# EAGLE schematic foxBMS_BMS-Master_Extension_V1.00 (EAGLE 6.5.0)
AUTHOR: Fraunhofer IISB foxBMS Team; REL-DATE: 2016-05-20; TITLE: foxBMS BMS-Master Extension; VERSION: 1.00

## Sheet 1 of 22: Overview
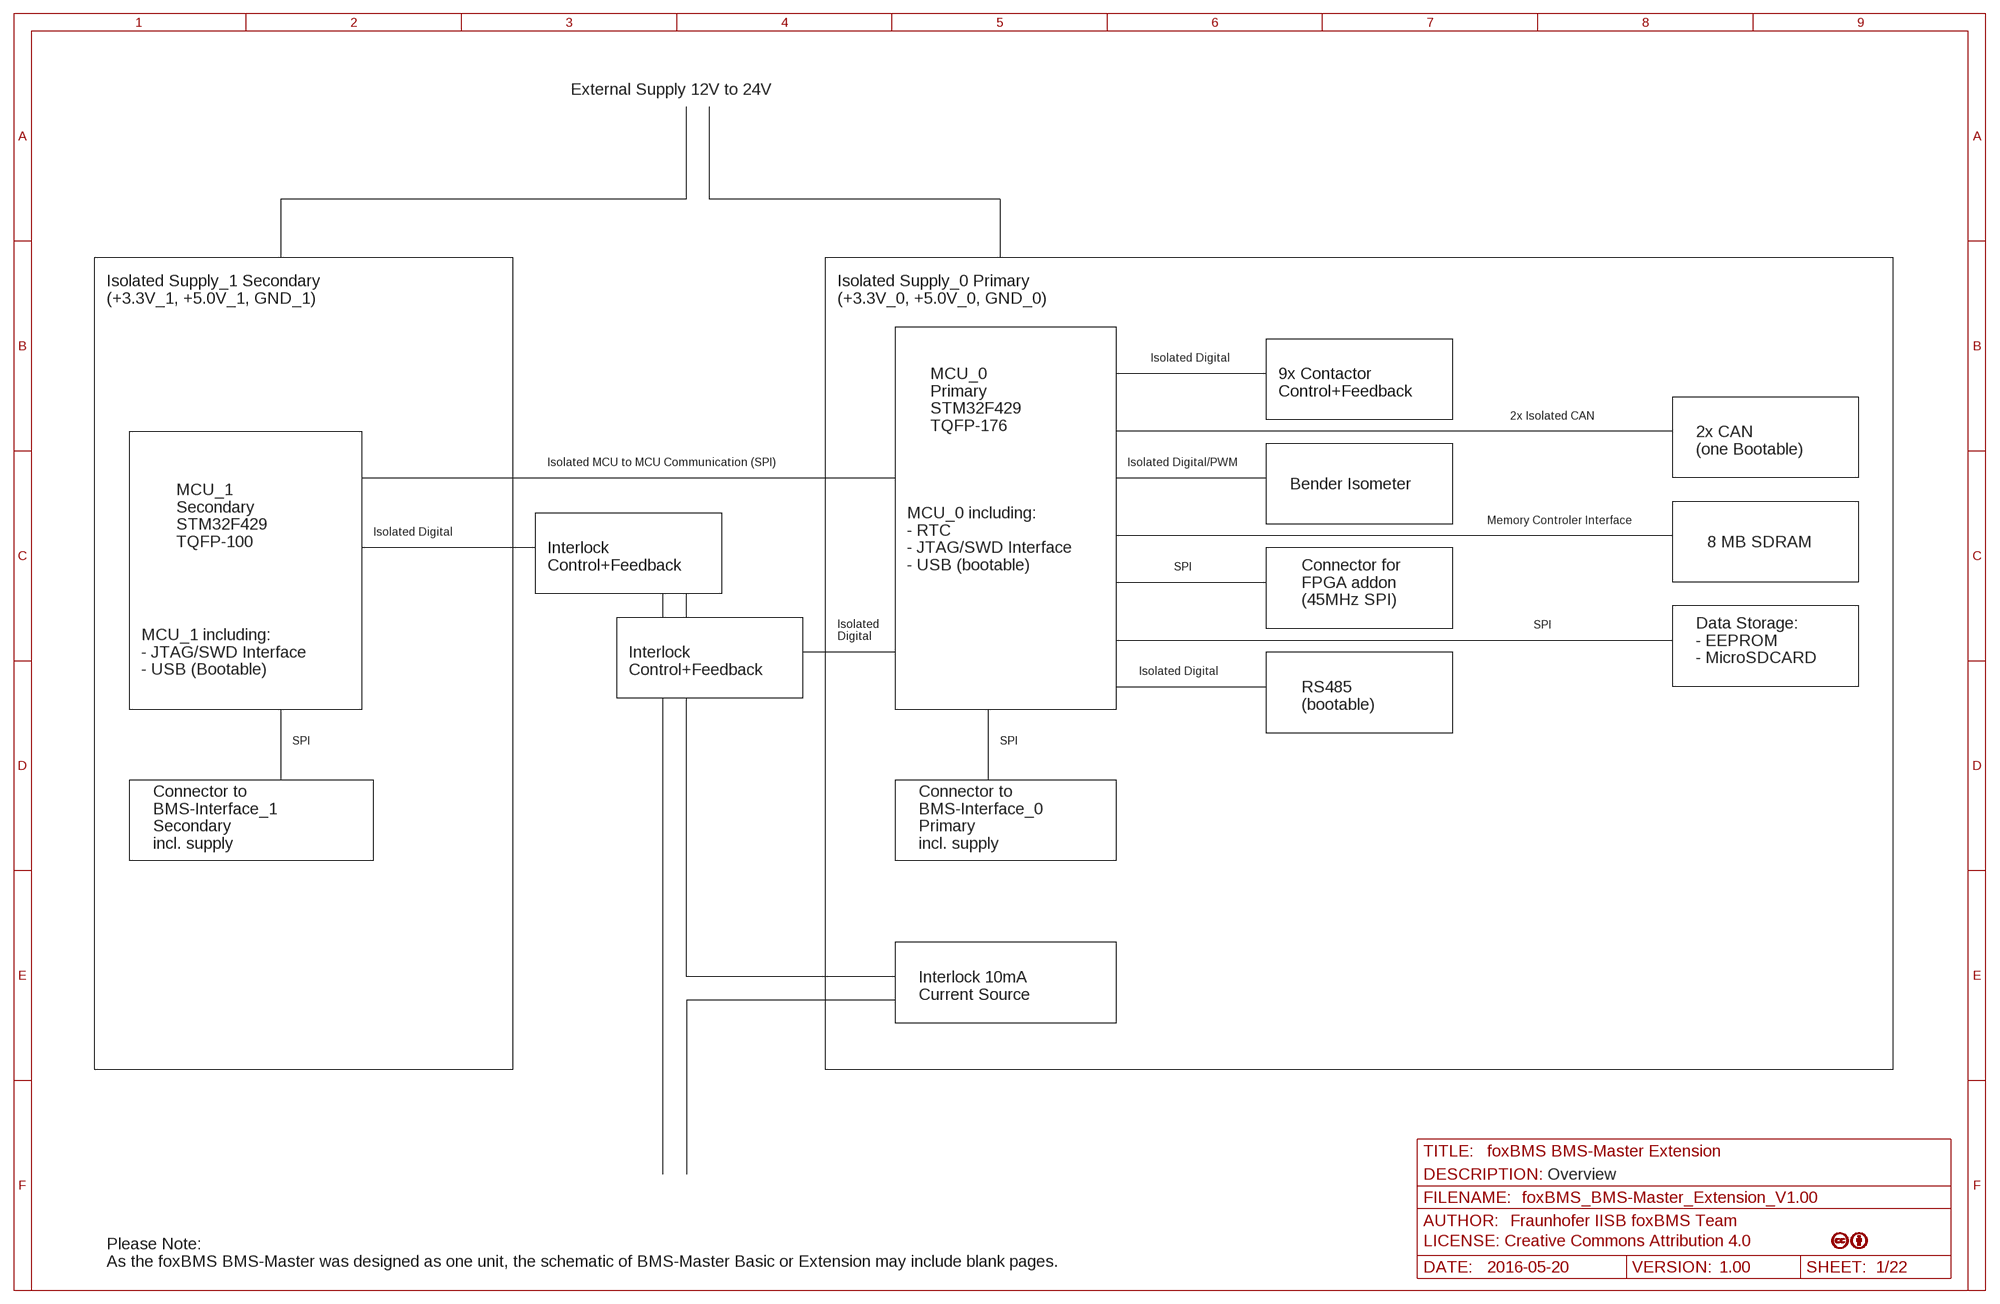
[diagram p0: schematic, sheet 1]

### Notes on the sheet
- External Supply 12V to 24V
- Isolated Supply_1 Secondary
  (+3.3V_1, +5.0V_1, GND_1)
- Isolated Supply_0 Primary
  (+3.3V_0, +5.0V_0, GND_0)
- Isolated Digital
- 9x Contactor
  Control+Feedback
- 2x Isolated CAN
- MCU_0
  Primary
  STM32F429 
  TQFP-176
- 2x CAN
  (one Bootable)
- Isolated MCU to MCU Communication (SPI) | Isolated Digital/PWM
- Bender Isometer
- Memory Controler Interface
- Isolated Digital
- MCU_1
  Secondary
  STM32F429 
  TQFP-100
- 8 MB SDRAM
- Interlock
  Control+Feedback
- MCU_0 including:
  - RTC
  - JTAG/SWD Interface
  - USB (bootable)
- SPI
- Connector for 
  FPGA addon
  (45MHz SPI)
- SPI
- Isolated 
  Digital
- Data Storage:
  - EEPROM
  - MicroSDCARD
- MCU_1 including:
  - JTAG/SWD Interface
  - USB (Bootable)
- Interlock
  Control+Feedback
- Isolated Digital
- RS485
  (bootable)
- SPI | SPI
- Connector to 
  BMS-Interface_1 
  Secondary
  incl. supply
- Connector to 
  BMS-Interface_0
  Primary
  incl. supply
- Interlock 10mA
  Current Source
- Overview
- Please Note: 
  As the foxBMS BMS-Master was designed as one unit, the schematic of BMS-Master Basic or Extension may include blank pages.

## Sheet 2 of 22: Supply_0 (Primary)
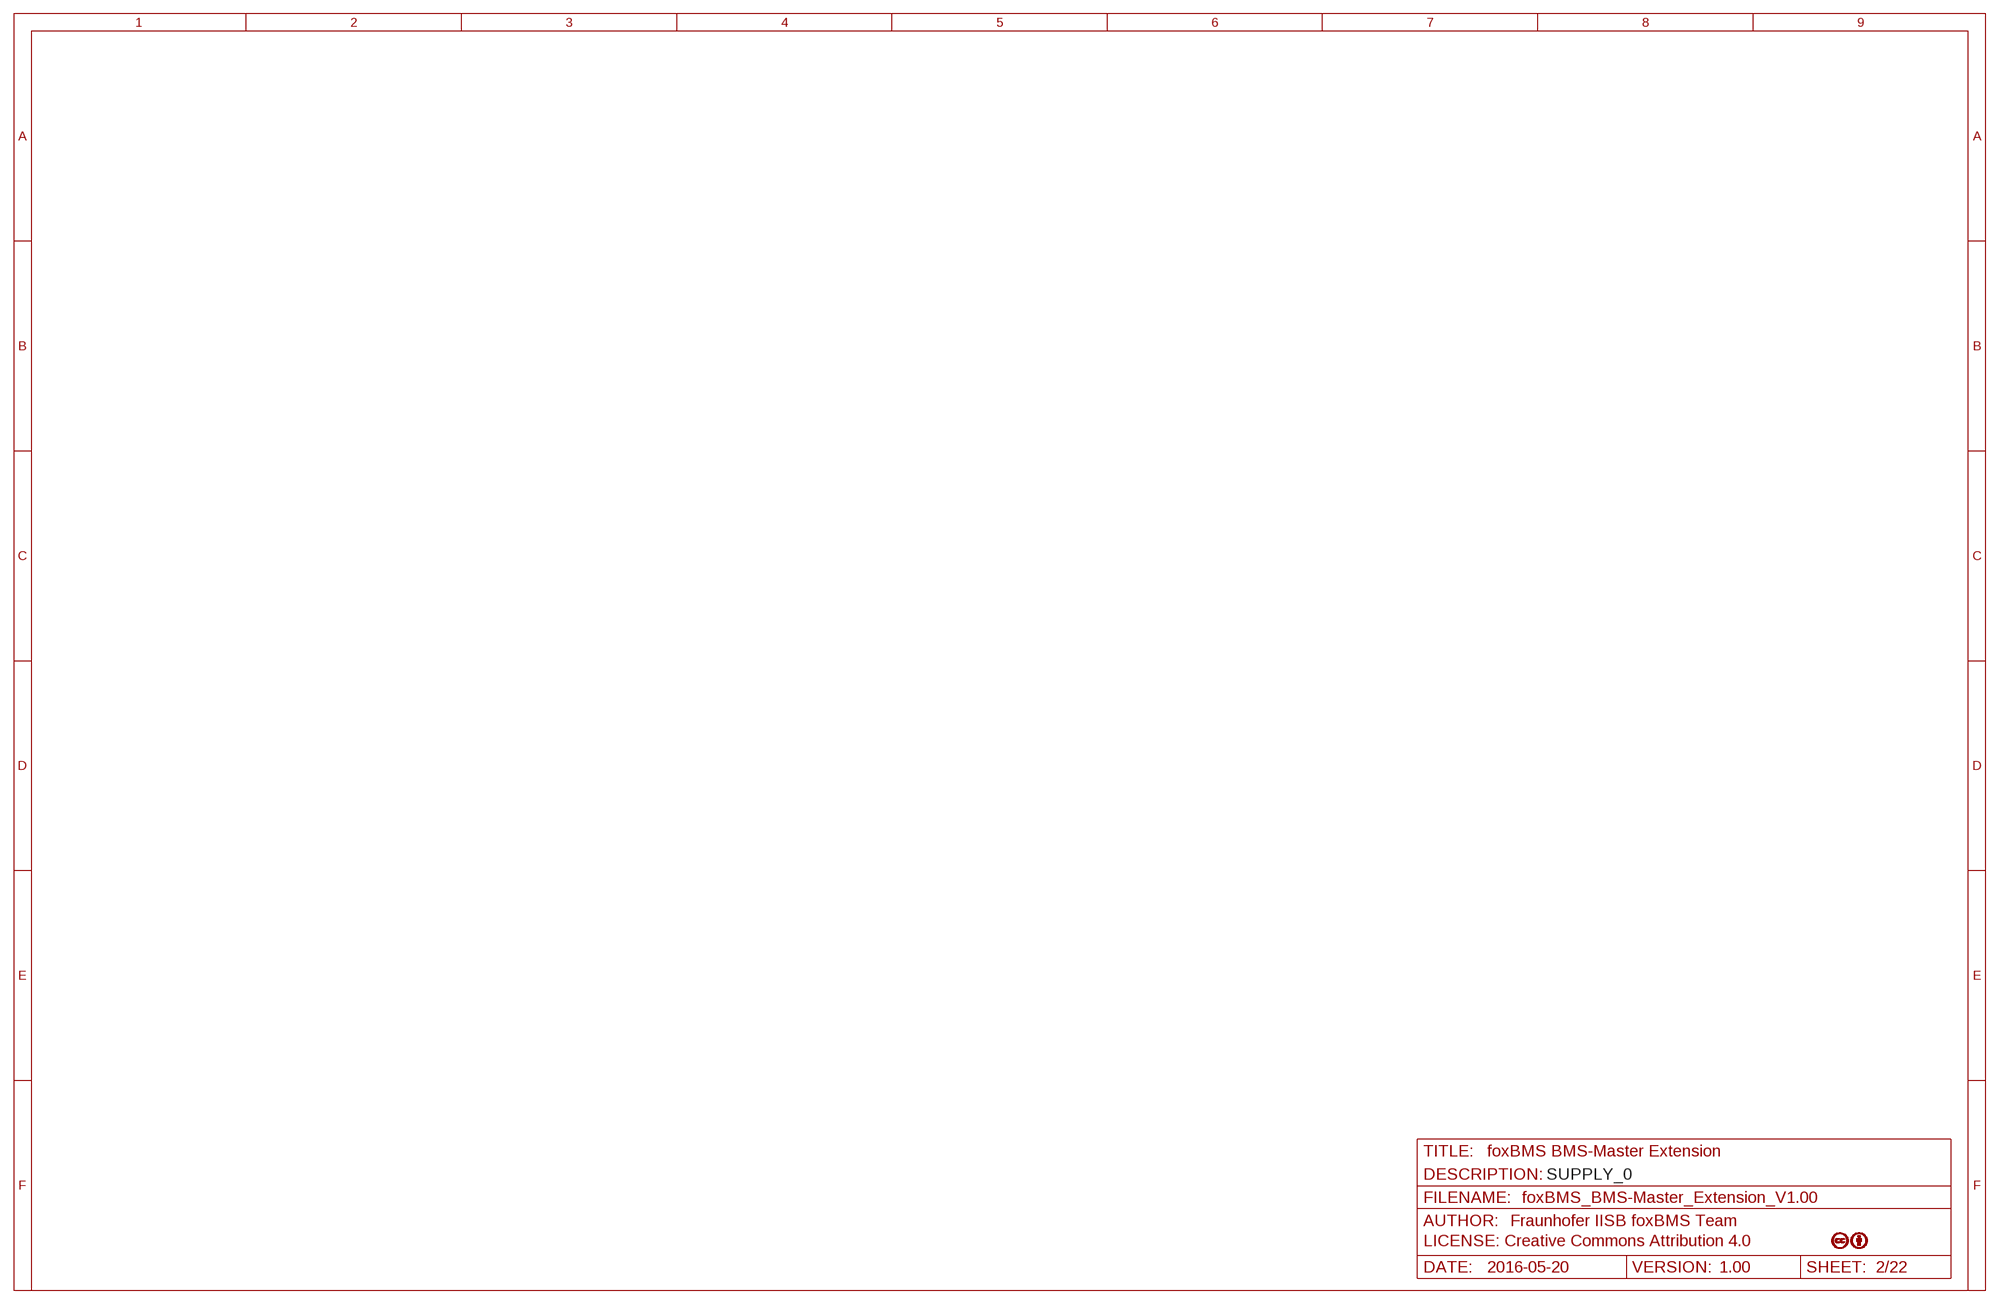
[diagram p1: schematic, sheet 2]

### Notes on the sheet
- SUPPLY_0

## Sheet 3 of 22: Supply_1 (Secondary)
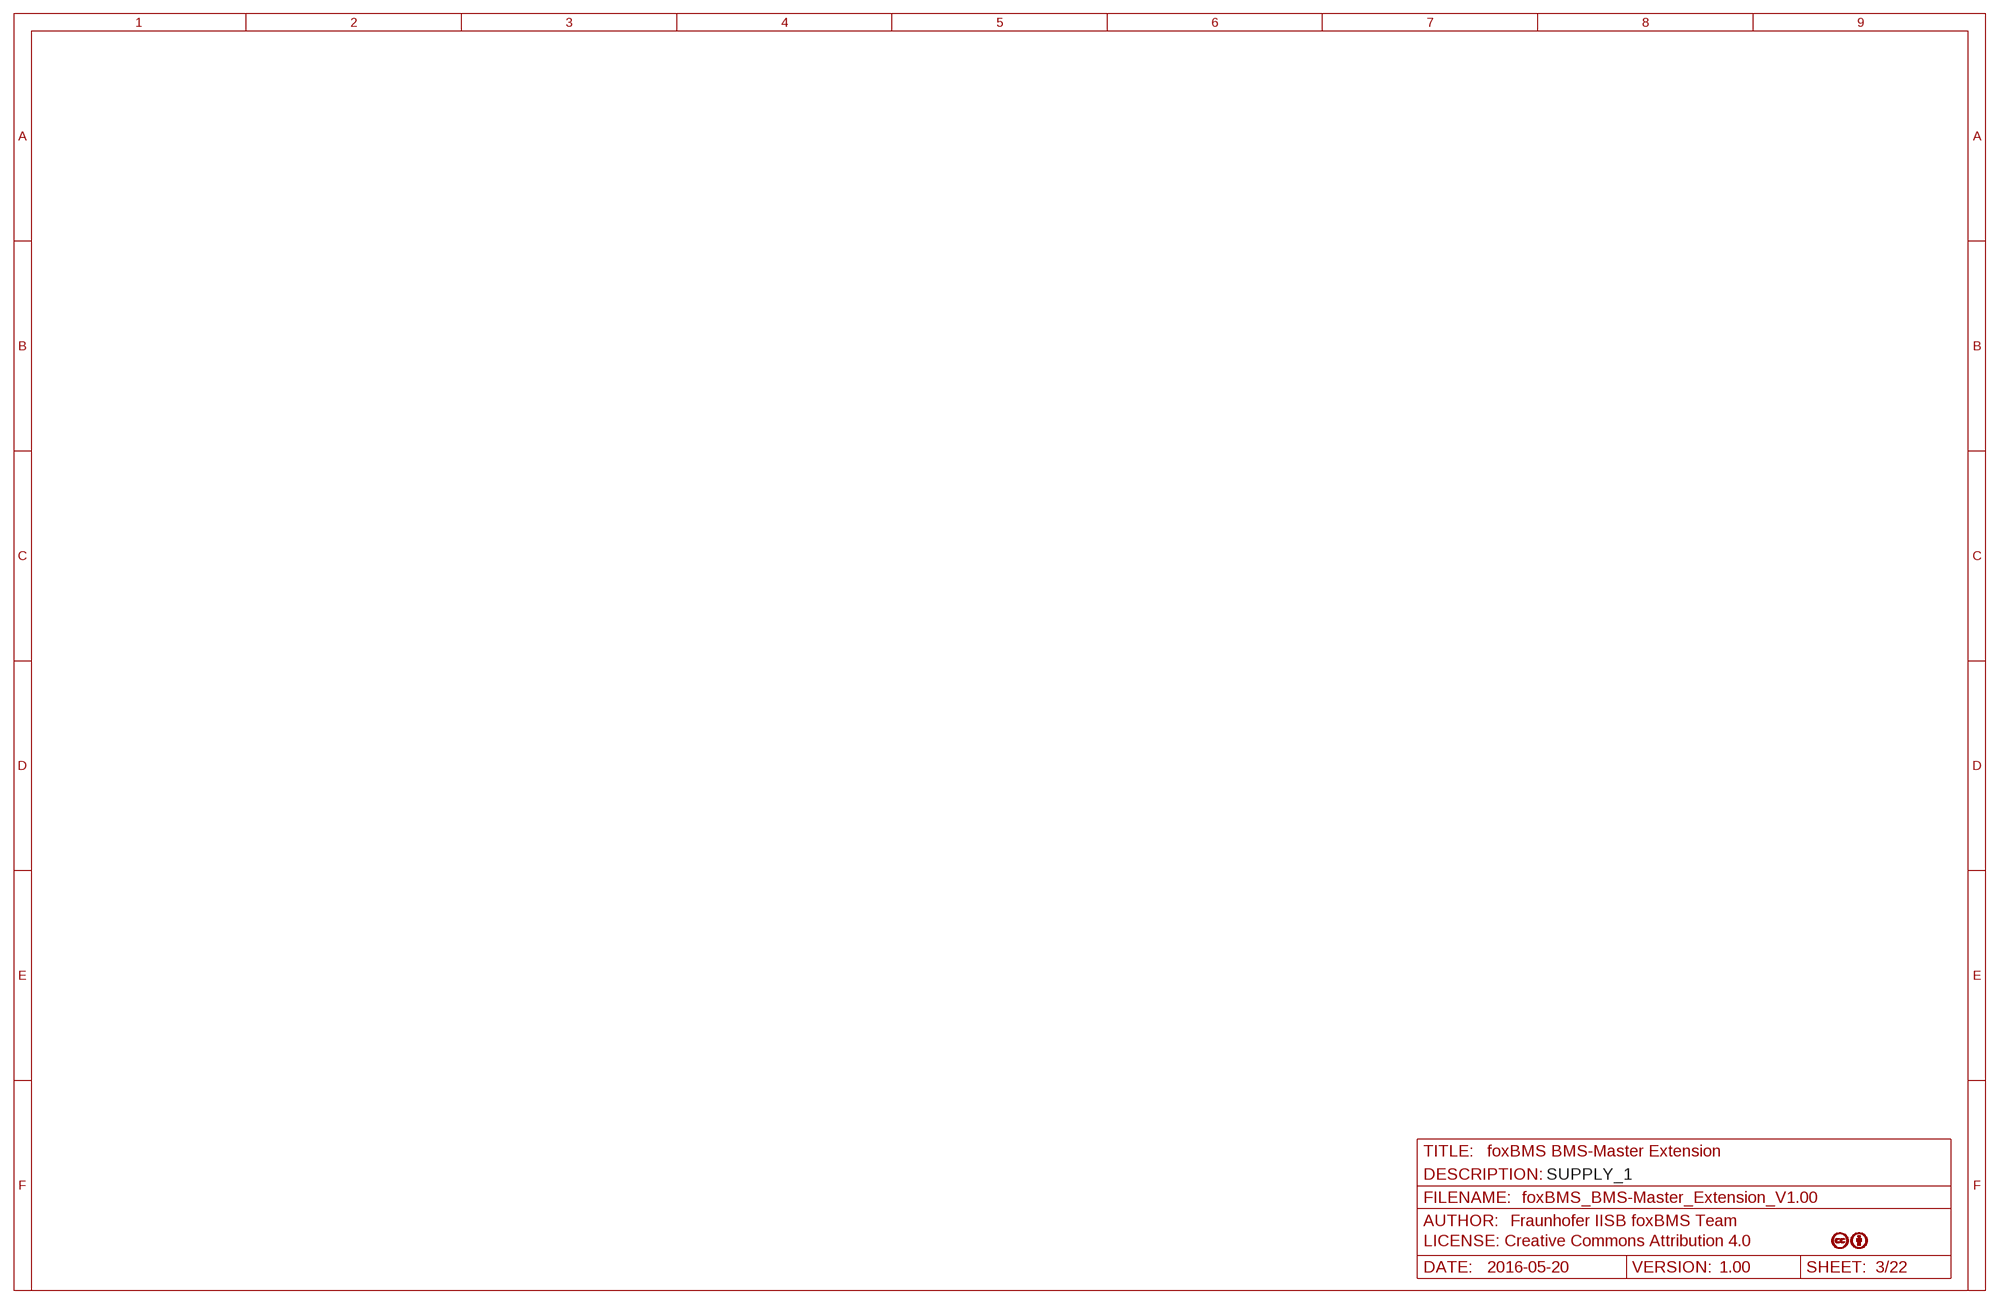
[diagram p2: schematic, sheet 3]

### Notes on the sheet
- SUPPLY_1

## Sheet 4 of 22: MCU_0 (Primary)
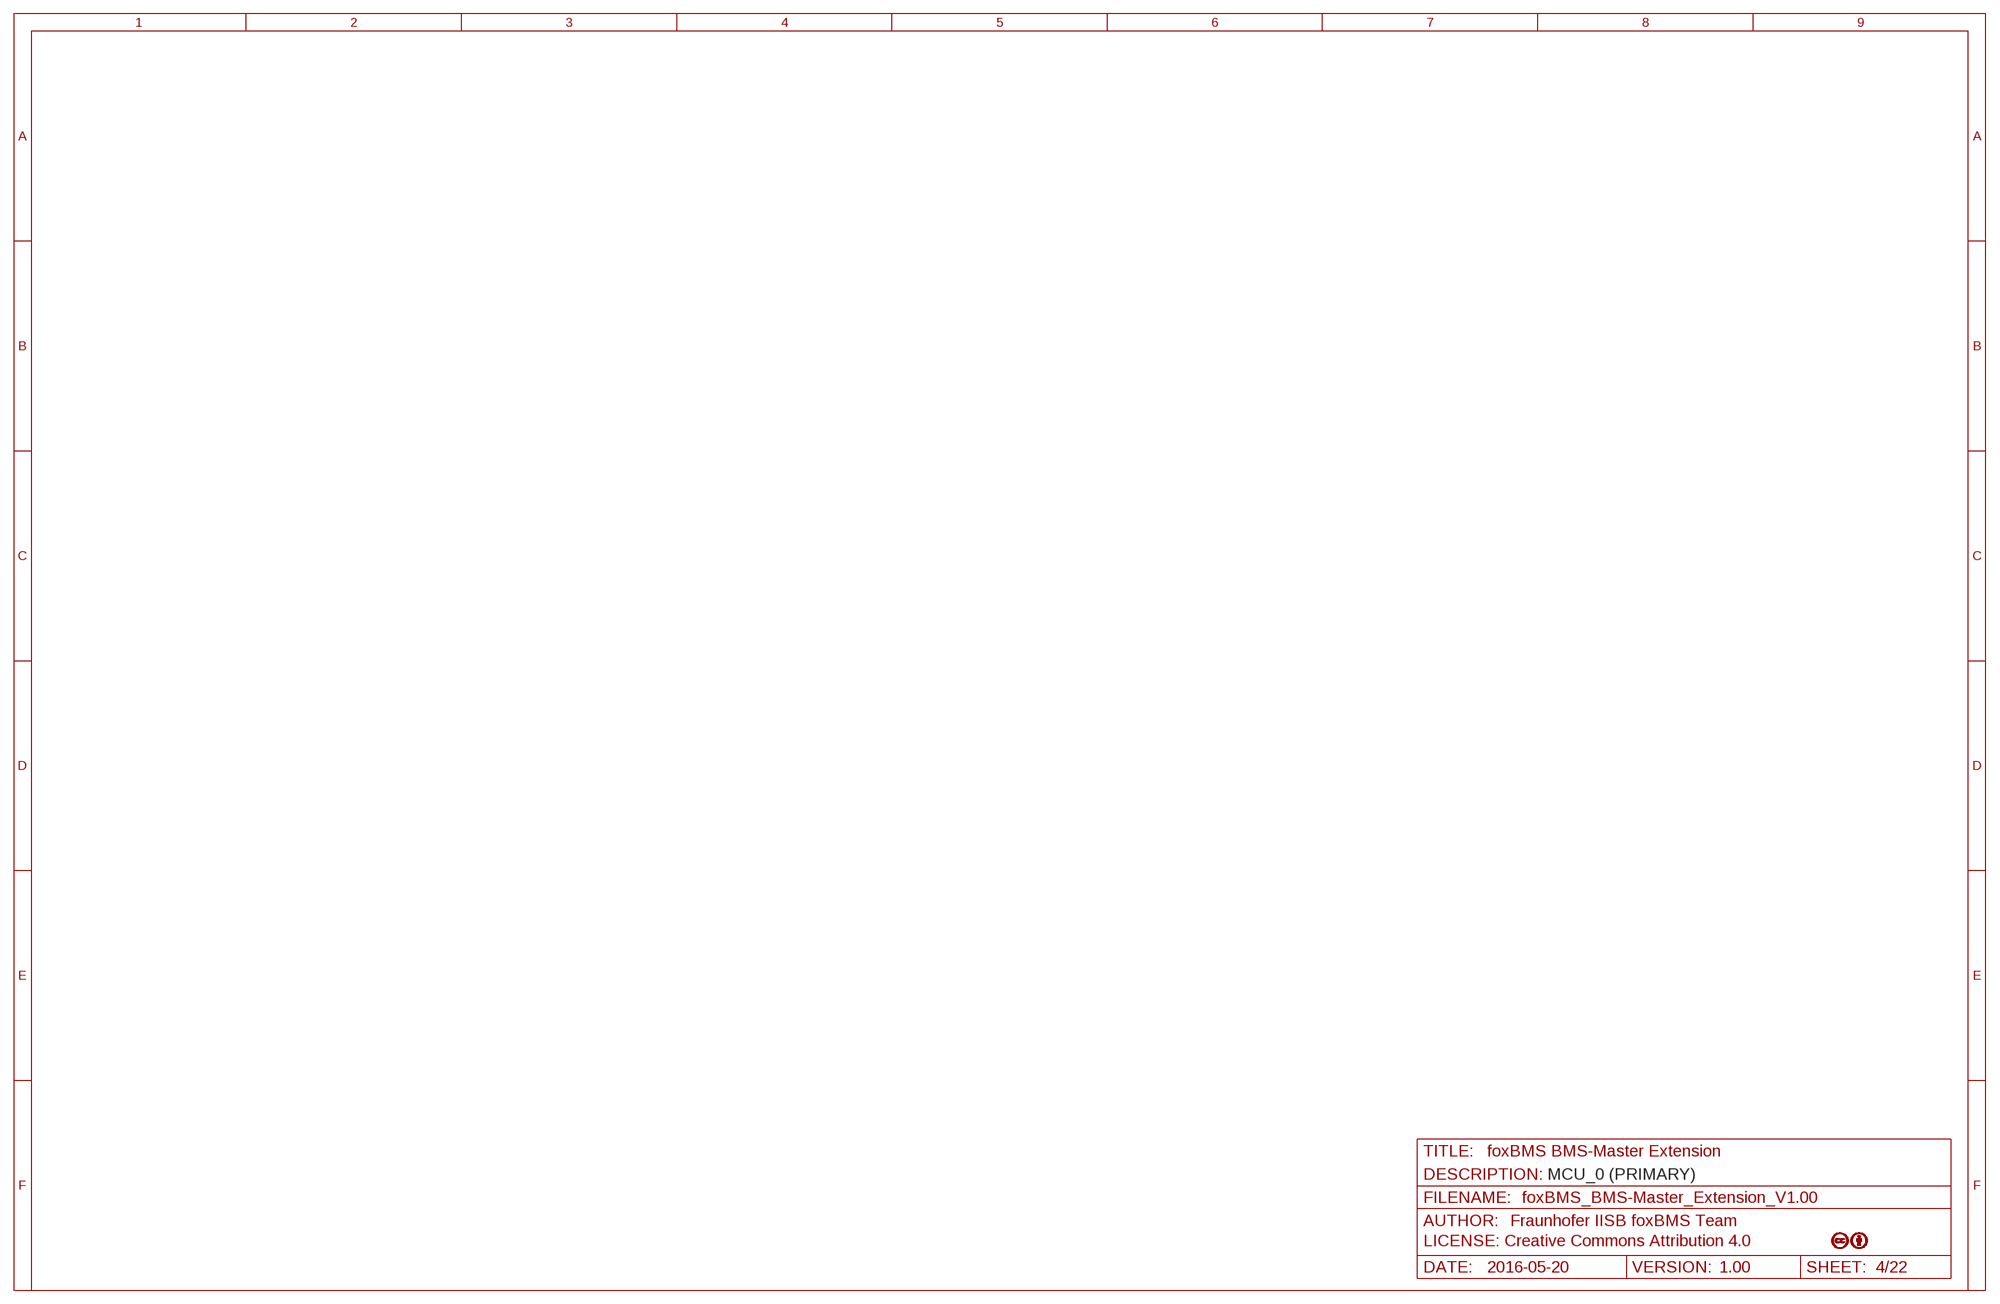
[diagram p3: schematic, sheet 4]

### Notes on the sheet
- MCU_0 (PRIMARY)

## Sheet 5 of 22: MCU_1 (Secondary)
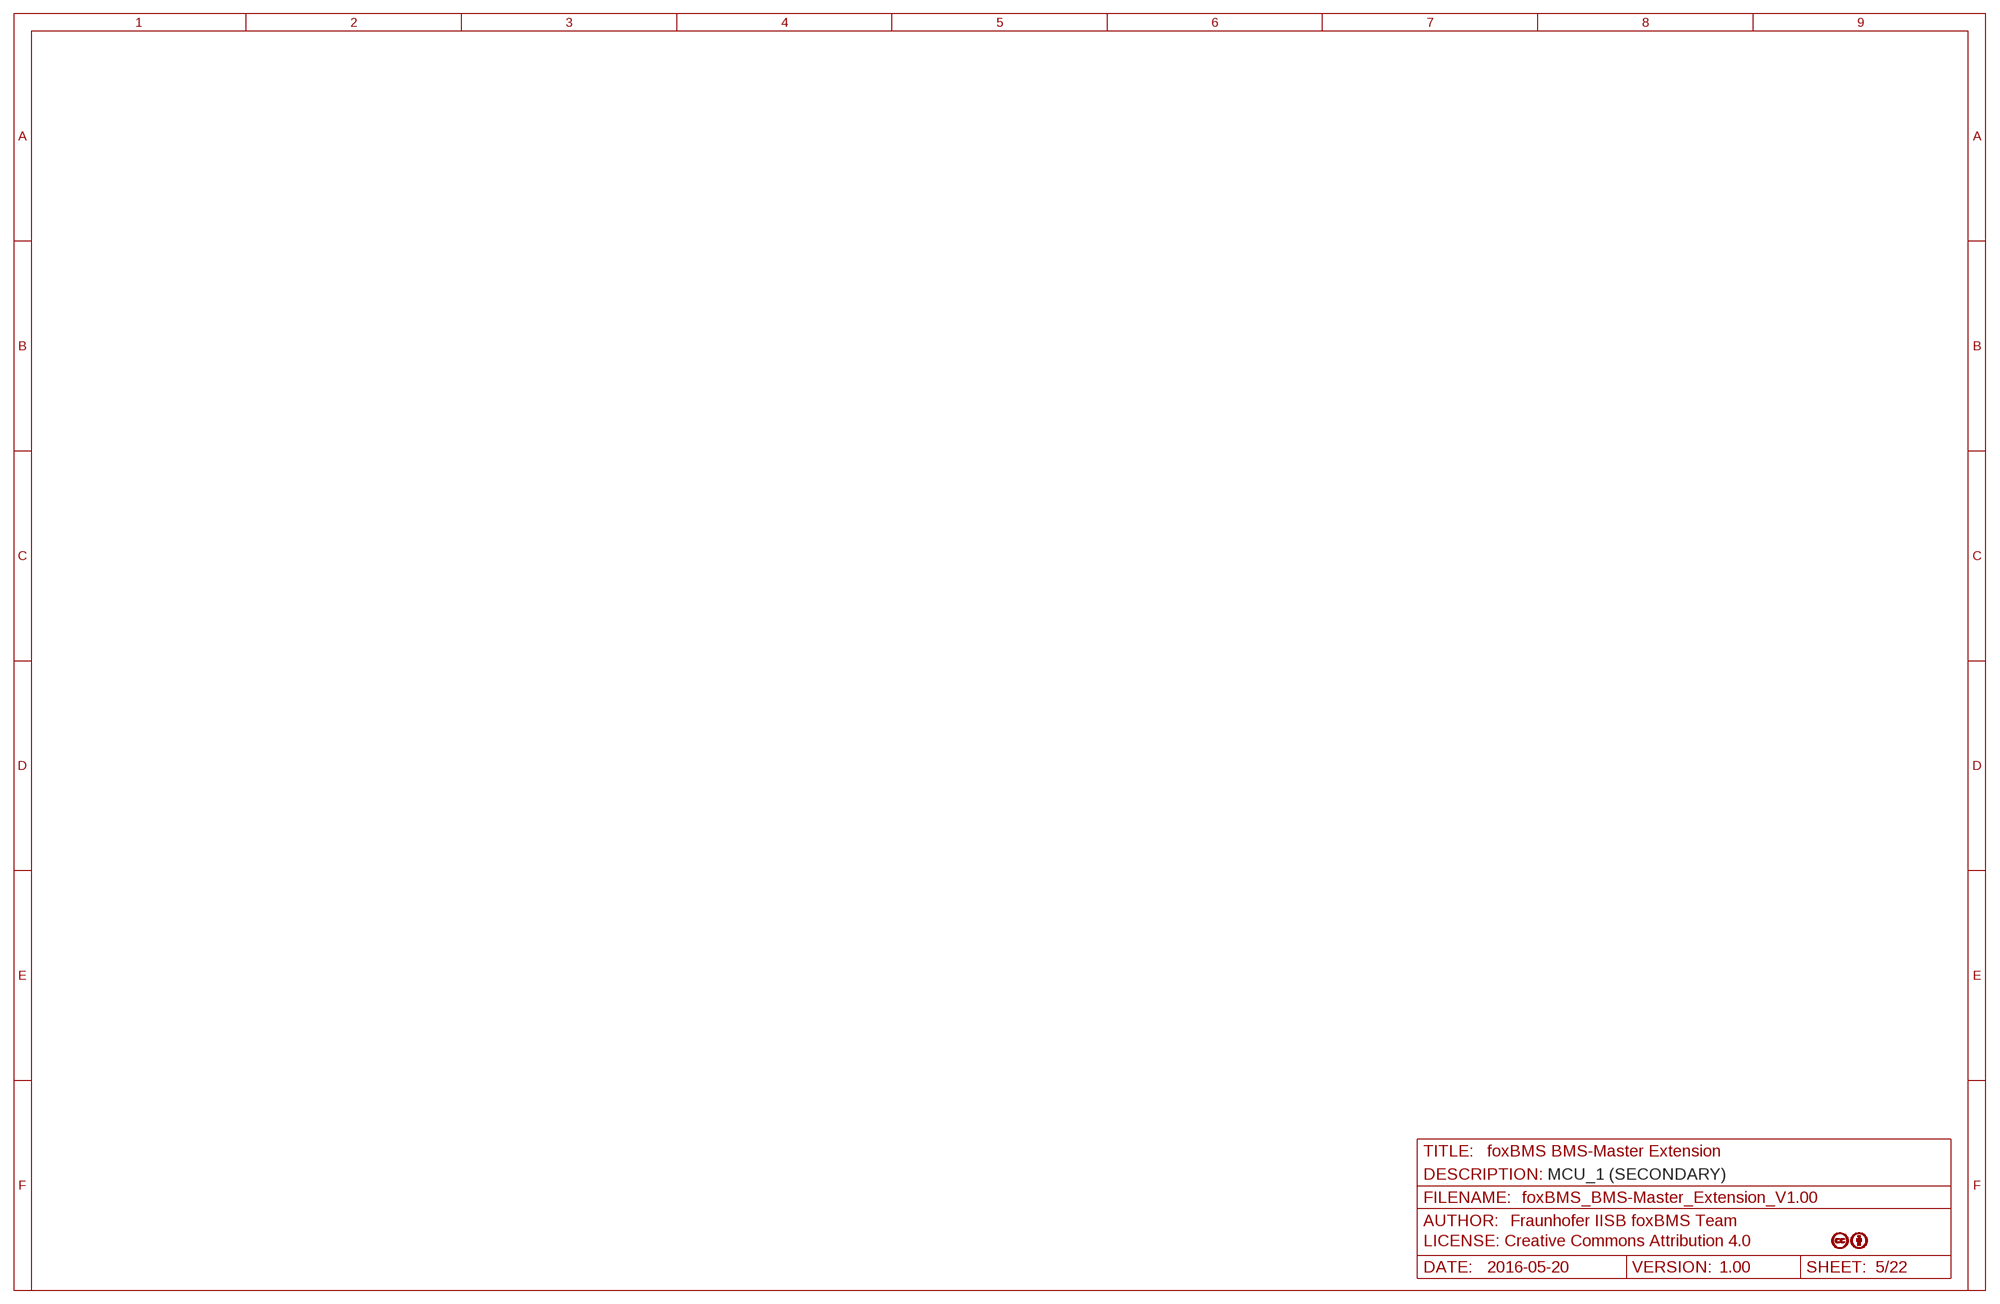
[diagram p4: schematic, sheet 5]

### Notes on the sheet
- MCU_1 (SECONDARY)

## Sheet 6 of 22: MCU to MCU Interface
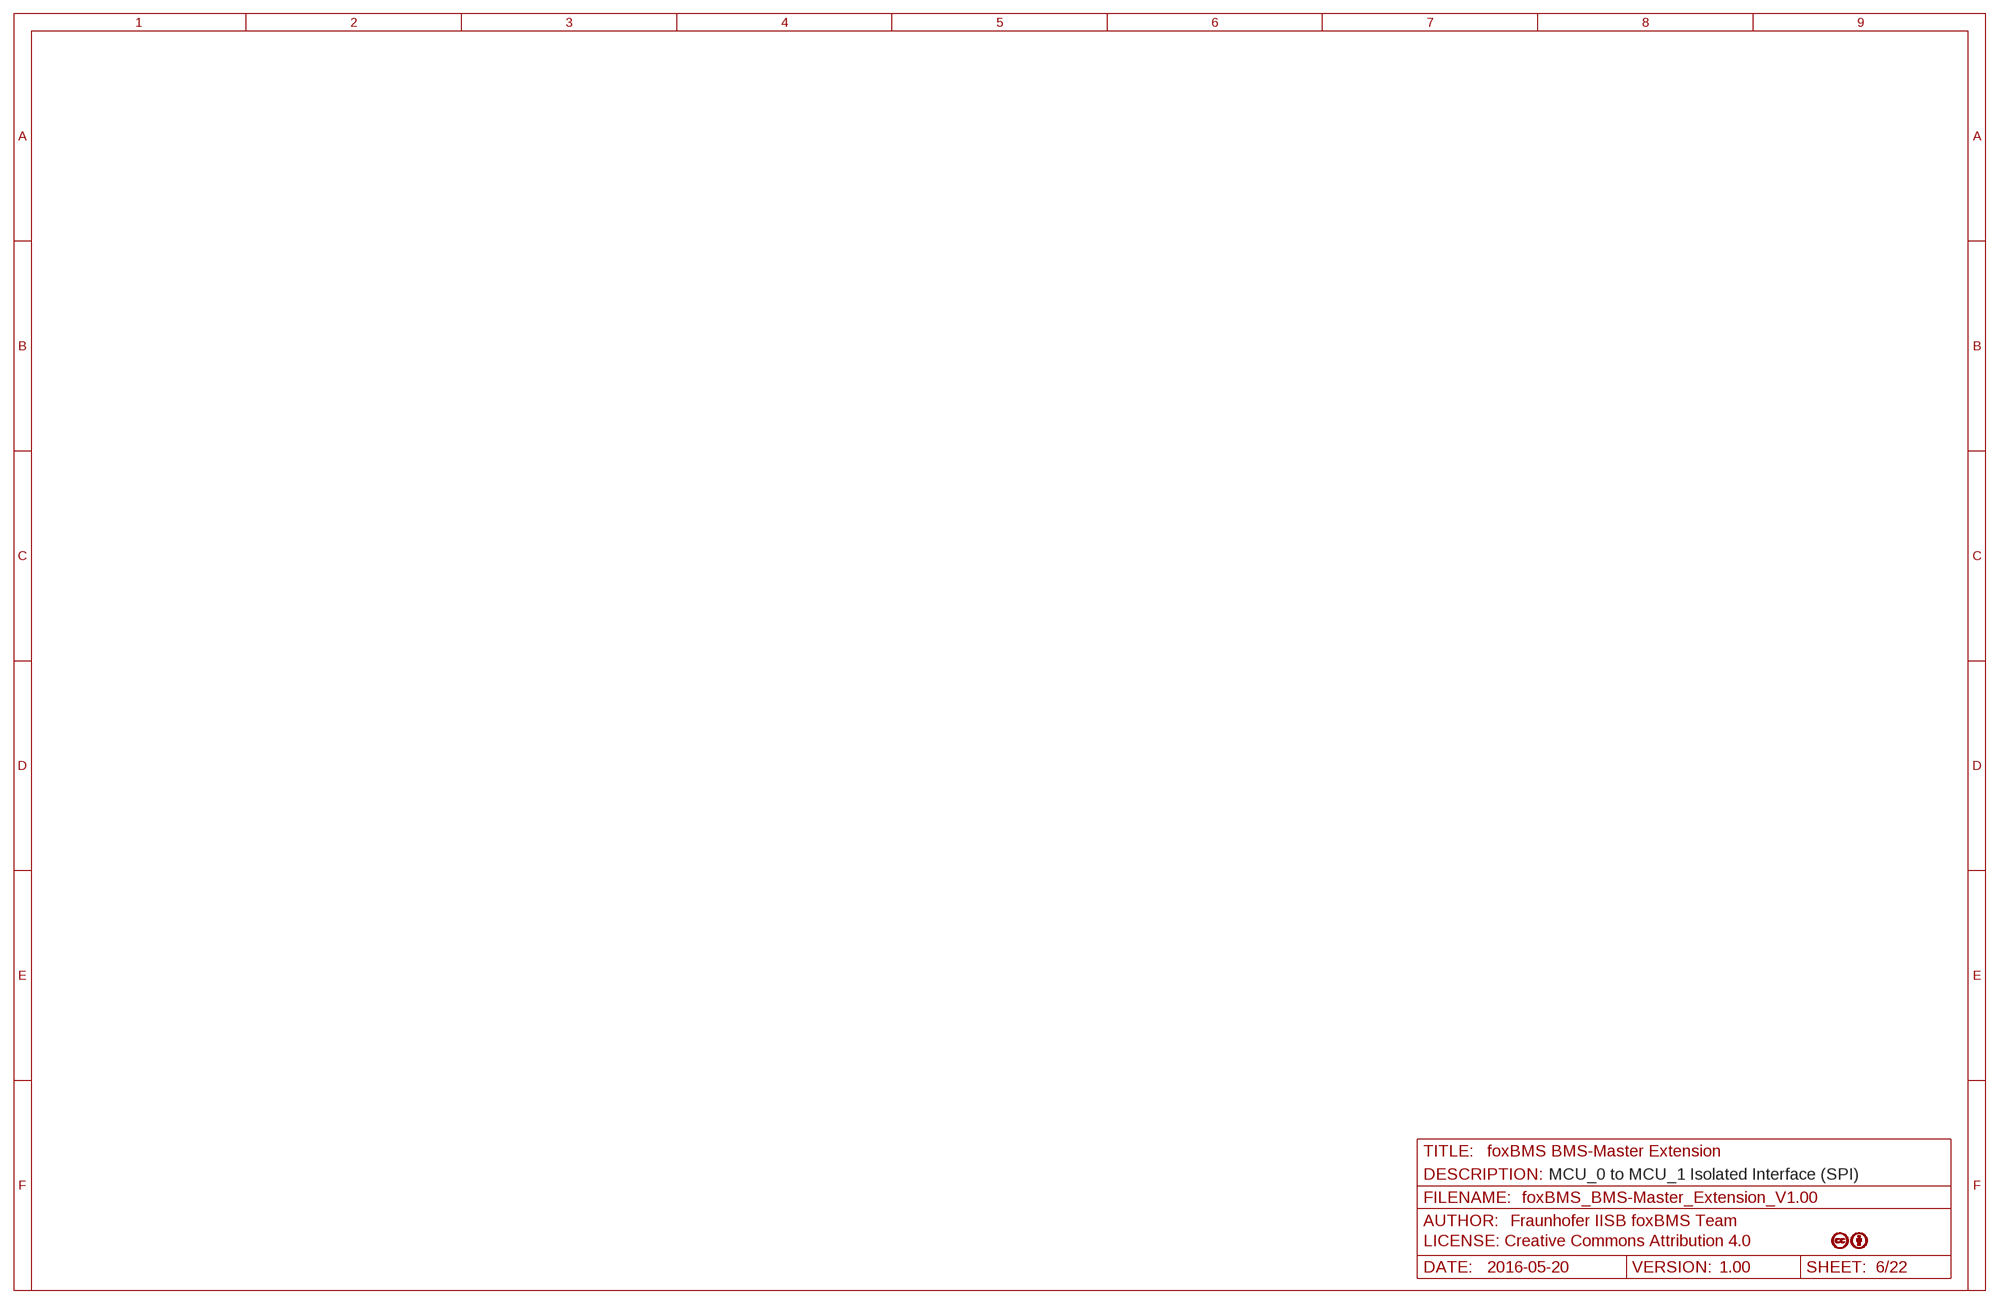
[diagram p5: schematic, sheet 6]

### Notes on the sheet
- MCU_0 to MCU_1 Isolated Interface (SPI)

## Sheet 7 of 22: Bender Interface
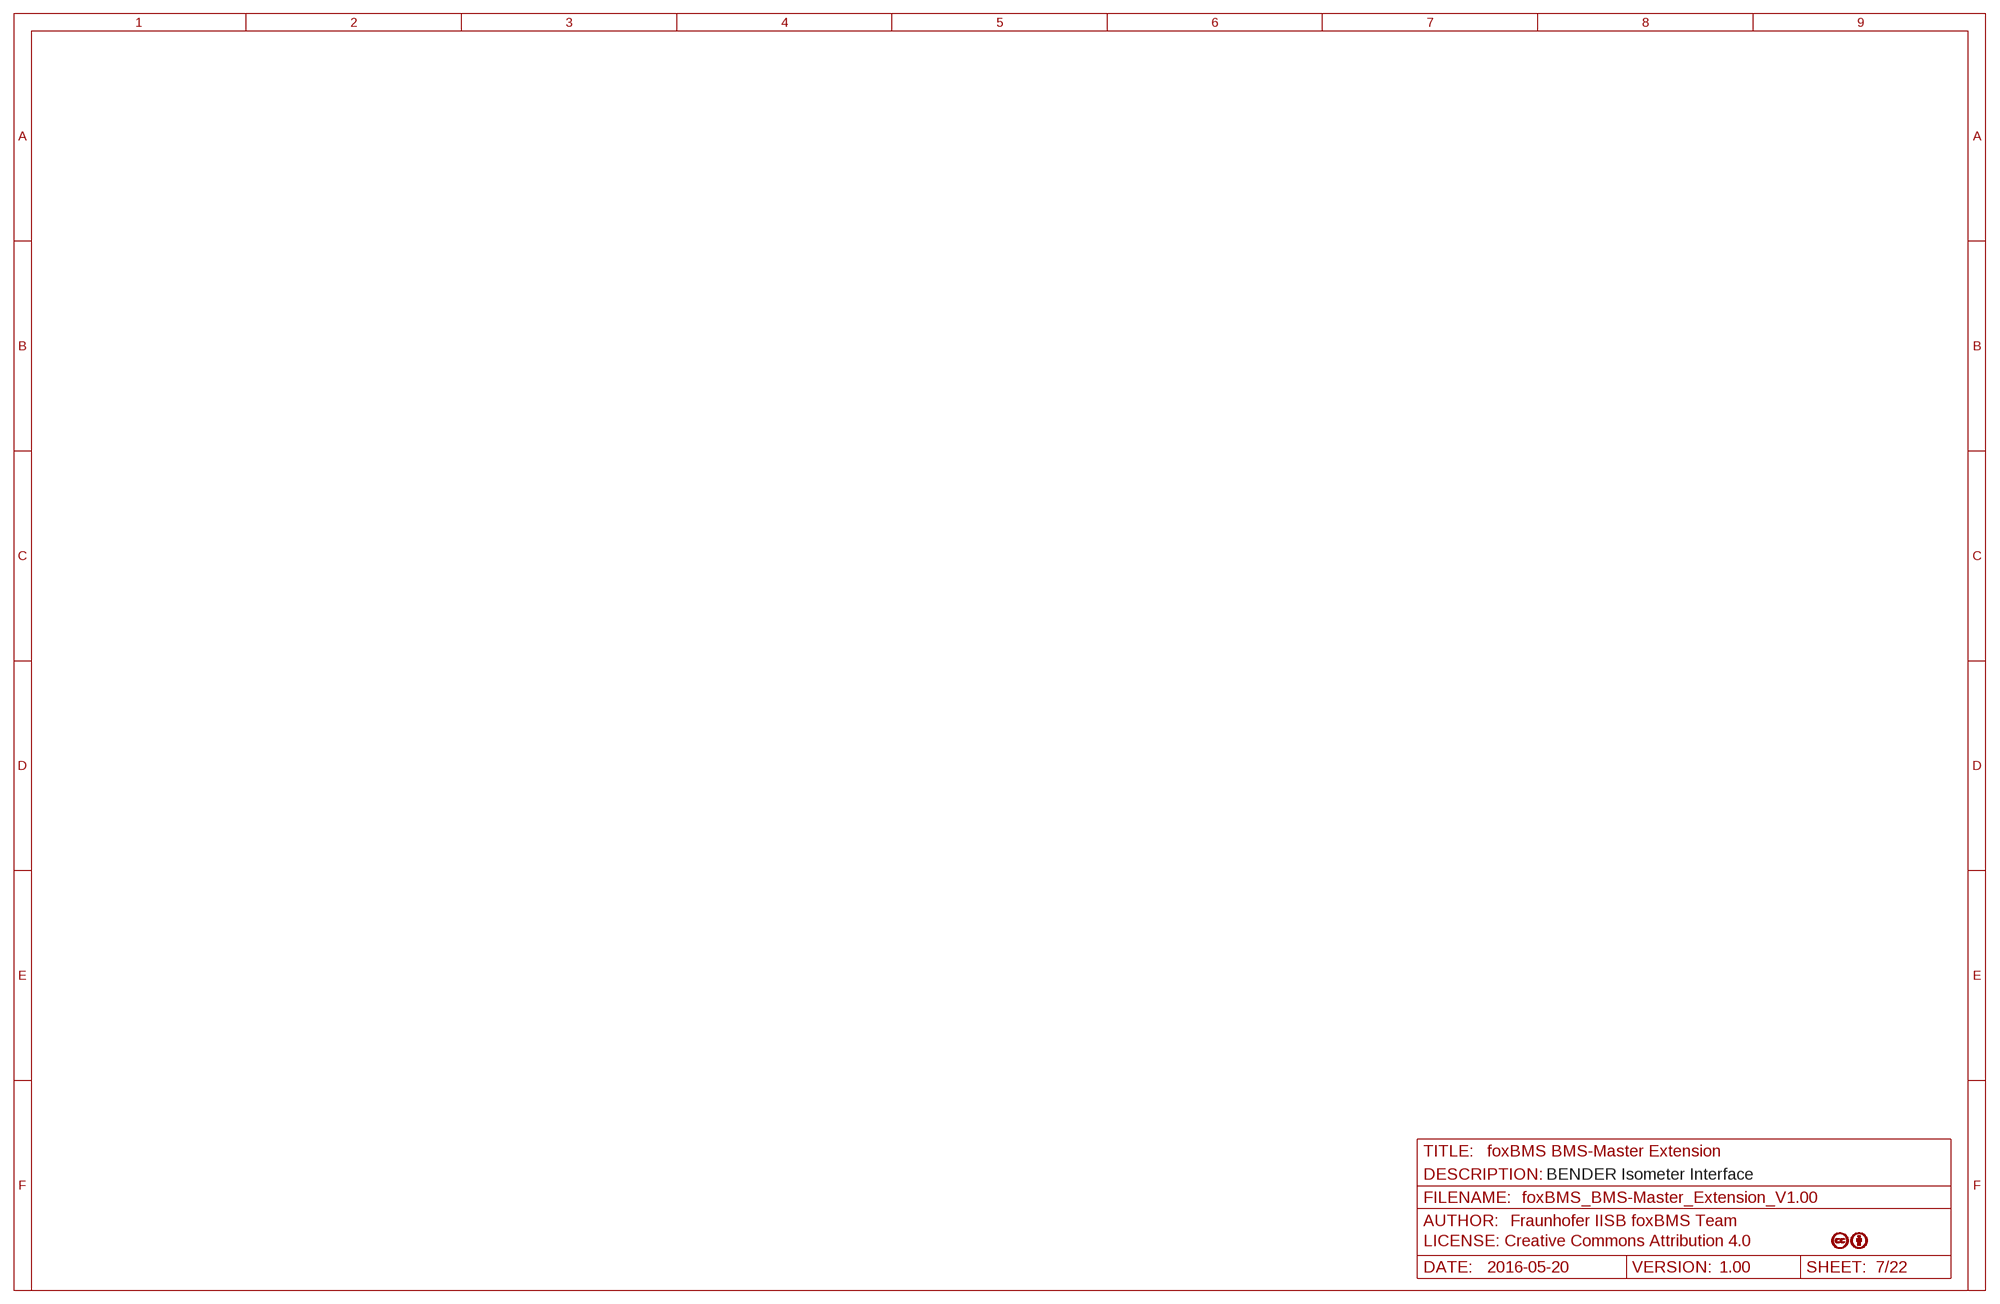
[diagram p6: schematic, sheet 7]

### Notes on the sheet
- BENDER Isometer Interface

## Sheet 8 of 22: CAN Interfaces
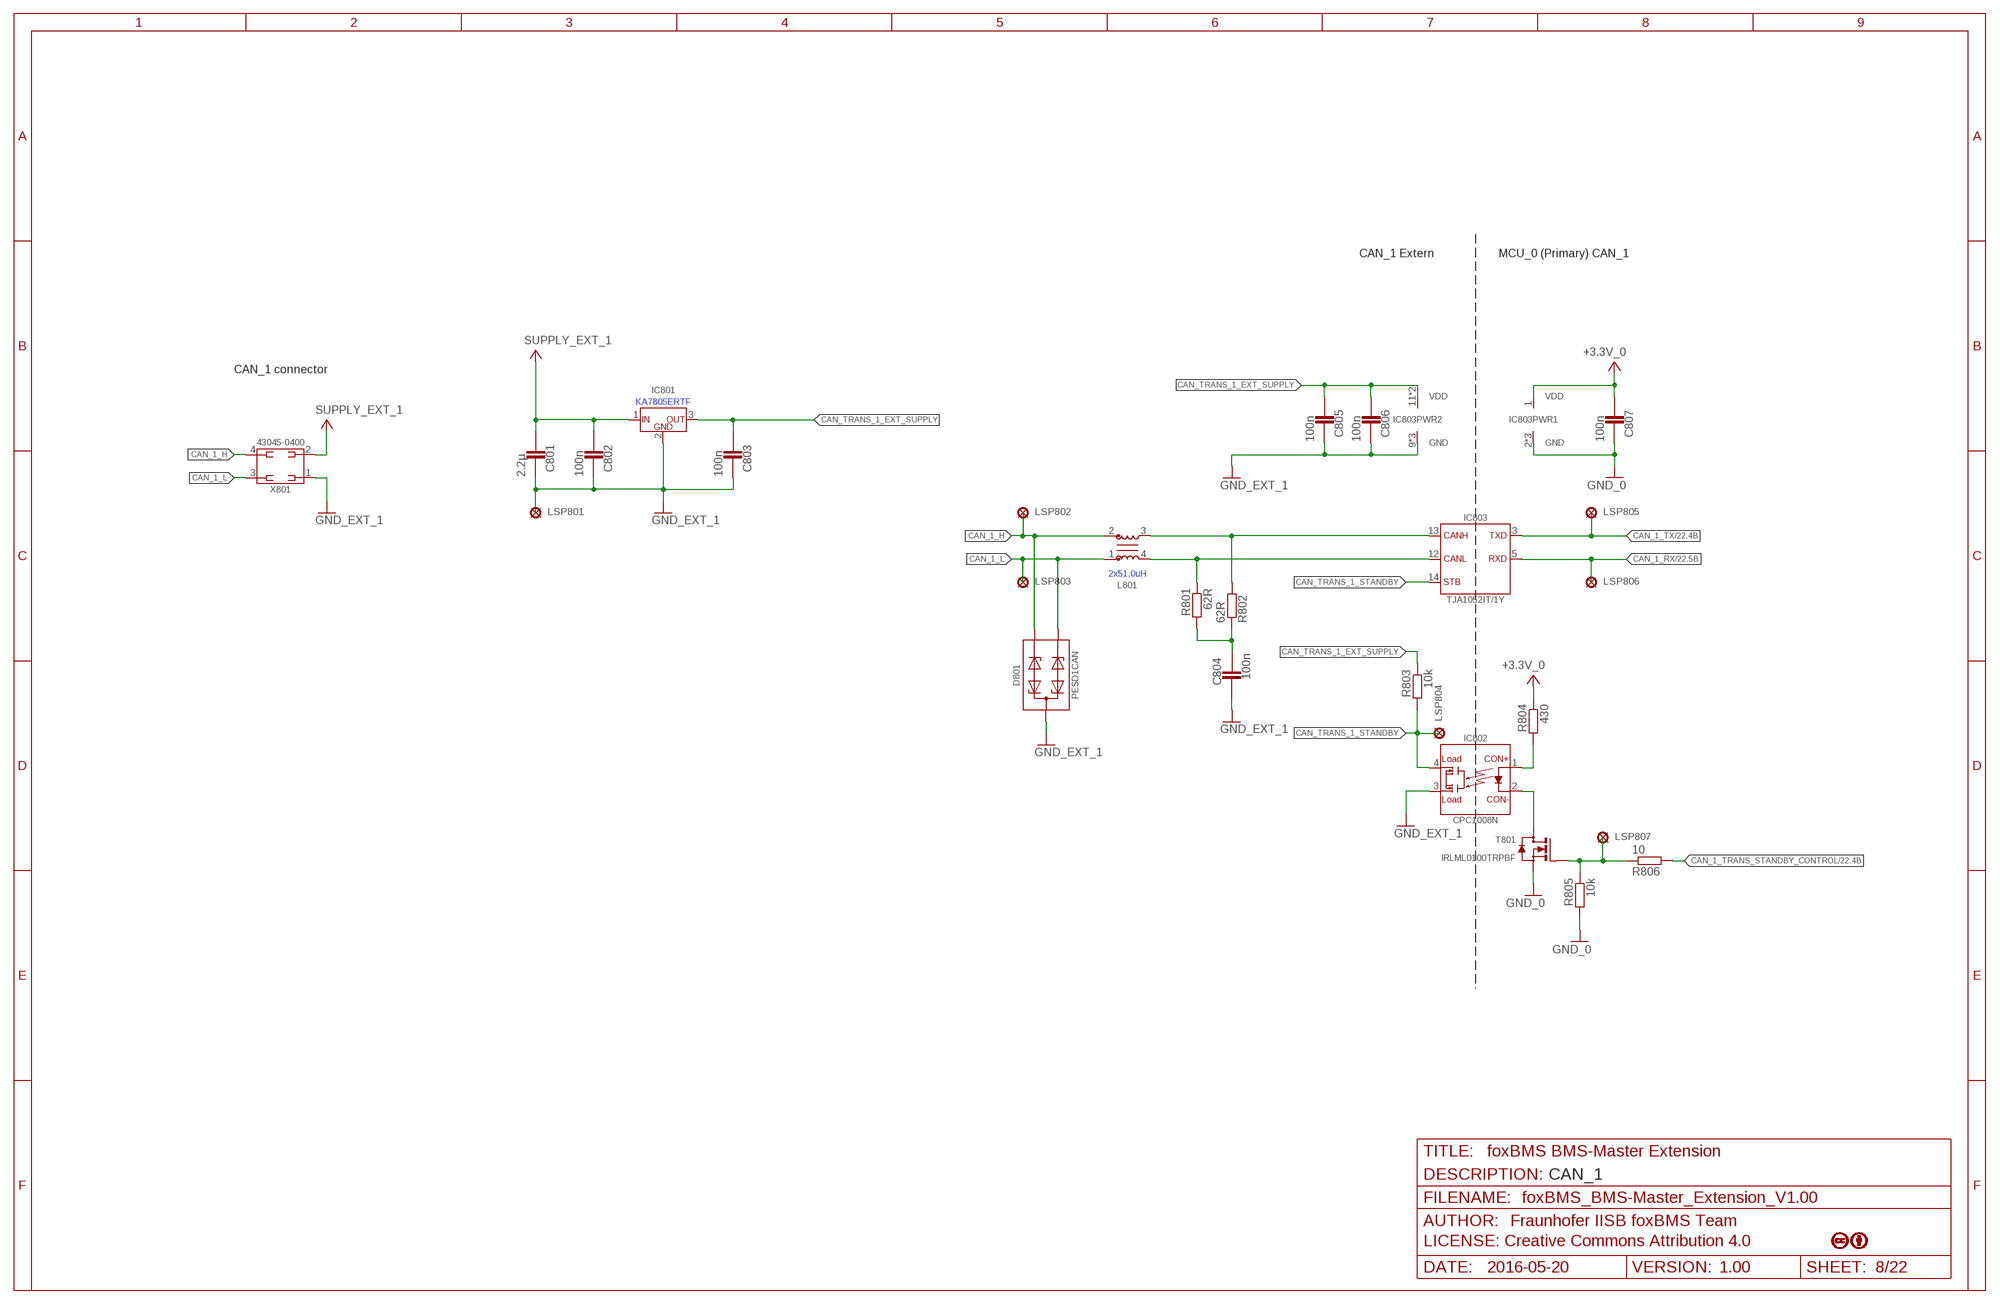
[diagram p7: schematic, sheet 8]

### Parts
C801  2.2µ  C_X7R_0603  [0603]
C802  100n  C_X7R_0603  [0603]
C803  100n  C_X7R_0603  [0603]
C804  100n  C_X7R_0603  [0603]
C805  100n  C_X7R_0603  [0603]
C806  100n  C_X7R_0603  [0603]
C807  100n  C_X7R_0603  [0603]
D801  PESD1CAN  [D_SMD_SOT23_(TO-236AB)_R_NXP_REV01]
IC801  KA7805ERTF  [IC_SMD_TO-252_(D-PAK)_R_FAIRCHILD_REV01]
IC802  CPC1008N  [K_SMD_SOP-4_R_IXYS_REV01]
IC803  TJA1052IT/1Y  [IC_SMD_SO16_(SOT162-1)_R_NXP_REV01]
L801  B82789C0513N002  [L_SMD_FILTER_HF_R_EPCOS_SIMDAD_1812_REV01]
LSP801  PAD_2.0X1.5MM  [PAD2.0X1.5MM]
LSP802  PAD_2.0X1.5MM  [PAD2.0X1.5MM]
LSP803  PAD_2.0X1.5MM  [PAD2.0X1.5MM]
LSP804  PAD_2.0X1.5MM  [PAD2.0X1.5MM]
LSP805  PAD_2.0X1.5MM  [PAD2.0X1.5MM]
LSP806  PAD_2.0X1.5MM  [PAD2.0X1.5MM]
LSP807  PAD_2.0X1.5MM  [PAD2.0X1.5MM]
R801  62R  R_CARB_0603  [0603]
R802  62R  R_CARB_0603  [0603]
R803  10k  R_CARB_0603  [0603]
R804  430  R_CARB_0603  [0603]
R805  10k  R_CARB_0603  [0603]
R806  10  R_CARB_0603  [0603]
T801  IRLML0100TRPBF  [V_SMD_SOT-23_(TO-236AB)_R_IR_REV01]
X801  43045-0400_MOLEX_4PIN  [X_TH_MOLEX_43045-0400_R_REV01]

### Nets
+3.3V_0: C807.2 IC803.1(VDD) R804.1 ; also sheet 10,11,13,15,17,19,20,21,22
CAN_1_H: D801.1 L801.2 LSP802.P$1(MP) X801.4
CAN_1_L: D801.2 L801.1 LSP803.P$1(MP) X801.3
CAN_1_RX: IC803.5(RXD) LSP806.P$1(MP) ; also sheet 22
CAN_1_TRANS_STANDBY_CONTROL: R806.2 ; also sheet 22
CAN_1_TX: IC803.3(TXD) LSP805.P$1(MP) ; also sheet 22
CAN_L_INT1: IC803.12(CANL) L801.4 R801.1
CAN_SPLIT1: C804.1 R801.2 R802.1
CAN_TRANS_1_EXT_SUPPLY: C803.2 C805.2 C806.2 IC801.3(OUT) IC803.11(VDD) IC803.16(VDD) R803.1
CAN_TRANS_1_STANDBY: IC802.4 IC803.14(STB) LSP804.P$1(MP) R803.2
GND_0: C807.1 IC803.2(GND) IC803.7(GND) IC803.8(GND) R805.2 T801.2(S) ; also sheet 10,11,13,15,17,19,20,21,22
GND_EXT_1 [Power]: C801.1 C802.1 C803.1 C804.2 C805.1 C806.1 D801.3 IC801.2(GND) IC802.3 IC803.9(GND) IC803.10(GND) IC803.15(GND) LSP801.P$1(MP) X801.1
N$246: IC803.13(CANH) L801.3 R802.2
N$286: IC802.2(CON-) T801.3(D)
N$287: IC802.1(CON+) R804.2
N$288: LSP807.P$1(MP) R805.1 R806.1 T801.1(G)
SUPPLY_EXT_1: C801.2 C802.2 IC801.1(IN) X801.2
Unconnected: IC803.4(NC) IC803.6(NC)

### Notes on the sheet
- CAN_1 Extern | MCU_0 (Primary) CAN_1
- CAN_1 connector
- CAN_1

## Sheet 9 of 22: Interlock Line
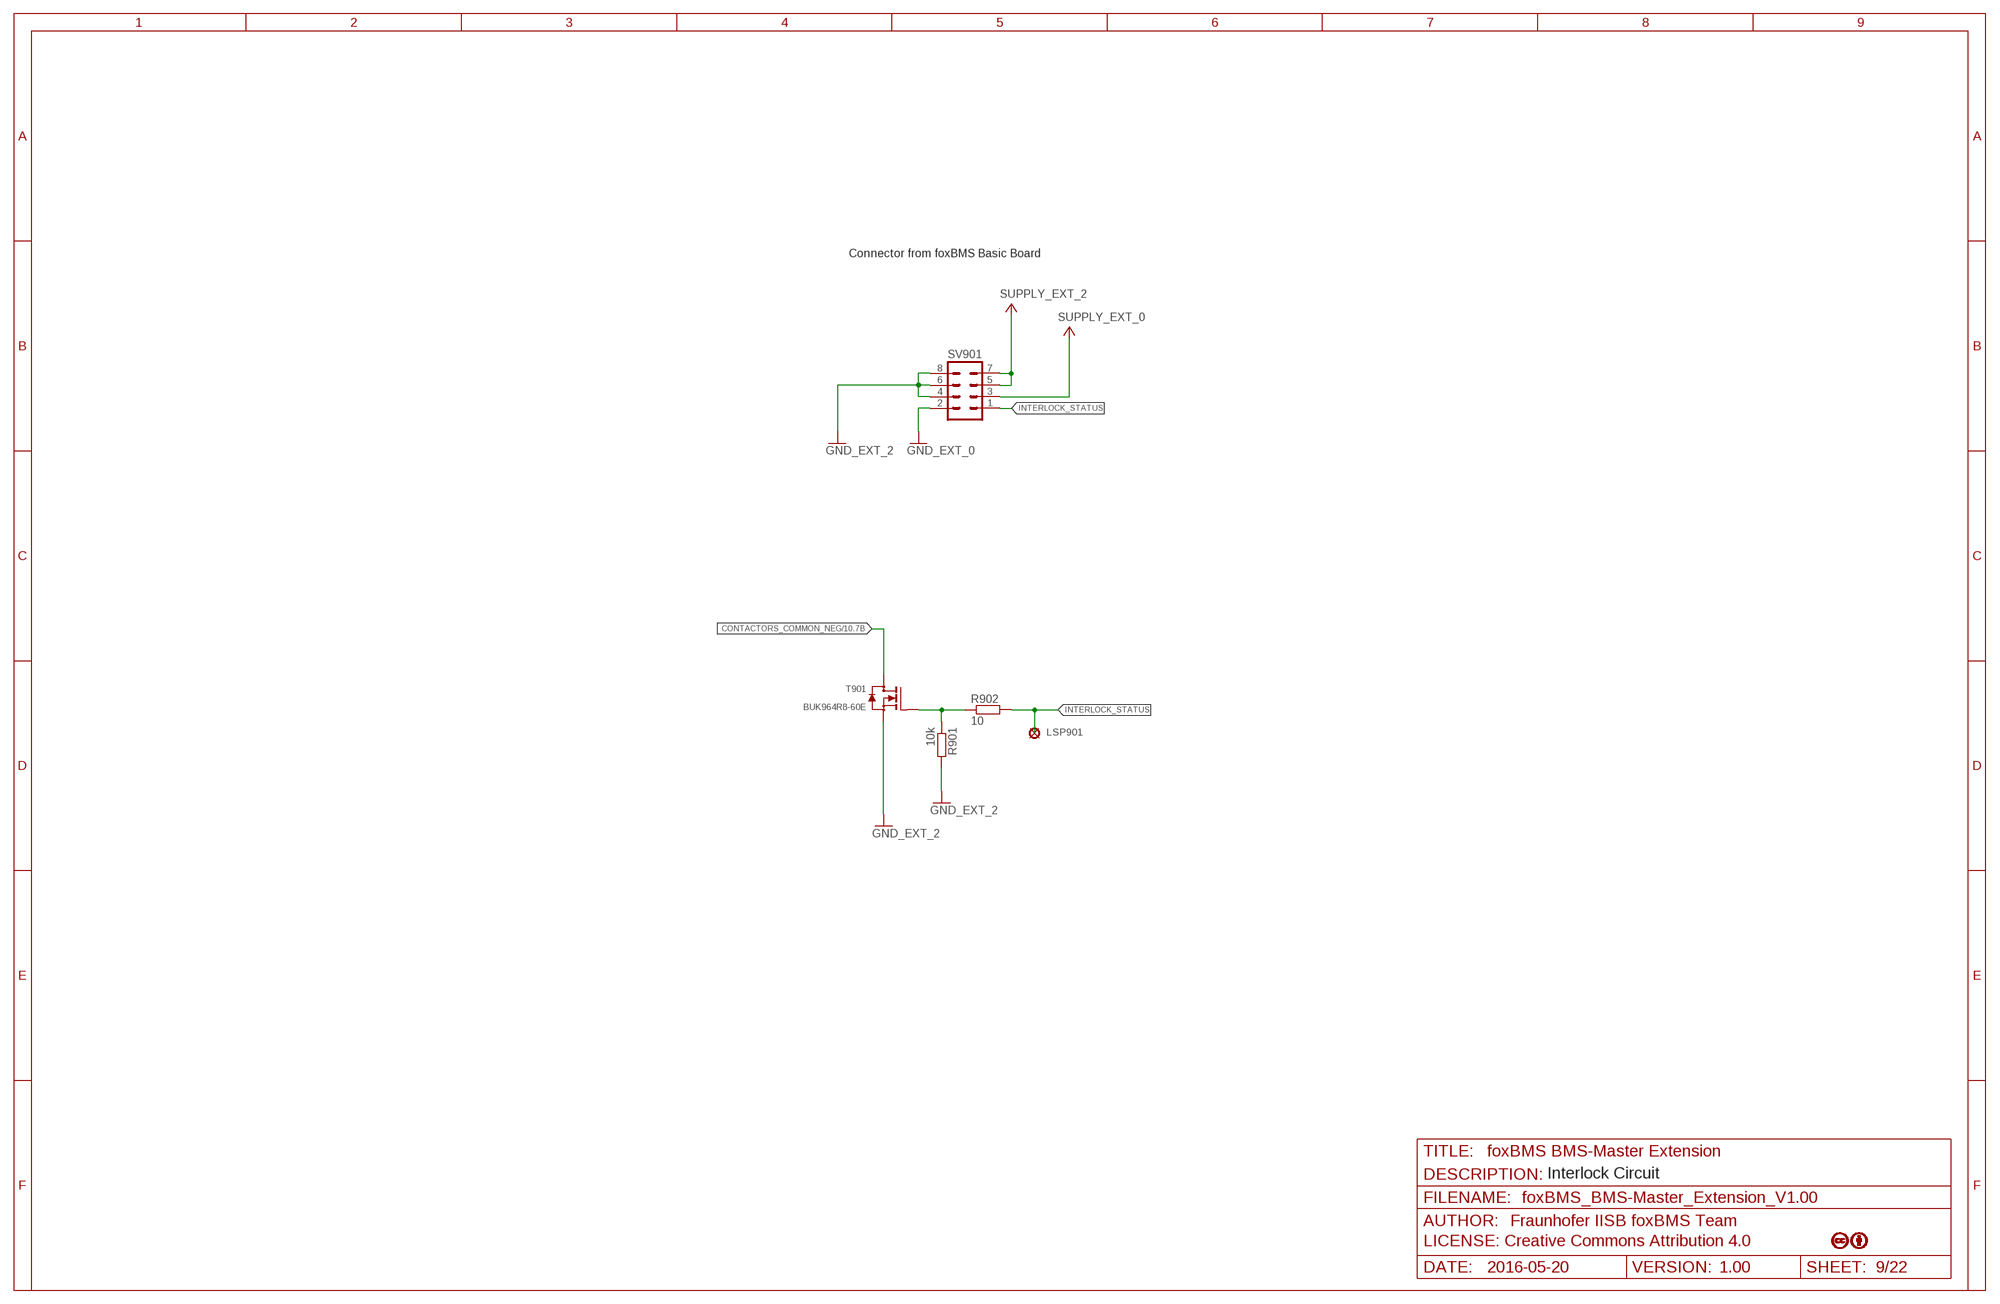
[diagram p8: schematic, sheet 9]

### Parts
LSP901  PAD_2.0X1.5MM  [PAD2.0X1.5MM]
R901  10k  R_MET_0603  [0603]
R902  10  R_MET_0603  [0603]
SV901  MA04-2  [MA04-2]
T901  BUK964R8-60E  [V_SMD_TO-263_(D²PAK)_R_NXP_REV01]

### Nets
CONTACTORS_COMMON_NEG: T901.2(D) ; also sheet 10,12
GND_EXT_0 [Power]: SV901.2 ; also sheet 11,12,19
GND_EXT_2: R901.2 SV901.4 SV901.6 SV901.8 T901.3(S) ; also sheet 13
INTERLOCK_STATUS: LSP901.P$1(MP) R902.2 SV901.1
N$1: R901.1 R902.1 T901.1(G)
SUPPLY_EXT_0: SV901.3 ; also sheet 11,19
SUPPLY_EXT_2: SV901.5 SV901.7 ; also sheet 10

### Notes on the sheet
- Connector from foxBMS Basic Board
- Interlock Circuit

## Sheet 10 of 22: Contactor Control
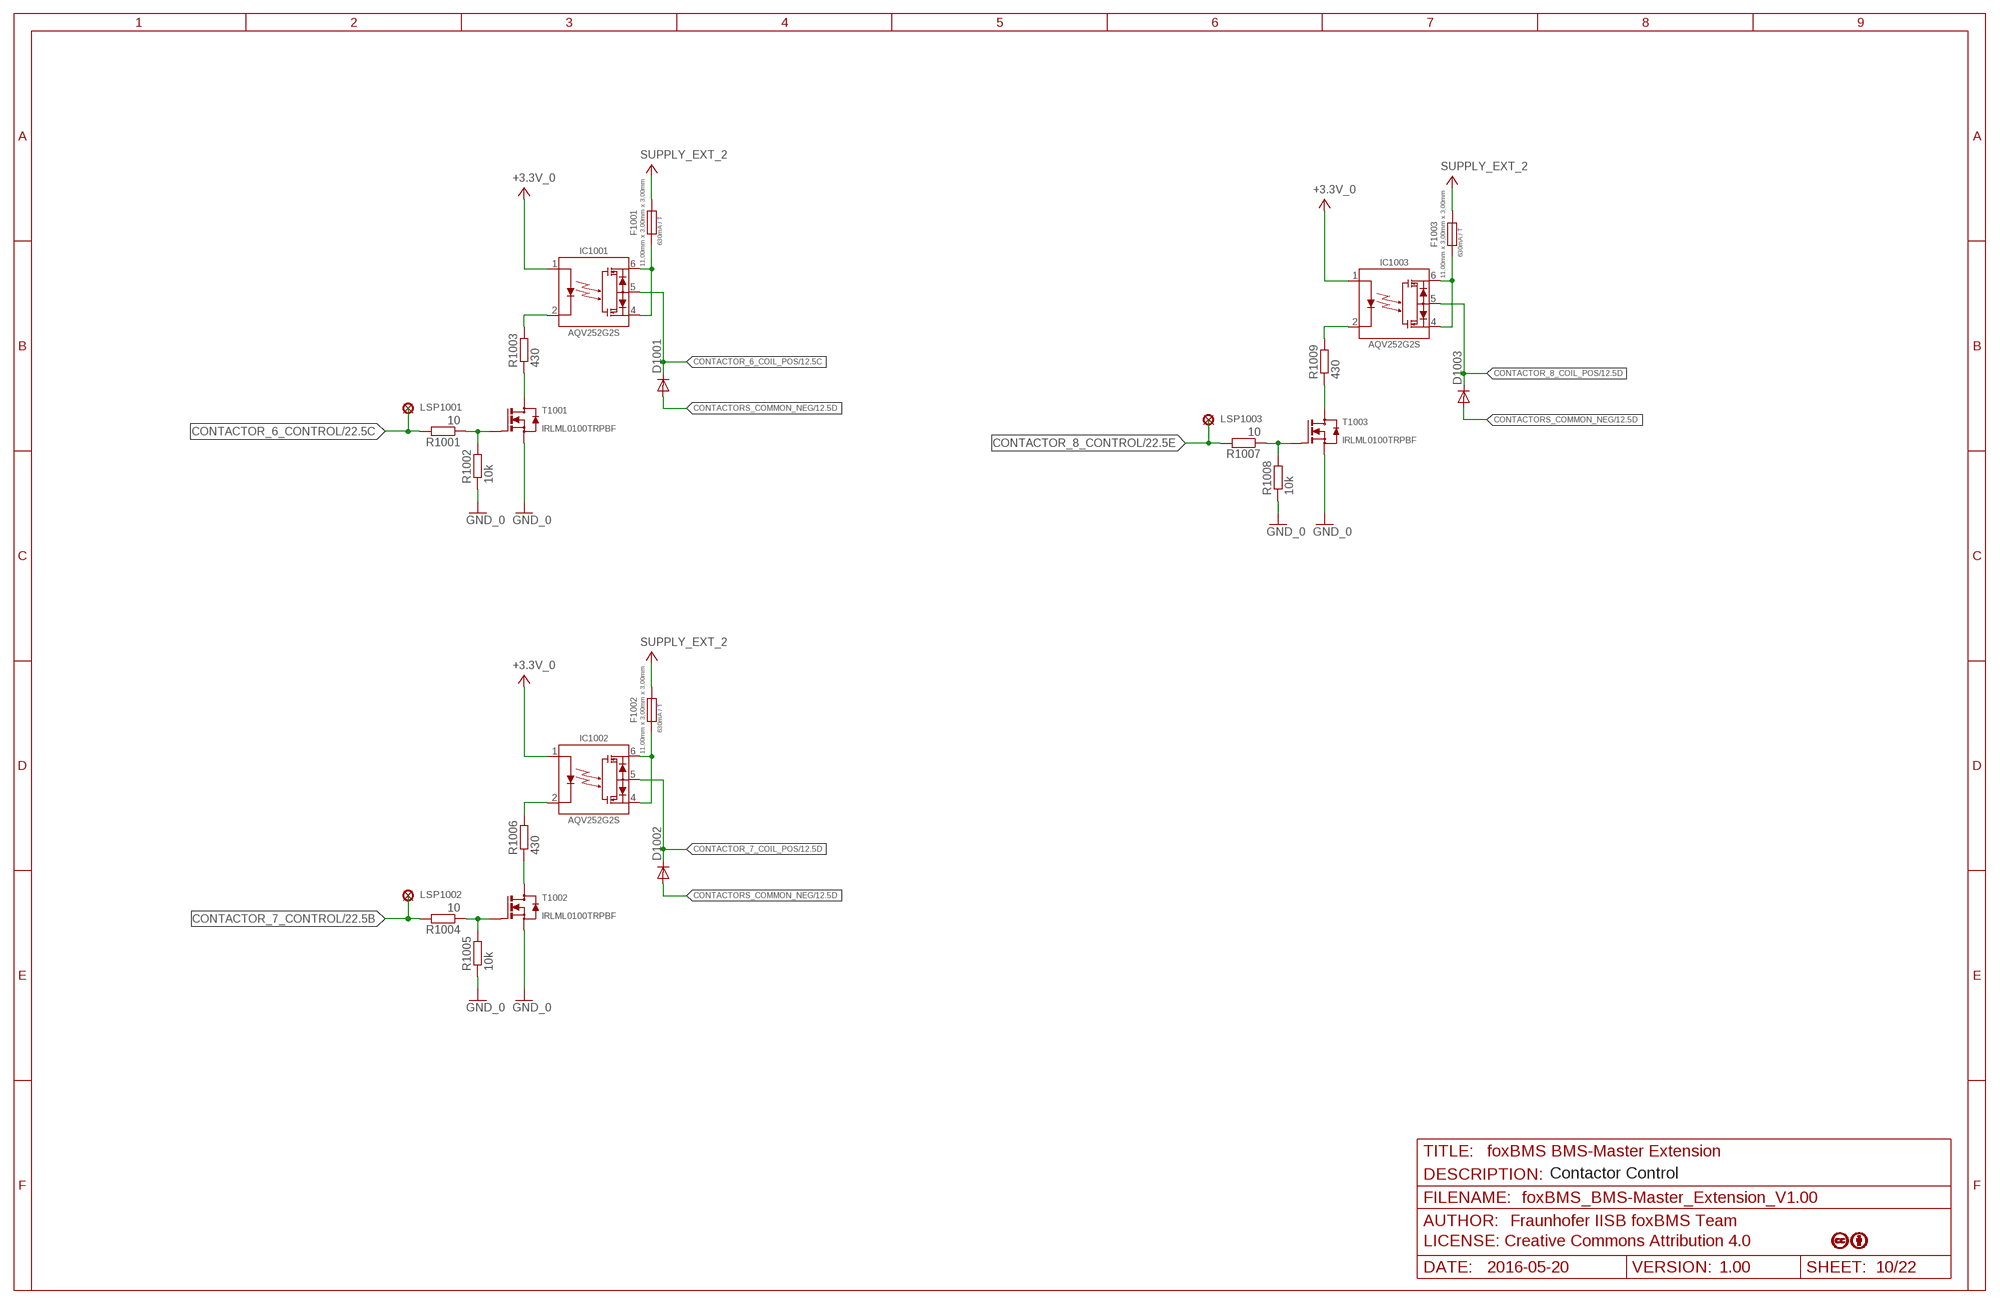
[diagram p9: schematic, sheet 10]

### Parts
D1001  DIODE-DO214BA  [DO214BA]
D1002  DIODE-DO214BA  [DO214BA]
D1003  DIODE-DO214BA  [DO214BA]
F1001  630MA_UMT  [F_SMD_11,00MMX3,00MMX3,00MM_(UMT)_R_SCHURTER_REV01]
F1002  630MA_UMT  [F_SMD_11,00MMX3,00MMX3,00MM_(UMT)_R_SCHURTER_REV01]
F1003  630MA_UMT  [F_SMD_11,00MMX3,00MMX3,00MM_(UMT)_R_SCHURTER_REV01]
IC1001  AQV252G2S  [K_SMD_SOP-6_R_PANASONIC_REV01]
IC1002  AQV252G2S  [K_SMD_SOP-6_R_PANASONIC_REV01]
IC1003  AQV252G2S  [K_SMD_SOP-6_R_PANASONIC_REV01]
LSP1001  PAD_2.0X1.5MM  [PAD2.0X1.5MM]
LSP1002  PAD_2.0X1.5MM  [PAD2.0X1.5MM]
LSP1003  PAD_2.0X1.5MM  [PAD2.0X1.5MM]
R1001  10  R_MET_0603  [0603]
R1002  10k  R_MET_0603  [0603]
R1003  430  R_MET_0603  [0603]
R1004  10  R_MET_0603  [0603]
R1005  10k  R_MET_0603  [0603]
R1006  430  R_MET_0603  [0603]
R1007  10  R_MET_0603  [0603]
R1008  10k  R_MET_0603  [0603]
R1009  430  R_MET_0603  [0603]
T1001  IRLML0100TRPBF  [V_SMD_SOT-23_(TO-236AB)_R_IR_REV01]
T1002  IRLML0100TRPBF  [V_SMD_SOT-23_(TO-236AB)_R_IR_REV01]
T1003  IRLML0100TRPBF  [V_SMD_SOT-23_(TO-236AB)_R_IR_REV01]

### Nets
+3.3V_0: IC1001.1 IC1002.1 IC1003.1 ; also sheet 8,11,13,15,17,19,20,21,22
CONTACTOR_6_COIL_POS: D1001.C IC1001.5 ; also sheet 12
CONTACTOR_6_CONTROL: LSP1001.P$1(MP) R1001.2 ; also sheet 22
CONTACTOR_7_COIL_POS: D1002.C IC1002.5 ; also sheet 12
CONTACTOR_7_CONTROL: LSP1002.P$1(MP) R1004.2 ; also sheet 22
CONTACTOR_8_COIL_POS: D1003.C IC1003.5 ; also sheet 12
CONTACTOR_8_CONTROL: LSP1003.P$1(MP) R1007.2 ; also sheet 22
CONTACTORS_COMMON_NEG: D1001.A D1002.A D1003.A ; also sheet 9,12
GND_0: R1002.1 R1005.1 R1008.1 T1001.2(S) T1002.2(S) T1003.2(S) ; also sheet 8,11,13,15,17,19,20,21,22
N$3: R1003.1 T1001.3(D)
N$5: R1006.1 T1002.3(D)
N$6: R1009.1 T1003.3(D)
N$18: F1001.1 IC1001.4 IC1001.6
N$19: F1002.1 IC1002.4 IC1002.6
N$21: F1003.1 IC1003.4 IC1003.6
N$261: IC1001.2 R1003.2
N$307: R1001.1 R1002.2 T1001.1(G)
N$308: IC1002.2 R1006.2
N$312: R1004.1 R1005.2 T1002.1(G)
N$313: IC1003.2 R1009.2
N$315: R1007.1 R1008.2 T1003.1(G)
SUPPLY_EXT_2: F1001.2 F1002.2 F1003.2 ; also sheet 9
Unconnected: IC1001.3(NC) IC1002.3(NC) IC1003.3(NC)

### Notes on the sheet
- Contactor Control

## Sheet 11 of 22: Contactor Feedback
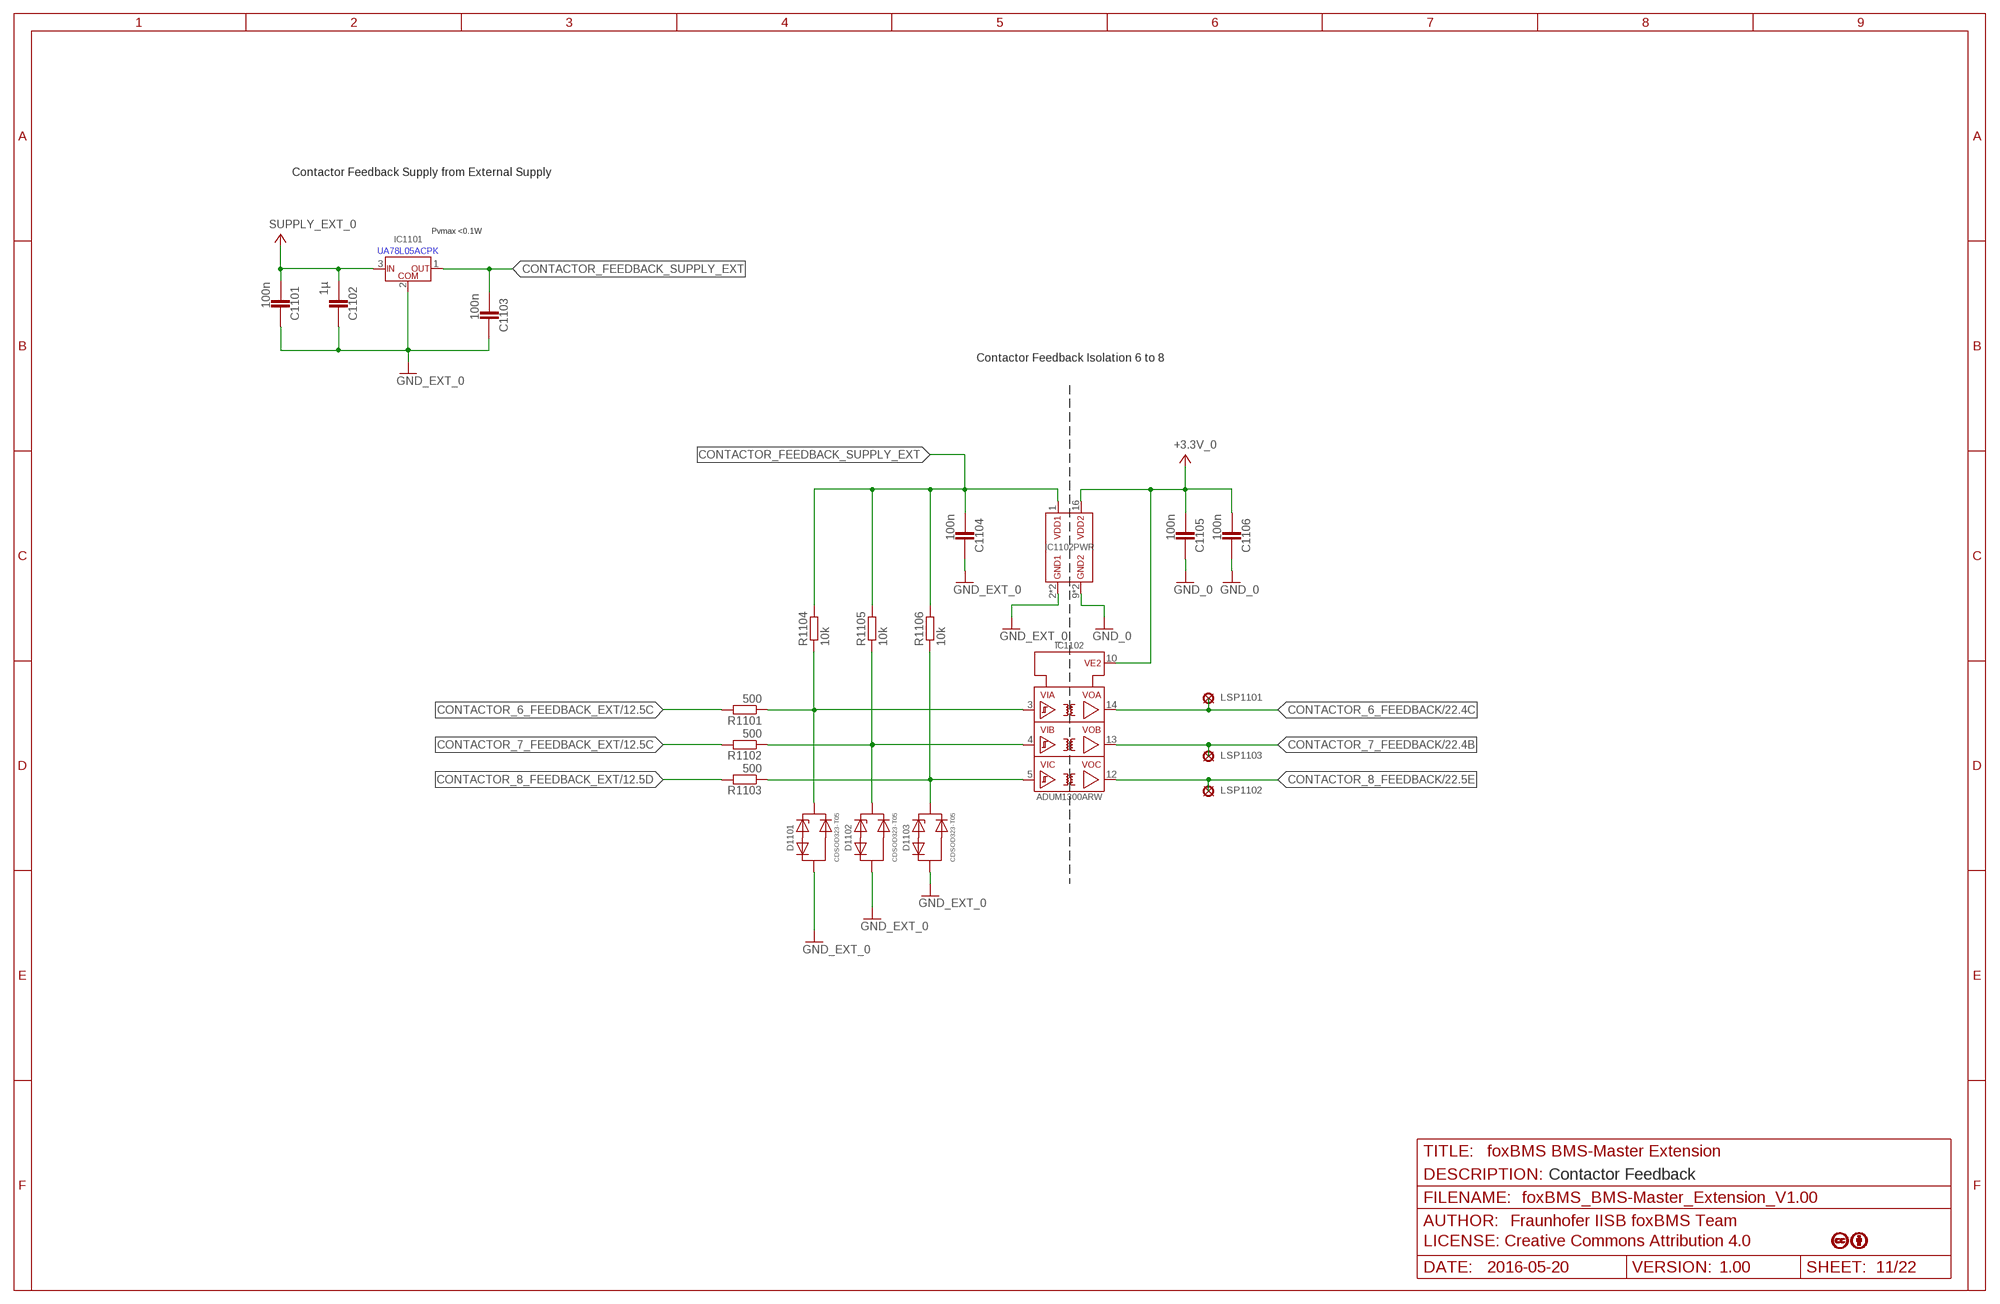
[diagram p10: schematic, sheet 11]

### Parts
C1101  100n  C_X7R_0603  [0603]
C1102  1µ  C_X7R_0603  [0603]
C1103  100n  C_X7R_0603  [0603]
C1104  100n  C_X7R_0603  [0603]
C1105  100n  C_X7R_0603  [0603]
C1106  100n  C_X7R_0603  [0603]
D1101  CDSOD323-T05  [D_SMD_SOD323_(SC-76)_R_BOURNS_REV01]
D1102  CDSOD323-T05  [D_SMD_SOD323_(SC-76)_R_BOURNS_REV01]
D1103  CDSOD323-T05  [D_SMD_SOD323_(SC-76)_R_BOURNS_REV01]
IC1101  UA78L05ACPK  [IC_SMD_SOT-89_(SC-62/TO-243)_(R-PSSO-F3)_R_TI_REV01]
IC1102  ADUM1300ARW  [IC_SMD_SOIC-16_(JEDEC_MS-013-AA)_R_ANALOG_REV01]
LSP1101  PAD_2.0X1.5MM  [PAD2.0X1.5MM]
LSP1102  PAD_2.0X1.5MM  [PAD2.0X1.5MM]
LSP1103  PAD_2.0X1.5MM  [PAD2.0X1.5MM]
R1101  500  R_MET_0603  [0603]
R1102  500  R_MET_0603  [0603]
R1103  500  R_MET_0603  [0603]
R1104  10k  R_MET_0603  [0603]
R1105  10k  R_MET_0603  [0603]
R1106  10k  R_MET_0603  [0603]

### Nets
+3.3V_0: C1105.1 C1106.1 IC1102.10(VE2) IC1102.16(VDD2) ; also sheet 8,10,13,15,17,19,20,21,22
CONTACTOR_6_FEEDBACK: IC1102.14(VOA) LSP1101.P$1(MP) ; also sheet 22
CONTACTOR_6_FEEDBACK_EXT: R1101.2 ; also sheet 12
CONTACTOR_7_FEEDBACK: IC1102.13(VOB) LSP1103.P$1(MP) ; also sheet 22
CONTACTOR_7_FEEDBACK_EXT: R1102.2 ; also sheet 12
CONTACTOR_8_FEEDBACK: IC1102.12(VOC) LSP1102.P$1(MP) ; also sheet 22
CONTACTOR_8_FEEDBACK_EXT: R1103.2 ; also sheet 12
CONTACTOR_FEEDBACK_SUPPLY_EXT: C1103.1 C1104.1 IC1101.1(OUT) IC1102.1(VDD1) R1104.2 R1105.2 R1106.2
GND_0: C1105.2 C1106.2 IC1102.9(GND2) IC1102.15(GND2) ; also sheet 8,10,13,15,17,19,20,21,22
GND_EXT_0 [Power]: C1101.2 C1102.2 C1103.2 C1104.2 D1101.A D1102.A D1103.A IC1101.2(COM) IC1102.2(GND1) IC1102.8(GND1) ; also sheet 9,12,19
N$2: D1101.C IC1102.3(VIA) R1101.1 R1104.1
N$22: D1102.C IC1102.4(VIB) R1102.1 R1105.1
N$23: D1103.C IC1102.5(VIC) R1103.1 R1106.1
SUPPLY_EXT_0: C1101.1 C1102.1 IC1101.3(IN) ; also sheet 9,19
Unconnected: IC1102.6(NC$1) IC1102.7(NC$1) IC1102.11(NC$1)

### Notes on the sheet
- Contactor Feedback Supply from External Supply
- Pvmax <0.1W
- Contactor Feedback Isolation 6 to 8
- Contactor Feedback

## Sheet 12 of 22: Contactor Connectors
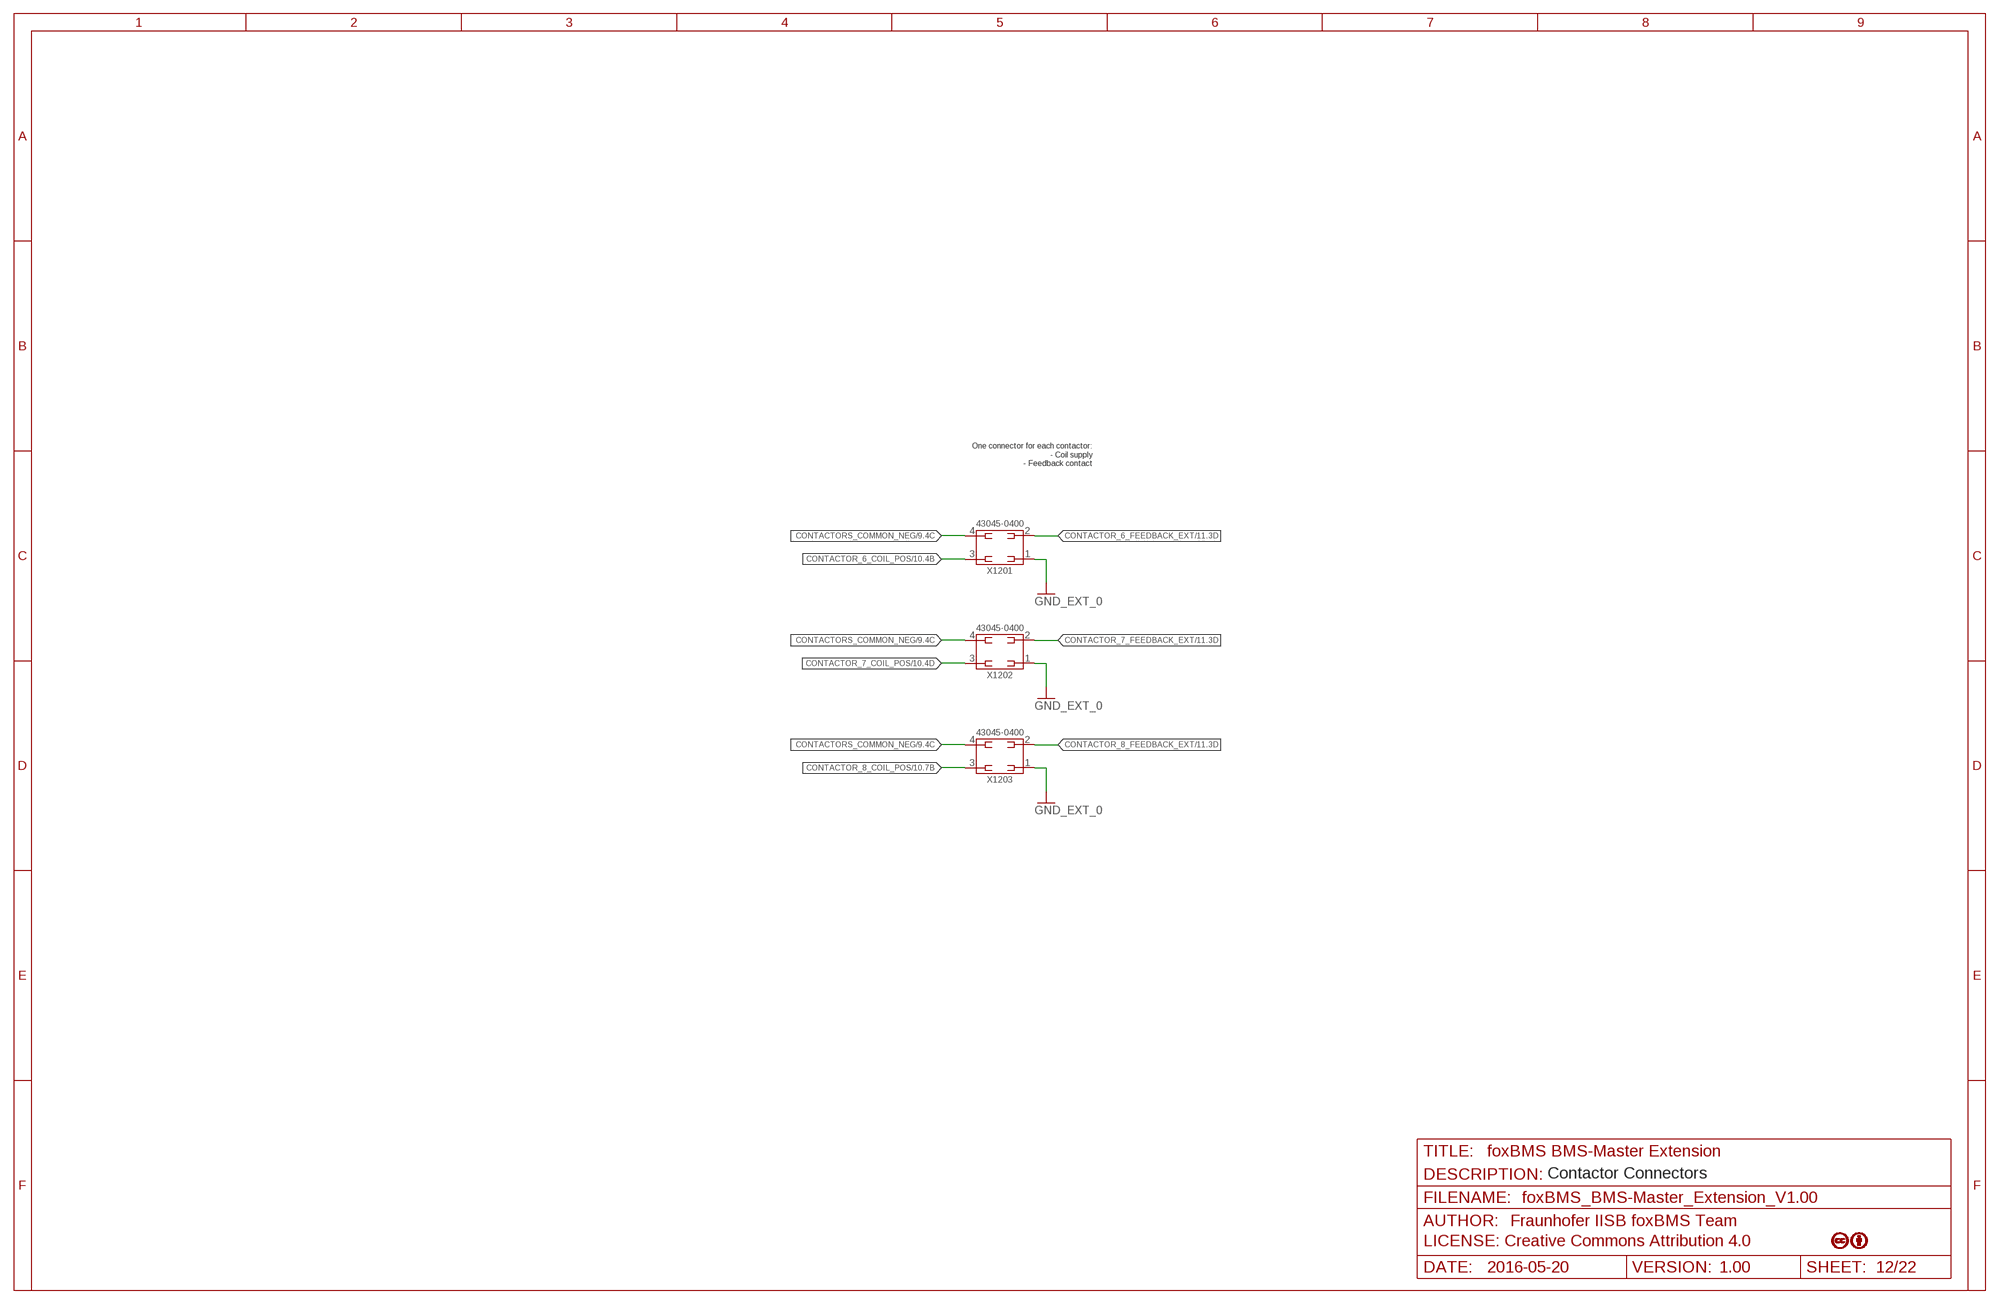
[diagram p11: schematic, sheet 12]

### Parts
X1201  43045-0400_MOLEX_4PIN  [X_TH_MOLEX_43045-0400_R_REV01]
X1202  43045-0400_MOLEX_4PIN  [X_TH_MOLEX_43045-0400_R_REV01]
X1203  43045-0400_MOLEX_4PIN  [X_TH_MOLEX_43045-0400_R_REV01]

### Nets
CONTACTOR_6_COIL_POS: X1201.3 ; also sheet 10
CONTACTOR_6_FEEDBACK_EXT: X1201.2 ; also sheet 11
CONTACTOR_7_COIL_POS: X1202.3 ; also sheet 10
CONTACTOR_7_FEEDBACK_EXT: X1202.2 ; also sheet 11
CONTACTOR_8_COIL_POS: X1203.3 ; also sheet 10
CONTACTOR_8_FEEDBACK_EXT: X1203.2 ; also sheet 11
CONTACTORS_COMMON_NEG: X1201.4 X1202.4 X1203.4 ; also sheet 9,10
GND_EXT_0 [Power]: X1201.1 X1202.1 X1203.1 ; also sheet 9,11,19

### Notes on the sheet
- One connector for each contactor:
  - Coil supply
  - Feedback contact
- Contactor Connectors

## Sheet 13 of 22: RS485
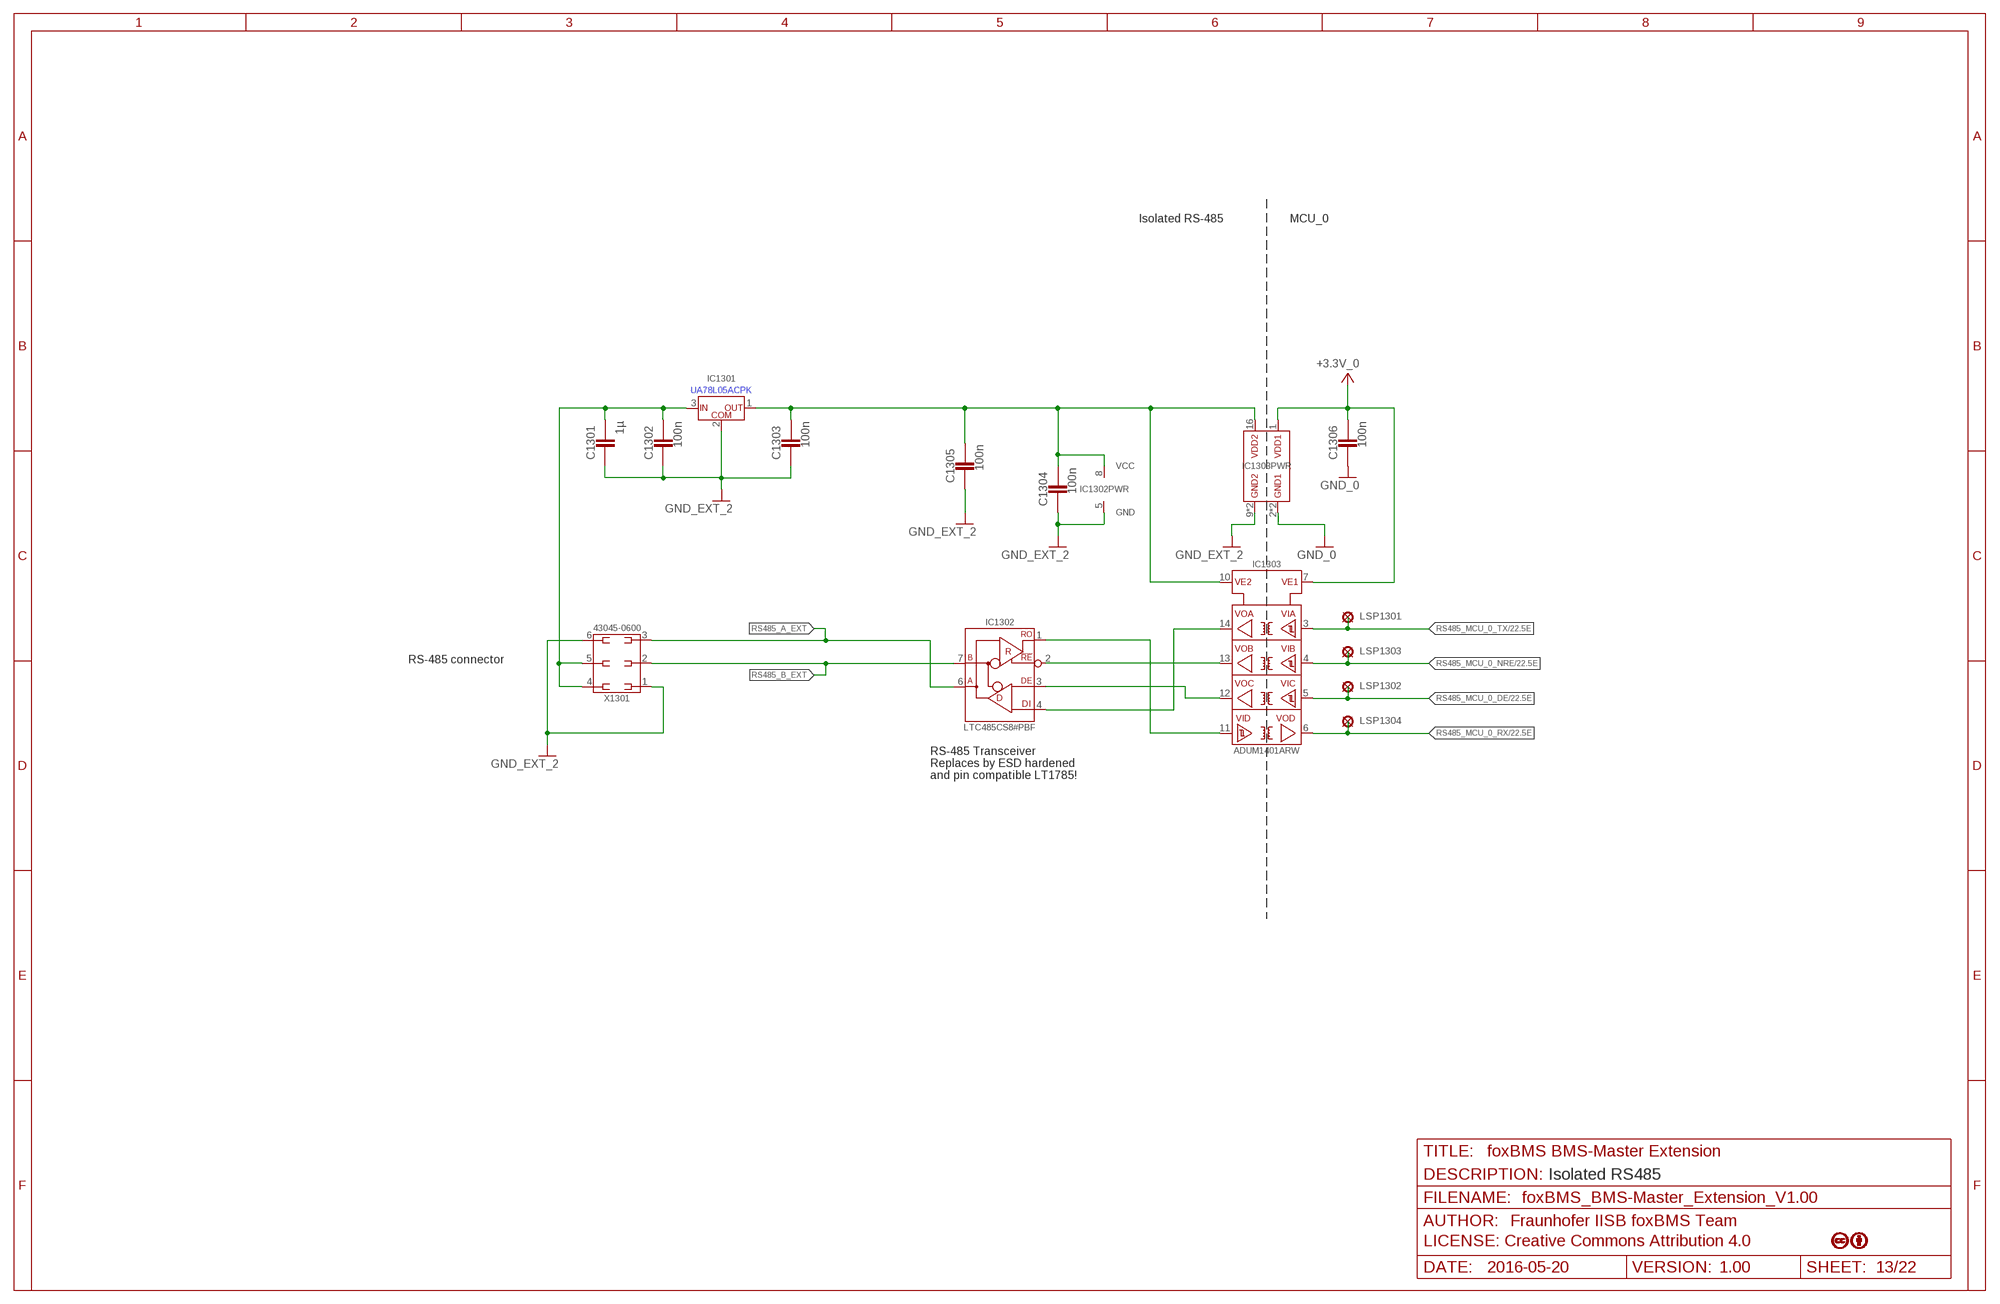
[diagram p12: schematic, sheet 13]

### Parts
C1301  1µ  C_X7R_0603  [0603]
C1302  100n  C_X7R_0603  [0603]
C1303  100n  C_X7R_0603  [0603]
C1304  100n  C_X7R_0603  [0603]
C1305  100n  C_X7R_0603  [0603]
C1306  100n  C_X7R_0603  [0603]
IC1301  UA78L05ACPK  [IC_SMD_SOT-89_(SC-62/TO-243)_(R-PSSO-F3)_R_TI_REV01]
IC1302  LTC485CS8#PBF  [IC_SMD_SOIC-8_(S8_REV_G)_R_LINEAR_REV01]
IC1303  ADUM1401ARW  [IC_SMD_SOIC-16_(JEDEC_MS-013-AA)_R_ANALOG_REV01]
LSP1301  PAD_2.0X1.5MM  [PAD2.0X1.5MM]
LSP1302  PAD_2.0X1.5MM  [PAD2.0X1.5MM]
LSP1303  PAD_2.0X1.5MM  [PAD2.0X1.5MM]
LSP1304  PAD_2.0X1.5MM  [PAD2.0X1.5MM]
X1301  43045-0600_MOLEX_6PIN  [X_TH_MOLEX_43045-0600_R_REV01]

### Nets
+3.3V_0: C1306.1 IC1303.1(VDD1) IC1303.7(VE1) ; also sheet 8,10,11,15,17,19,20,21,22
GND_0: C1306.2 IC1303.2(GND1) IC1303.8(GND1) ; also sheet 8,10,11,15,17,19,20,21,22
GND_EXT_2: C1301.2 C1302.2 C1303.2 C1304.2 C1305.2 IC1301.2(COM) IC1302.5(GND) IC1303.9(GND2) IC1303.15(GND2) X1301.1 X1301.6 ; also sheet 9
N$17: C1301.1 C1302.1 IC1301.3(IN) X1301.4 X1301.5
N$274: IC1302.1(RO) IC1303.11(VID)
N$275: IC1302.2(!RE) IC1303.13(VOB)
N$276: IC1302.3(DE) IC1303.12(VOC)
N$277: IC1302.4(DI) IC1303.14(VOA)
N$279: C1303.1 C1304.1 C1305.1 IC1301.1(OUT) IC1302.8(VCC) IC1303.10(VE2) IC1303.16(VDD2)
RS485_A_EXT: IC1302.6(A) X1301.3
RS485_B_EXT: IC1302.7(B) X1301.2
RS485_MCU_0_DE: IC1303.5(VIC) LSP1302.P$1(MP) ; also sheet 22
RS485_MCU_0_NRE: IC1303.4(VIB) LSP1303.P$1(MP) ; also sheet 22
RS485_MCU_0_RX: IC1303.6(VOD) LSP1304.P$1(MP) ; also sheet 22
RS485_MCU_0_TX: IC1303.3(VIA) LSP1301.P$1(MP) ; also sheet 22

### Notes on the sheet
- Isolated RS-485 | MCU_0
- RS-485 connector
- RS-485 Transceiver
  Replaces by ESD hardened 
  and pin compatible LT1785!
- Isolated RS485

## Sheet 14 of 22: Isolated USB
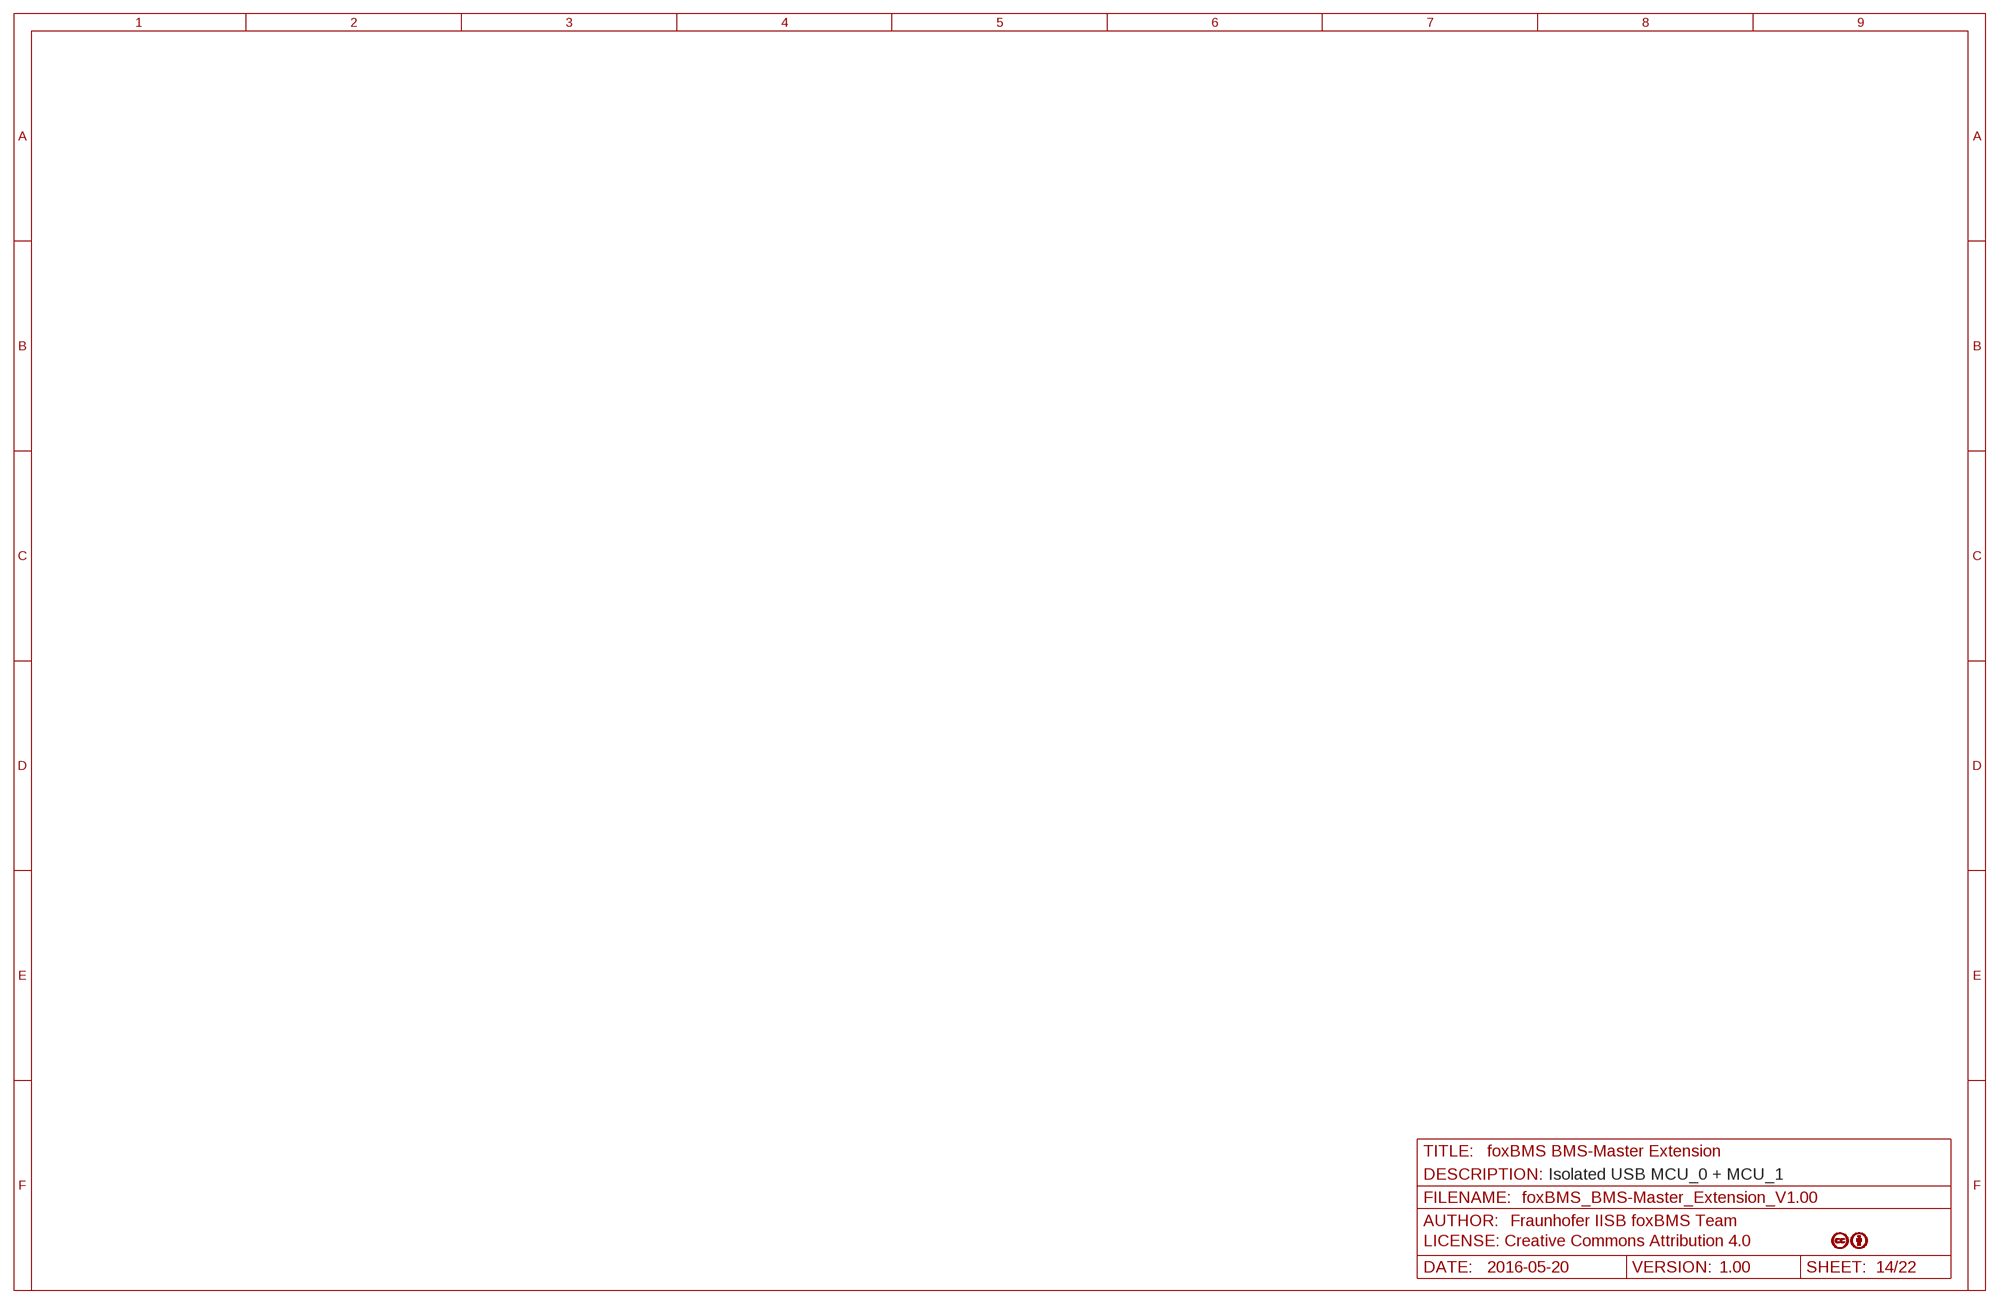
[diagram p13: schematic, sheet 14]

### Notes on the sheet
- Isolated USB MCU_0 + MCU_1

## Sheet 15 of 22: EEPROM + SDCard
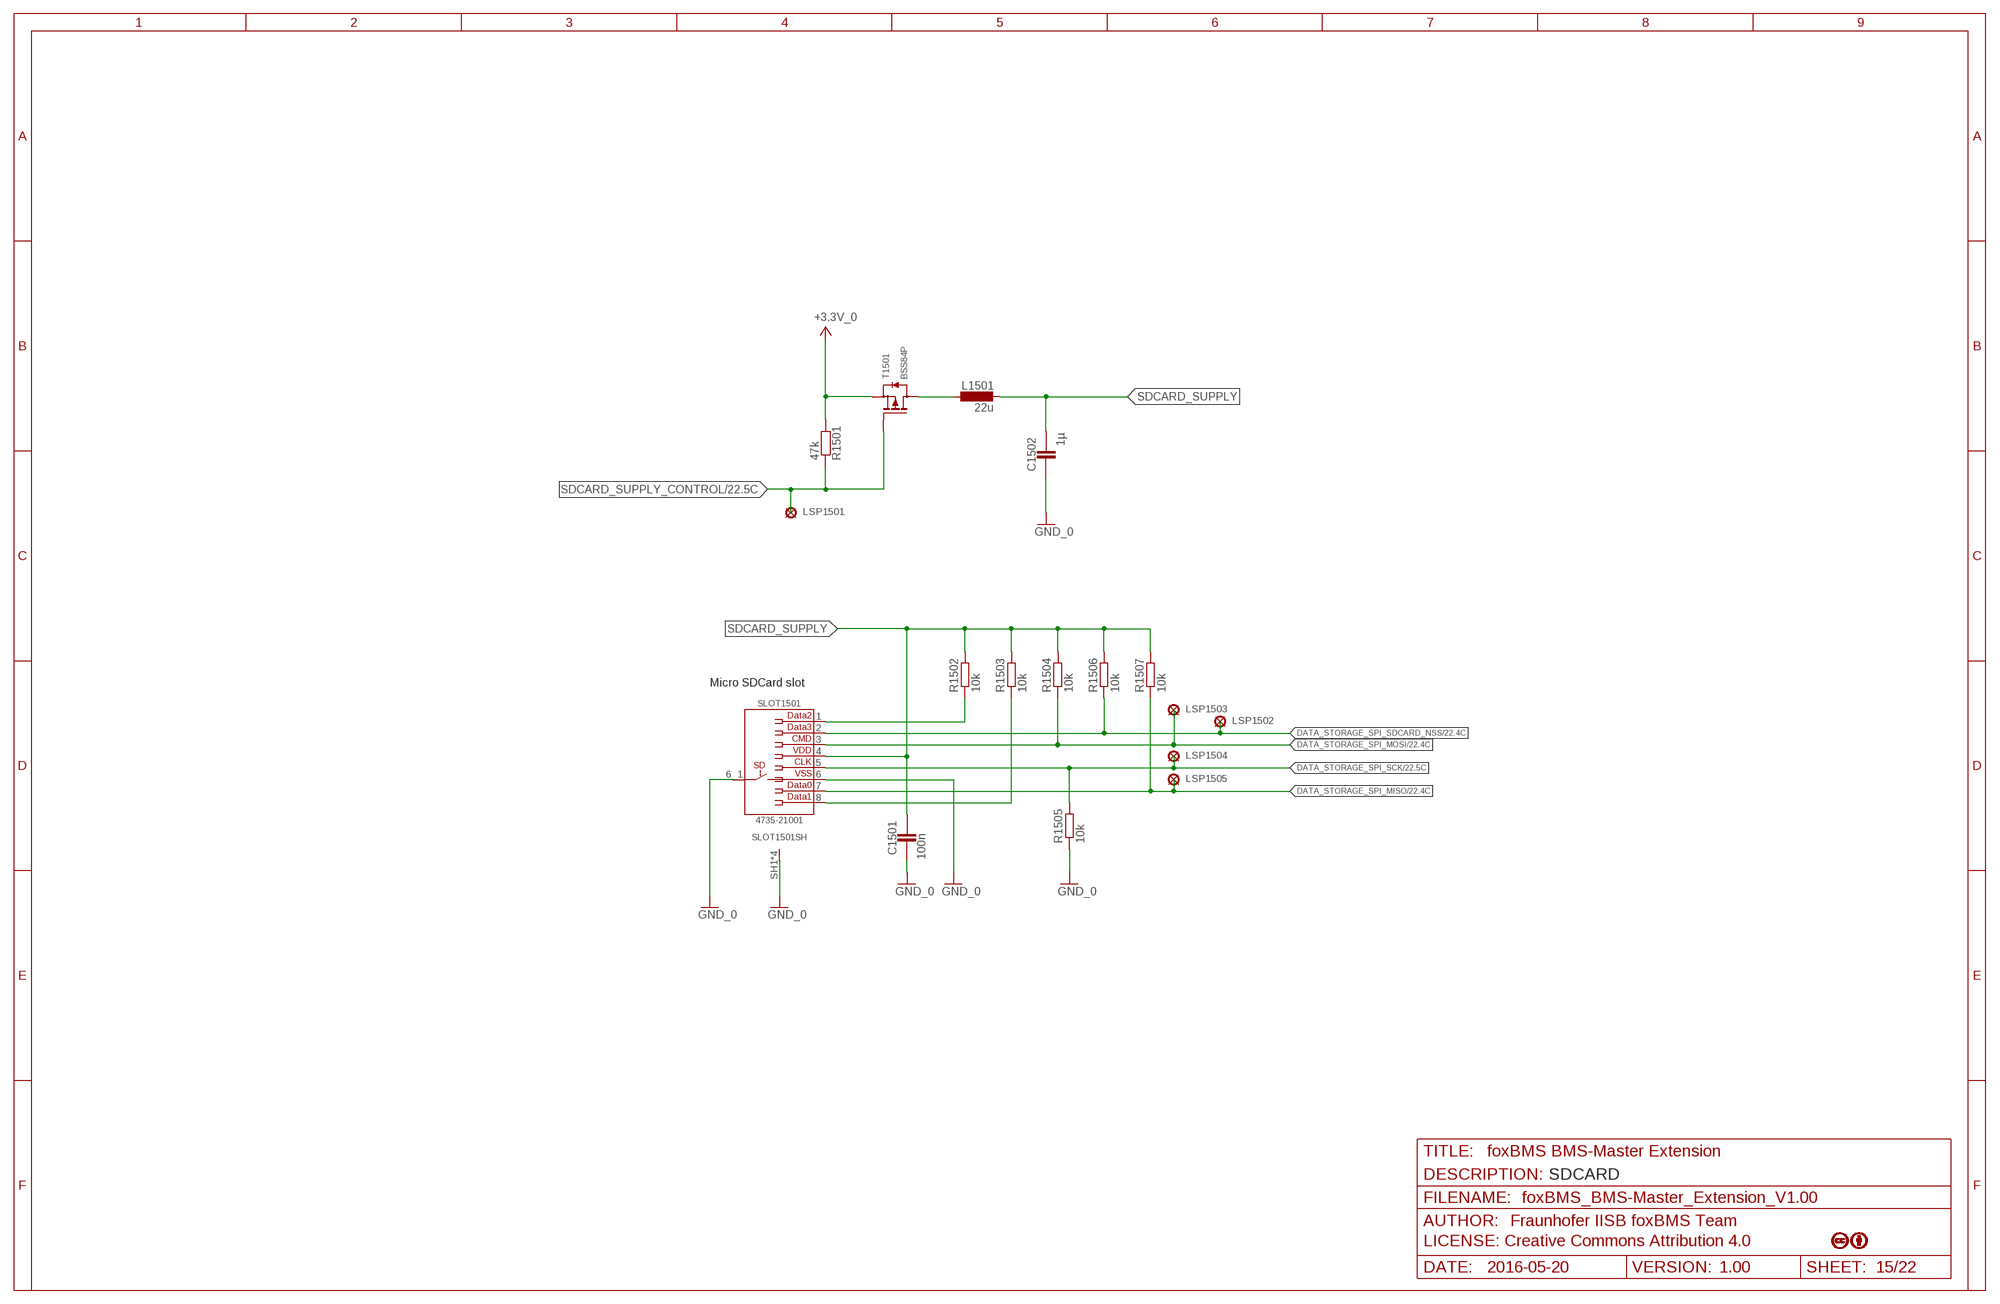
[diagram p14: schematic, sheet 15]

### Parts
C1501  100n  C_NP0_0603  [0603]
C1502  1µ  C_NP0_0603  [0603]
L1501  22u  L0805  [0805]
LSP1501  PAD_2.0X1.5MM  [PAD2.0X1.5MM]
LSP1502  PAD_2.0X1.5MM  [PAD2.0X1.5MM]
LSP1503  PAD_2.0X1.5MM  [PAD2.0X1.5MM]
LSP1504  PAD_2.0X1.5MM  [PAD2.0X1.5MM]
LSP1505  PAD_2.0X1.5MM  [PAD2.0X1.5MM]
R1501  47k  R_MET_0603  [0603]
R1502  10k  R_MET_0603  [0603]
R1503  10k  R_MET_0603  [0603]
R1504  10k  R_MET_0603  [0603]
R1505  10k  R_MET_0603  [0603]
R1506  10k  R_MET_0603  [0603]
R1507  10k  R_MET_0603  [0603]
SLOT1501  MICRO_SD  [X_SMD_MICRO-SD-4735-21001_R_MOLEX_REV01]
T1501  BSS84P  [V_SMD_SOT23_(TO-236AB)_R_INFINEON_REV01]

### Nets
+3.3V_0: R1501.2 T1501.2(S) ; also sheet 8,10,11,13,17,19,20,21,22
DATA_STORAGE_SPI_MISO [controller]: LSP1505.P$1(MP) R1507.1 SLOT1501.7 ; also sheet 22
DATA_STORAGE_SPI_MOSI [controller]: LSP1503.P$1(MP) R1504.1 SLOT1501.3 ; also sheet 22
DATA_STORAGE_SPI_SCK [controller]: LSP1504.P$1(MP) R1505.2 SLOT1501.5 ; also sheet 22
DATA_STORAGE_SPI_SDCARD_NSS: LSP1502.P$1(MP) R1506.1 SLOT1501.2 ; also sheet 22
GND_0: C1501.1 C1502.2 R1505.1 SLOT1501.6 SLOT1501.6_1 SLOT1501.SH1(SH) SLOT1501.SH2(SH) SLOT1501.SH3(SH) SLOT1501.SH5(SH) ; also sheet 8,10,11,13,17,19,20,21,22
N$253: L1501.2 T1501.3(D)
N$254: R1502.1 SLOT1501.1
N$255: R1503.1 SLOT1501.8
SDCARD_SUPPLY: C1501.2 C1502.1 L1501.1 R1502.2 R1503.2 R1504.2 R1506.2 R1507.2 SLOT1501.4
SDCARD_SUPPLY_CONTROL: LSP1501.P$1(MP) R1501.1 T1501.1(G) ; also sheet 22

### Notes on the sheet
- Micro SDCard slot
- SDCARD

## Sheet 16 of 22: BMS-Interface Interface
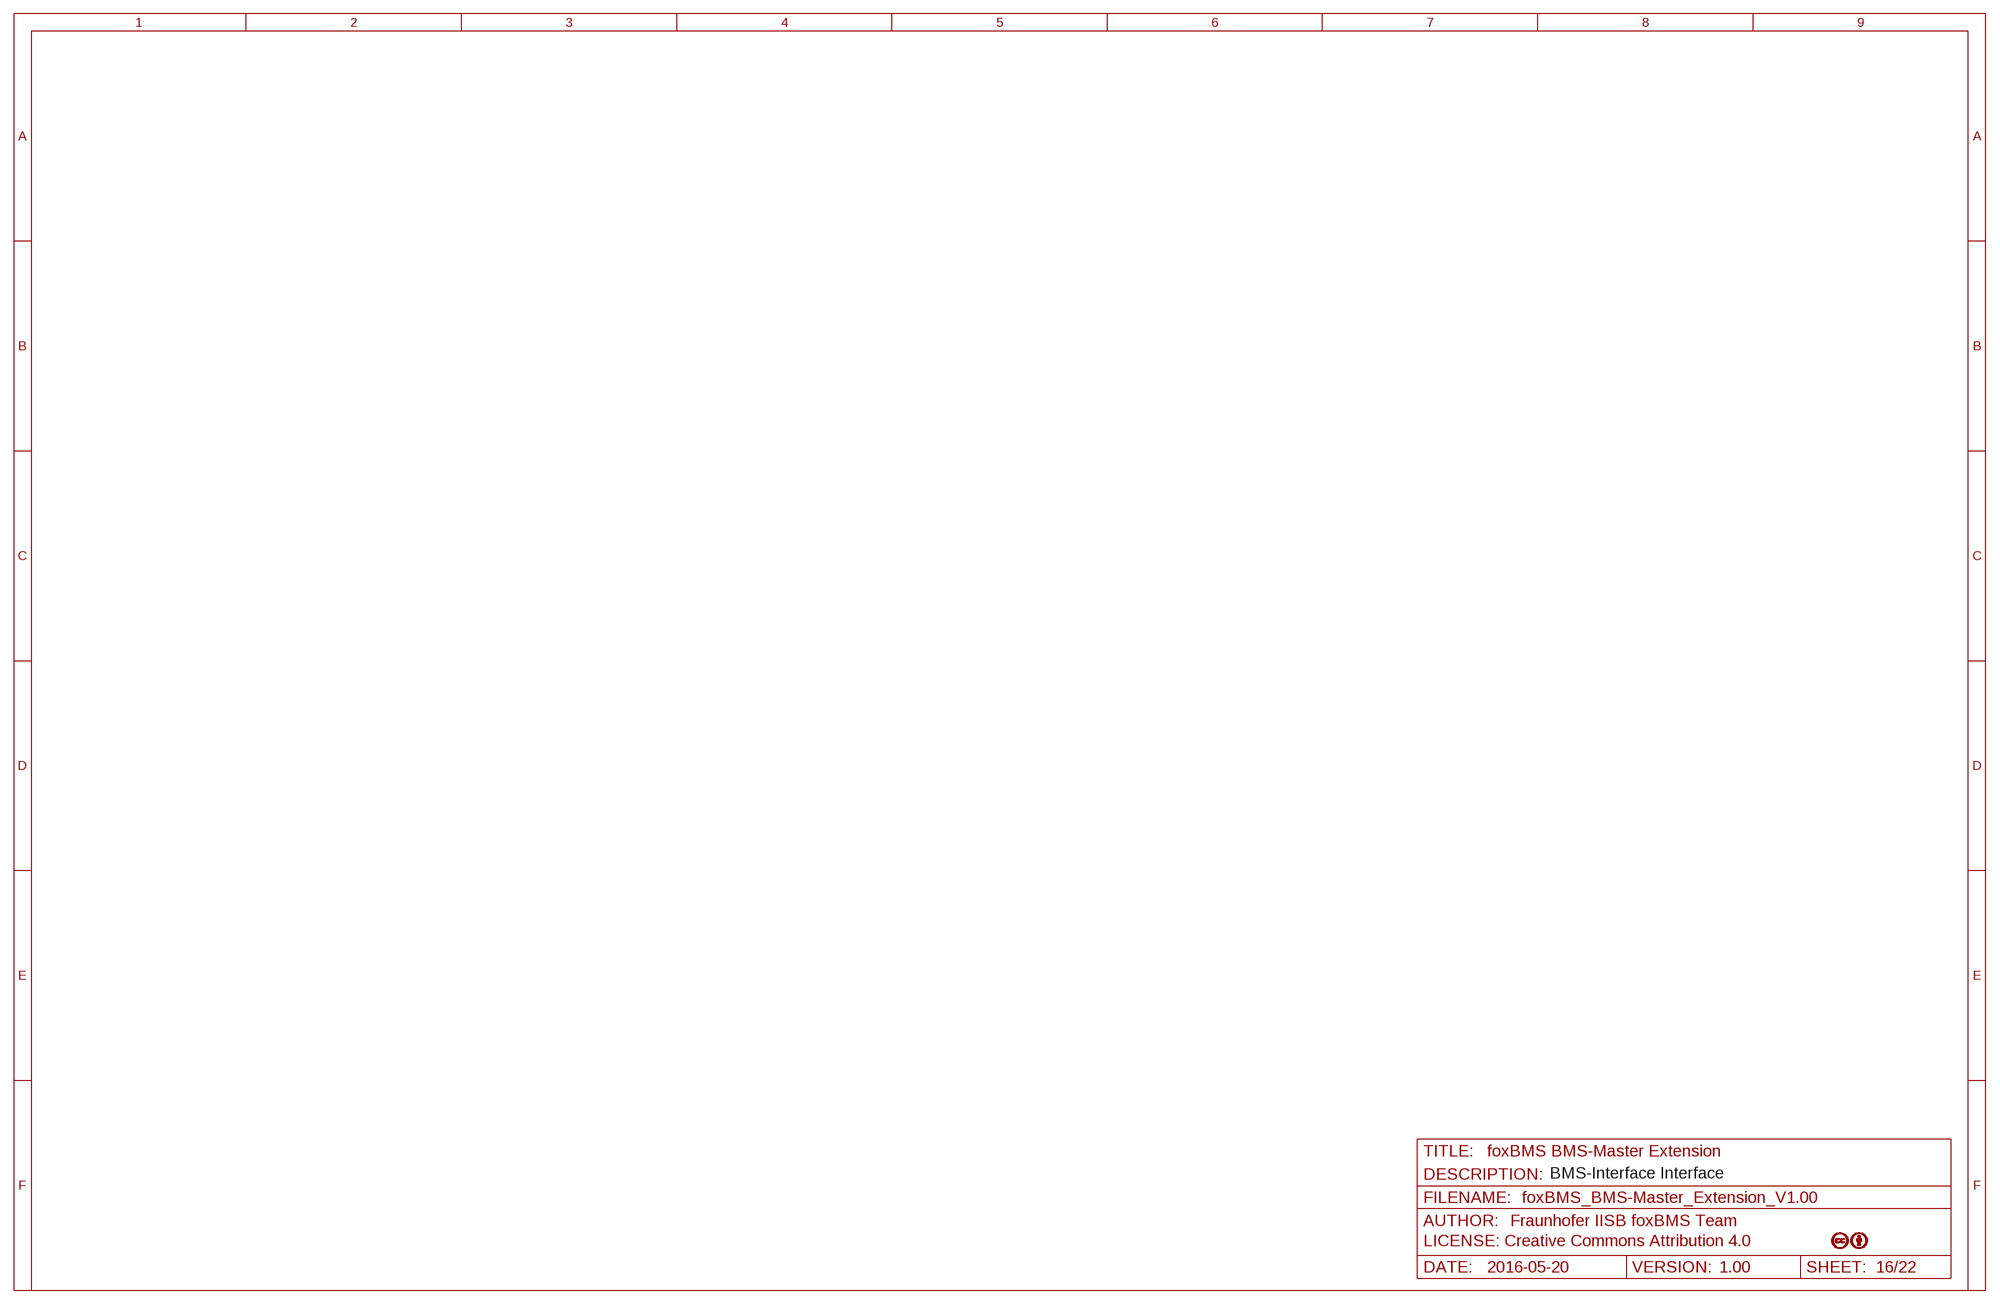
[diagram p15: schematic, sheet 16]

### Notes on the sheet
- BMS-Interface Interface

## Sheet 17 of 22: Analog Inputs
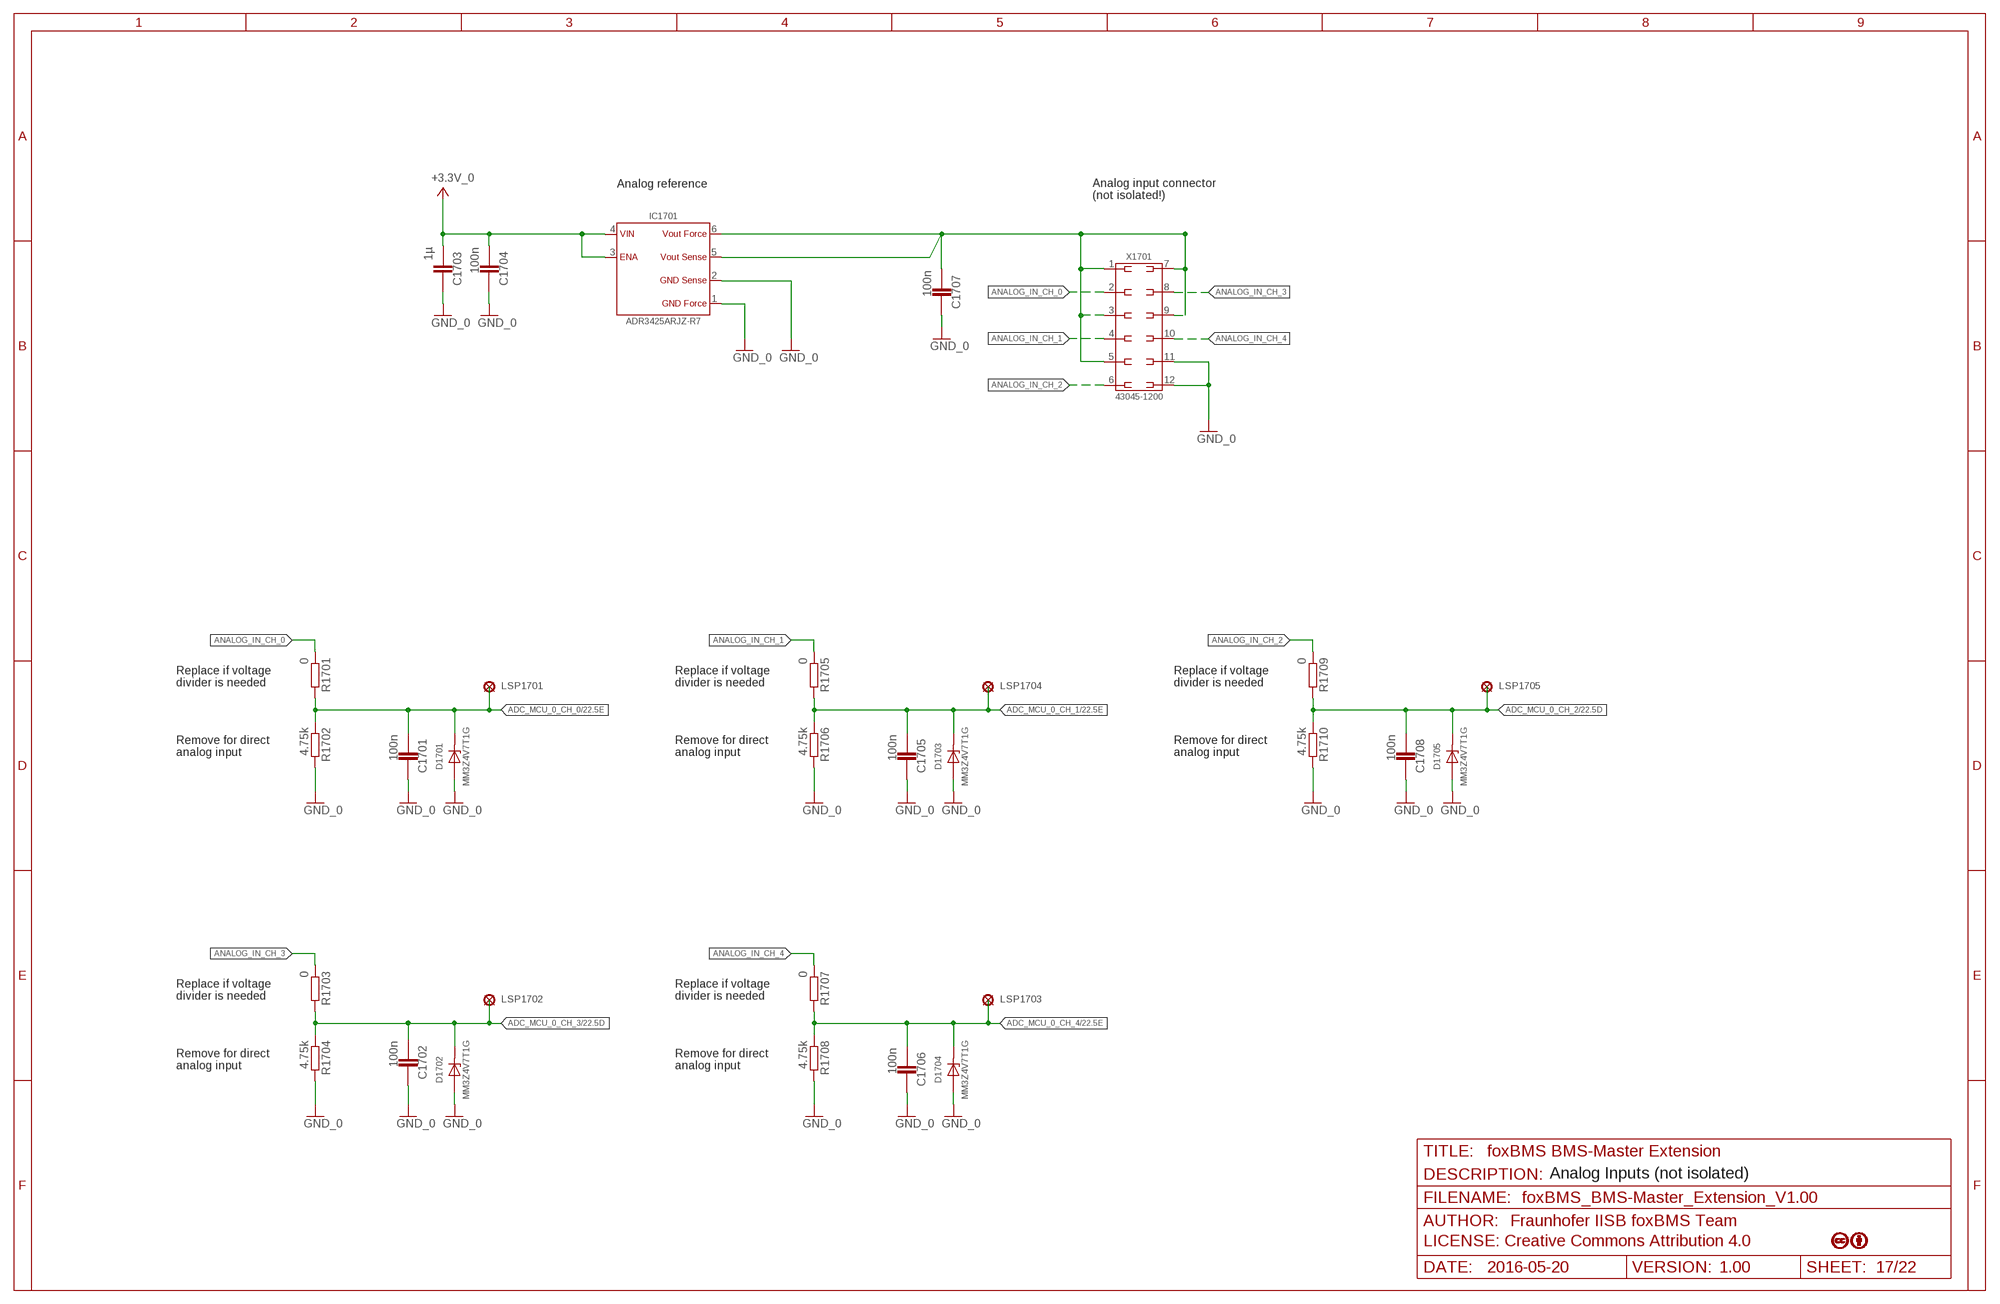
[diagram p16: schematic, sheet 17]

### Parts
C1701  100n  C_X7R_0603  [0603]
C1702  100n  C_X7R_0603  [0603]
C1703  1µ  C_X7R_0603  [0603]
C1704  100n  C_X7R_0603  [0603]
C1705  100n  C_X7R_0603  [0603]
C1706  100n  C_X7R_0603  [0603]
C1707  100n  C_X7R_0603  [0603]
C1708  100n  C_X7R_0603  [0603]
D1701  MM3Z3V3ST1G  MM3Z4V7T1G  [D_SMD_SOD323_(SC-76)_R_ON_REV01]
D1702  MM3Z3V3ST1G  MM3Z4V7T1G  [D_SMD_SOD323_(SC-76)_R_ON_REV01]
D1703  MM3Z3V3ST1G  MM3Z4V7T1G  [D_SMD_SOD323_(SC-76)_R_ON_REV01]
D1704  MM3Z3V3ST1G  MM3Z4V7T1G  [D_SMD_SOD323_(SC-76)_R_ON_REV01]
D1705  MM3Z3V3ST1G  MM3Z4V7T1G  [D_SMD_SOD323_(SC-76)_R_ON_REV01]
IC1701  ADR3425ARJZ  [IC_SMD_SOT23-6_(MO-178-AB)_R_AD_REV01]
LSP1701  PAD_2.0X1.5MM  [PAD2.0X1.5MM]
LSP1702  PAD_2.0X1.5MM  [PAD2.0X1.5MM]
LSP1703  PAD_2.0X1.5MM  [PAD2.0X1.5MM]
LSP1704  PAD_2.0X1.5MM  [PAD2.0X1.5MM]
LSP1705  PAD_2.0X1.5MM  [PAD2.0X1.5MM]
R1701  0  R_MET_0603  [0603]
R1702  4.75k  R_MET_0603  [0603]
R1703  0  R_MET_0603  [0603]
R1704  4.75k  R_MET_0603  [0603]
R1705  0  R_MET_0603  [0603]
R1706  4.75k  R_MET_0603  [0603]
R1707  0  R_MET_0603  [0603]
R1708  4.75k  R_MET_0603  [0603]
R1709  0  R_MET_0603  [0603]
R1710  4.75k  R_MET_0603  [0603]
X1701  43045-1200_MOLEX_12PIN  [X_TH_MOLEX_43045-1200_R_REV01]

### Nets
+3.3V_0: C1703.1 C1704.1 IC1701.3(ENABLE) IC1701.4(VIN) ; also sheet 8,10,11,13,15,19,20,21,22
ADC_MCU_0_CH_0: C1701.1 D1701.C LSP1701.P$1(MP) R1701.2 R1702.1 ; also sheet 22
ADC_MCU_0_CH_1: C1705.1 D1703.C LSP1704.P$1(MP) R1705.2 R1706.1 ; also sheet 22
ADC_MCU_0_CH_2: C1708.1 D1705.C LSP1705.P$1(MP) R1709.2 R1710.1 ; also sheet 22
ADC_MCU_0_CH_3: C1702.1 D1702.C LSP1702.P$1(MP) R1703.2 R1704.1 ; also sheet 22
ADC_MCU_0_CH_4: C1706.1 D1704.C LSP1703.P$1(MP) R1707.2 R1708.1 ; also sheet 22
ANALOG_IN_CH_0: R1701.1 X1701.2
ANALOG_IN_CH_1: R1705.1 X1701.4
ANALOG_IN_CH_2: R1709.1 X1701.6
ANALOG_IN_CH_3: R1703.1 X1701.8
ANALOG_IN_CH_4: R1707.1 X1701.10
GND_0: C1701.2 C1702.2 C1703.2 C1704.2 C1705.2 C1706.2 C1707.2 C1708.2 D1701.A D1702.A D1703.A D1704.A D1705.A IC1701.1(GND_FORCE) IC1701.2(GND_SENSE) R1702.2 R1704.2 R1706.2 R1708.2 R1710.2 X1701.11 X1701.12 ; also sheet 8,10,11,13,15,19,20,21,22
N$43: C1707.1 IC1701.5(VOUT_SENSE) IC1701.6(VOUT_FORCE) X1701.1 X1701.3 X1701.5 X1701.7 X1701.9

### Notes on the sheet
- Analog reference
- Analog input connector
  (not isolated!)
- Replace if voltage 
  divider is needed
- Replace if voltage 
  divider is needed
- Replace if voltage 
  divider is needed
- Remove for direct
  analog input
- Remove for direct
  analog input
- Remove for direct
  analog input
- Replace if voltage 
  divider is needed
- Replace if voltage 
  divider is needed
- Remove for direct
  analog input
- Remove for direct
  analog input
- Analog Inputs (not isolated)

## Sheet 18 of 22: SDRAM
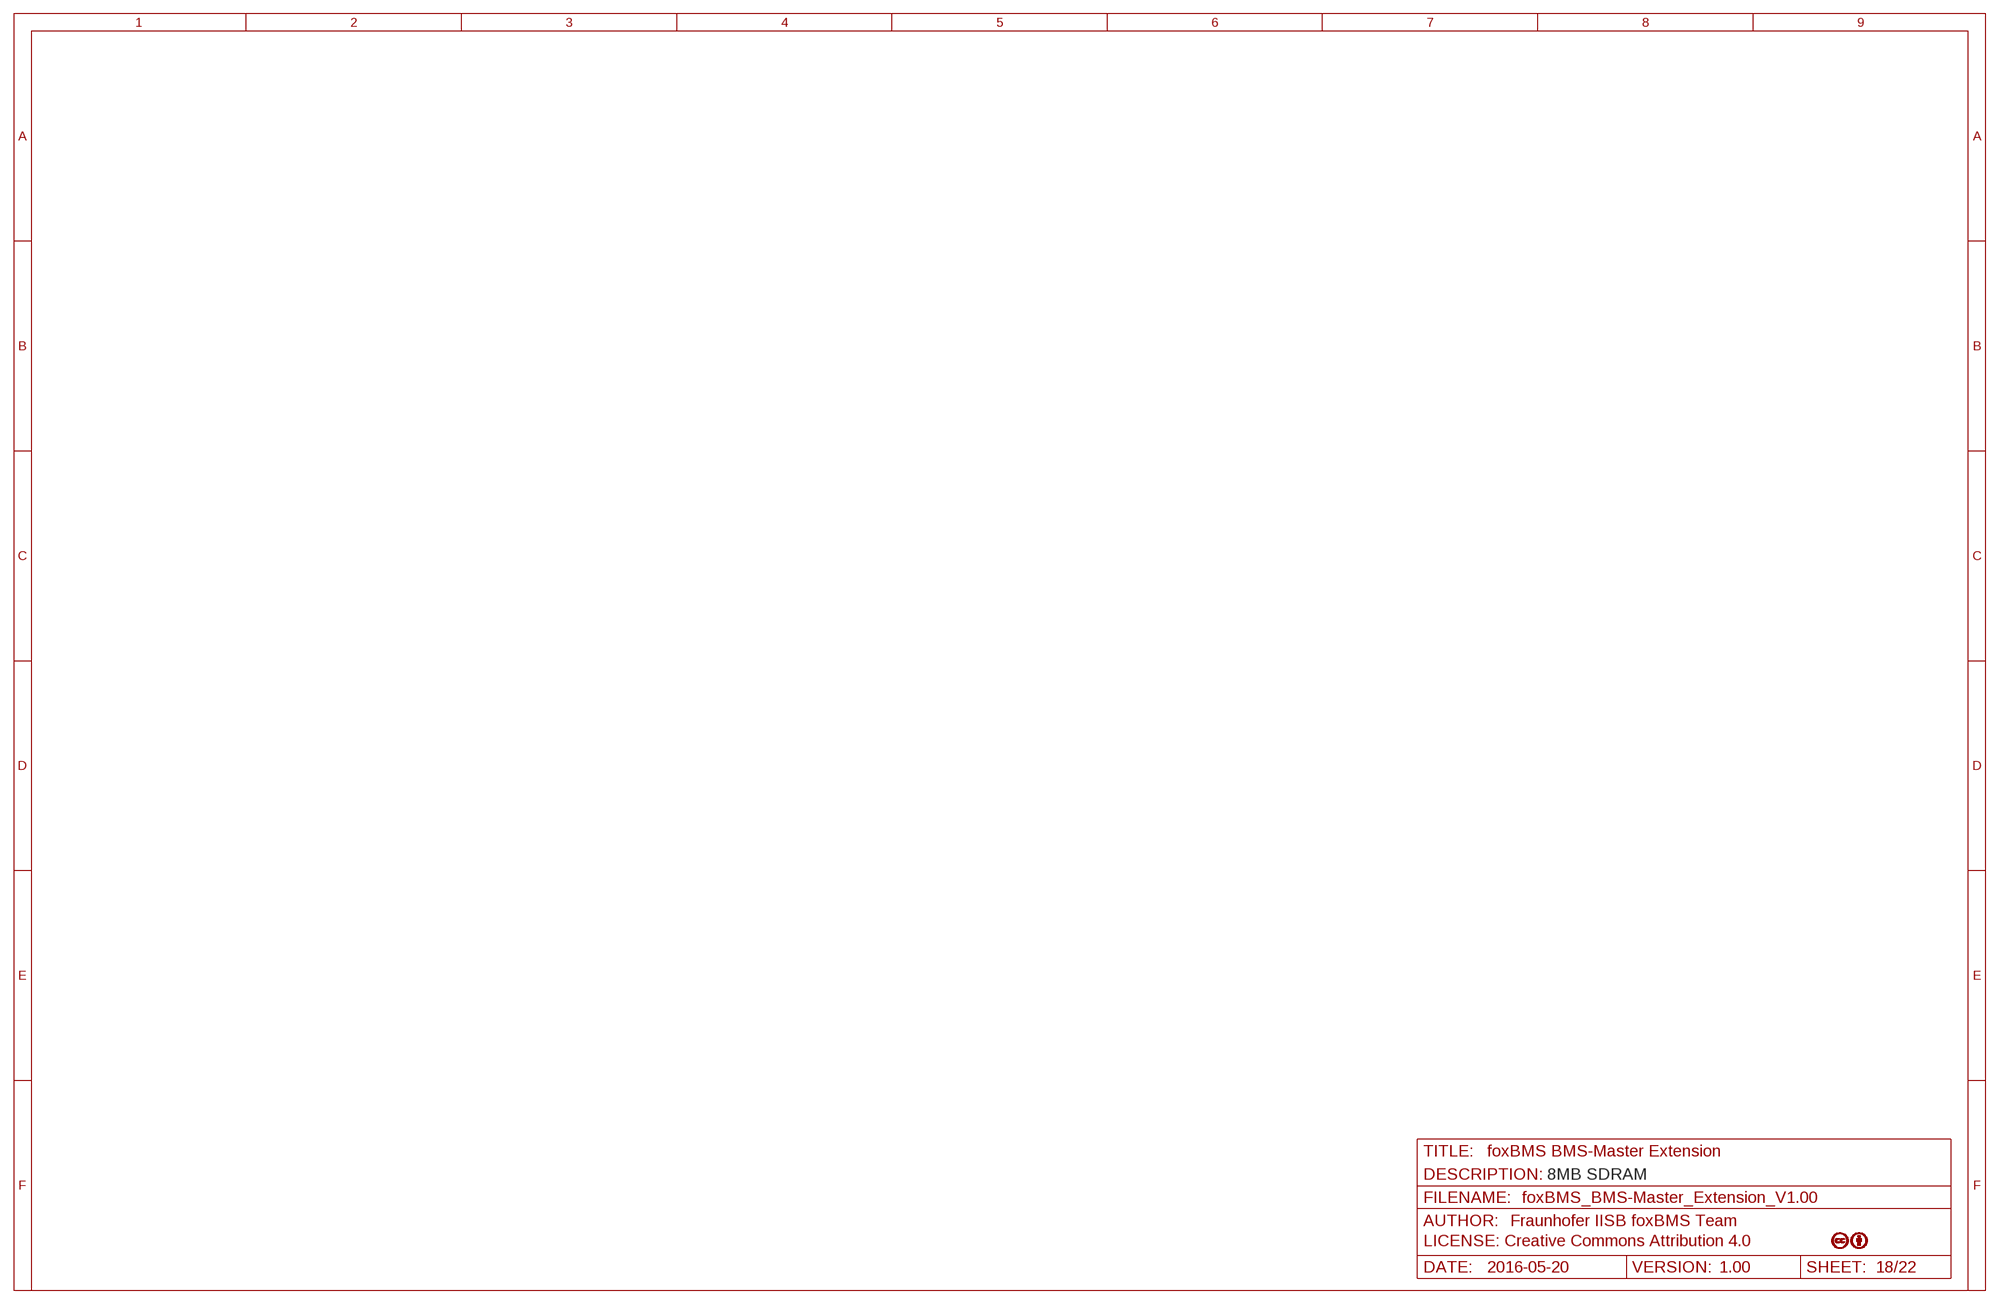
[diagram p17: schematic, sheet 18]

### Notes on the sheet
- 8MB SDRAM

## Sheet 19 of 22: Isolated GPIO MCU_0 Primary
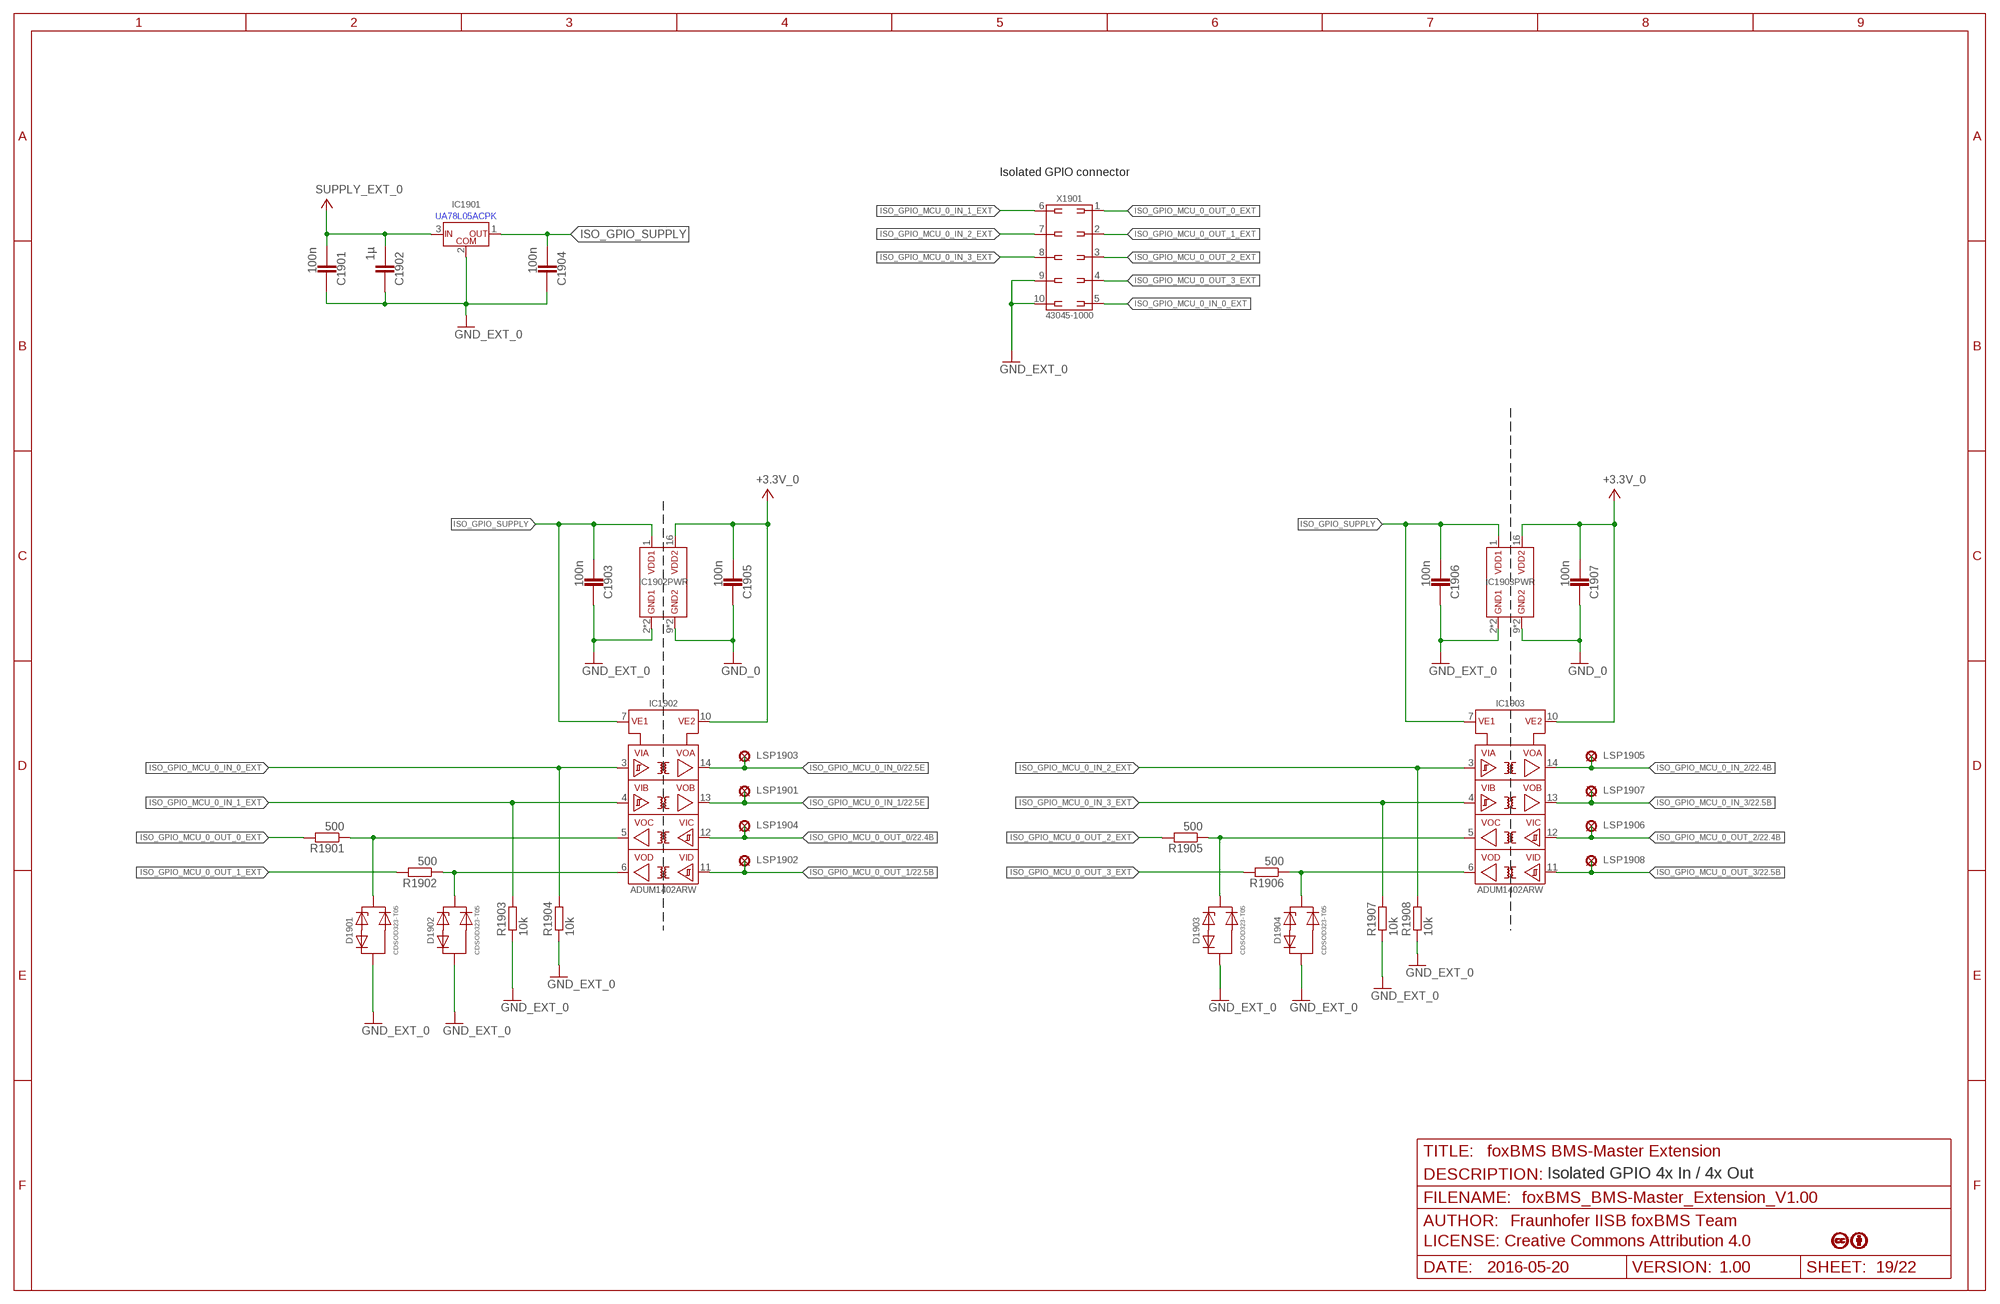
[diagram p18: schematic, sheet 19]

### Parts
C1901  100n  C_X7R_0603  [0603]
C1902  1µ  C_X7R_0603  [0603]
C1903  100n  C_X7R_0603  [0603]
C1904  100n  C_X7R_0603  [0603]
C1905  100n  C_X7R_0603  [0603]
C1906  100n  C_X7R_0603  [0603]
C1907  100n  C_X7R_0603  [0603]
D1901  CDSOD323-T05  [D_SMD_SOD323_(SC-76)_R_BOURNS_REV01]
D1902  CDSOD323-T05  [D_SMD_SOD323_(SC-76)_R_BOURNS_REV01]
D1903  CDSOD323-T05  [D_SMD_SOD323_(SC-76)_R_BOURNS_REV01]
D1904  CDSOD323-T05  [D_SMD_SOD323_(SC-76)_R_BOURNS_REV01]
IC1901  UA78L05ACPK  [IC_SMD_SOT-89_(SC-62/TO-243)_(R-PSSO-F3)_R_TI_REV01]
IC1902  ADUM1402ARW  [IC_SMD_SOIC-16_(JEDEC_MS-013-AA)_R_ANALOG_REV01]
IC1903  ADUM1402ARW  [IC_SMD_SOIC-16_(JEDEC_MS-013-AA)_R_ANALOG_REV01]
LSP1901  PAD_2.0X1.5MM  [PAD2.0X1.5MM]
LSP1902  PAD_2.0X1.5MM  [PAD2.0X1.5MM]
LSP1903  PAD_2.0X1.5MM  [PAD2.0X1.5MM]
LSP1904  PAD_2.0X1.5MM  [PAD2.0X1.5MM]
LSP1905  PAD_2.0X1.5MM  [PAD2.0X1.5MM]
LSP1906  PAD_2.0X1.5MM  [PAD2.0X1.5MM]
LSP1907  PAD_2.0X1.5MM  [PAD2.0X1.5MM]
LSP1908  PAD_2.0X1.5MM  [PAD2.0X1.5MM]
R1901  500  R_MET_0603  [0603]
R1902  500  R_MET_0603  [0603]
R1903  10k  R_MET_0603  [0603]
R1904  10k  R_MET_0603  [0603]
R1905  500  R_MET_0603  [0603]
R1906  500  R_MET_0603  [0603]
R1907  10k  R_MET_0603  [0603]
R1908  10k  R_MET_0603  [0603]
X1901  43045-1000_MOLEX_10PIN  [X_TH_MOLEX_43045-1000_R_REV01]

### Nets
+3.3V_0: C1905.1 C1907.1 IC1902.10(VE2) IC1902.16(VDD2) IC1903.10(VE2) IC1903.16(VDD2) ; also sheet 8,10,11,13,15,17,20,21,22
GND_0: C1905.2 C1907.2 IC1902.9(GND2) IC1902.15(GND2) IC1903.9(GND2) IC1903.15(GND2) ; also sheet 8,10,11,13,15,17,20,21,22
GND_EXT_0 [Power]: C1901.2 C1902.2 C1903.2 C1904.2 C1906.2 D1901.A D1902.A D1903.A D1904.A IC1901.2(COM) IC1902.2(GND1) IC1902.8(GND1) IC1903.2(GND1) IC1903.8(GND1) R1903.1 R1904.1 R1907.1 R1908.1 X1901.9 X1901.10 ; also sheet 9,11,12
ISO_GPIO_MCU_0_IN_0: IC1902.14(VOA) LSP1903.P$1(MP) ; also sheet 22
ISO_GPIO_MCU_0_IN_0_EXT: R1904.2 X1901.5
ISO_GPIO_MCU_0_IN_1: IC1902.13(VOB) LSP1901.P$1(MP) ; also sheet 22
ISO_GPIO_MCU_0_IN_1_EXT: IC1902.4(VIB) R1903.2 X1901.6
ISO_GPIO_MCU_0_IN_2: IC1903.14(VOA) LSP1905.P$1(MP) ; also sheet 22
ISO_GPIO_MCU_0_IN_2_EXT: IC1903.3(VIA) R1908.2 X1901.7
ISO_GPIO_MCU_0_IN_3: IC1903.13(VOB) LSP1907.P$1(MP) ; also sheet 22
ISO_GPIO_MCU_0_IN_3_EXT: IC1903.4(VIB) R1907.2 X1901.8
ISO_GPIO_MCU_0_OUT_0: IC1902.12(VIC) LSP1904.P$1(MP) ; also sheet 22
ISO_GPIO_MCU_0_OUT_0_EXT: R1901.2 X1901.1
ISO_GPIO_MCU_0_OUT_1: IC1902.11(VID) LSP1902.P$1(MP) ; also sheet 22
ISO_GPIO_MCU_0_OUT_1_EXT: R1902.2 X1901.2
ISO_GPIO_MCU_0_OUT_2: IC1903.12(VIC) LSP1906.P$1(MP) ; also sheet 22
ISO_GPIO_MCU_0_OUT_2_EXT: R1905.2 X1901.3
ISO_GPIO_MCU_0_OUT_3: IC1903.11(VID) LSP1908.P$1(MP) ; also sheet 22
ISO_GPIO_MCU_0_OUT_3_EXT: R1906.2 X1901.4
ISO_GPIO_SUPPLY: C1903.1 C1904.1 C1906.1 IC1901.1(OUT) IC1902.1(VDD1) IC1902.7(VE1) IC1903.1(VDD1) IC1903.7(VE1)
N$24: D1901.C IC1902.5(VOC) R1901.1
N$25: D1902.C IC1902.6(VOD) R1902.1
N$26: D1903.C IC1903.5(VOC) R1905.1
N$27: D1904.C IC1903.6(VOD) R1906.1
SUPPLY_EXT_0: C1901.1 C1902.1 IC1901.3(IN) ; also sheet 9,11
Unconnected: IC1902.3(VIA)

### Notes on the sheet
- Isolated GPIO connector
- Isolated GPIO 4x In / 4x Out

## Sheet 20 of 22: Isolated Normally Open Contacts
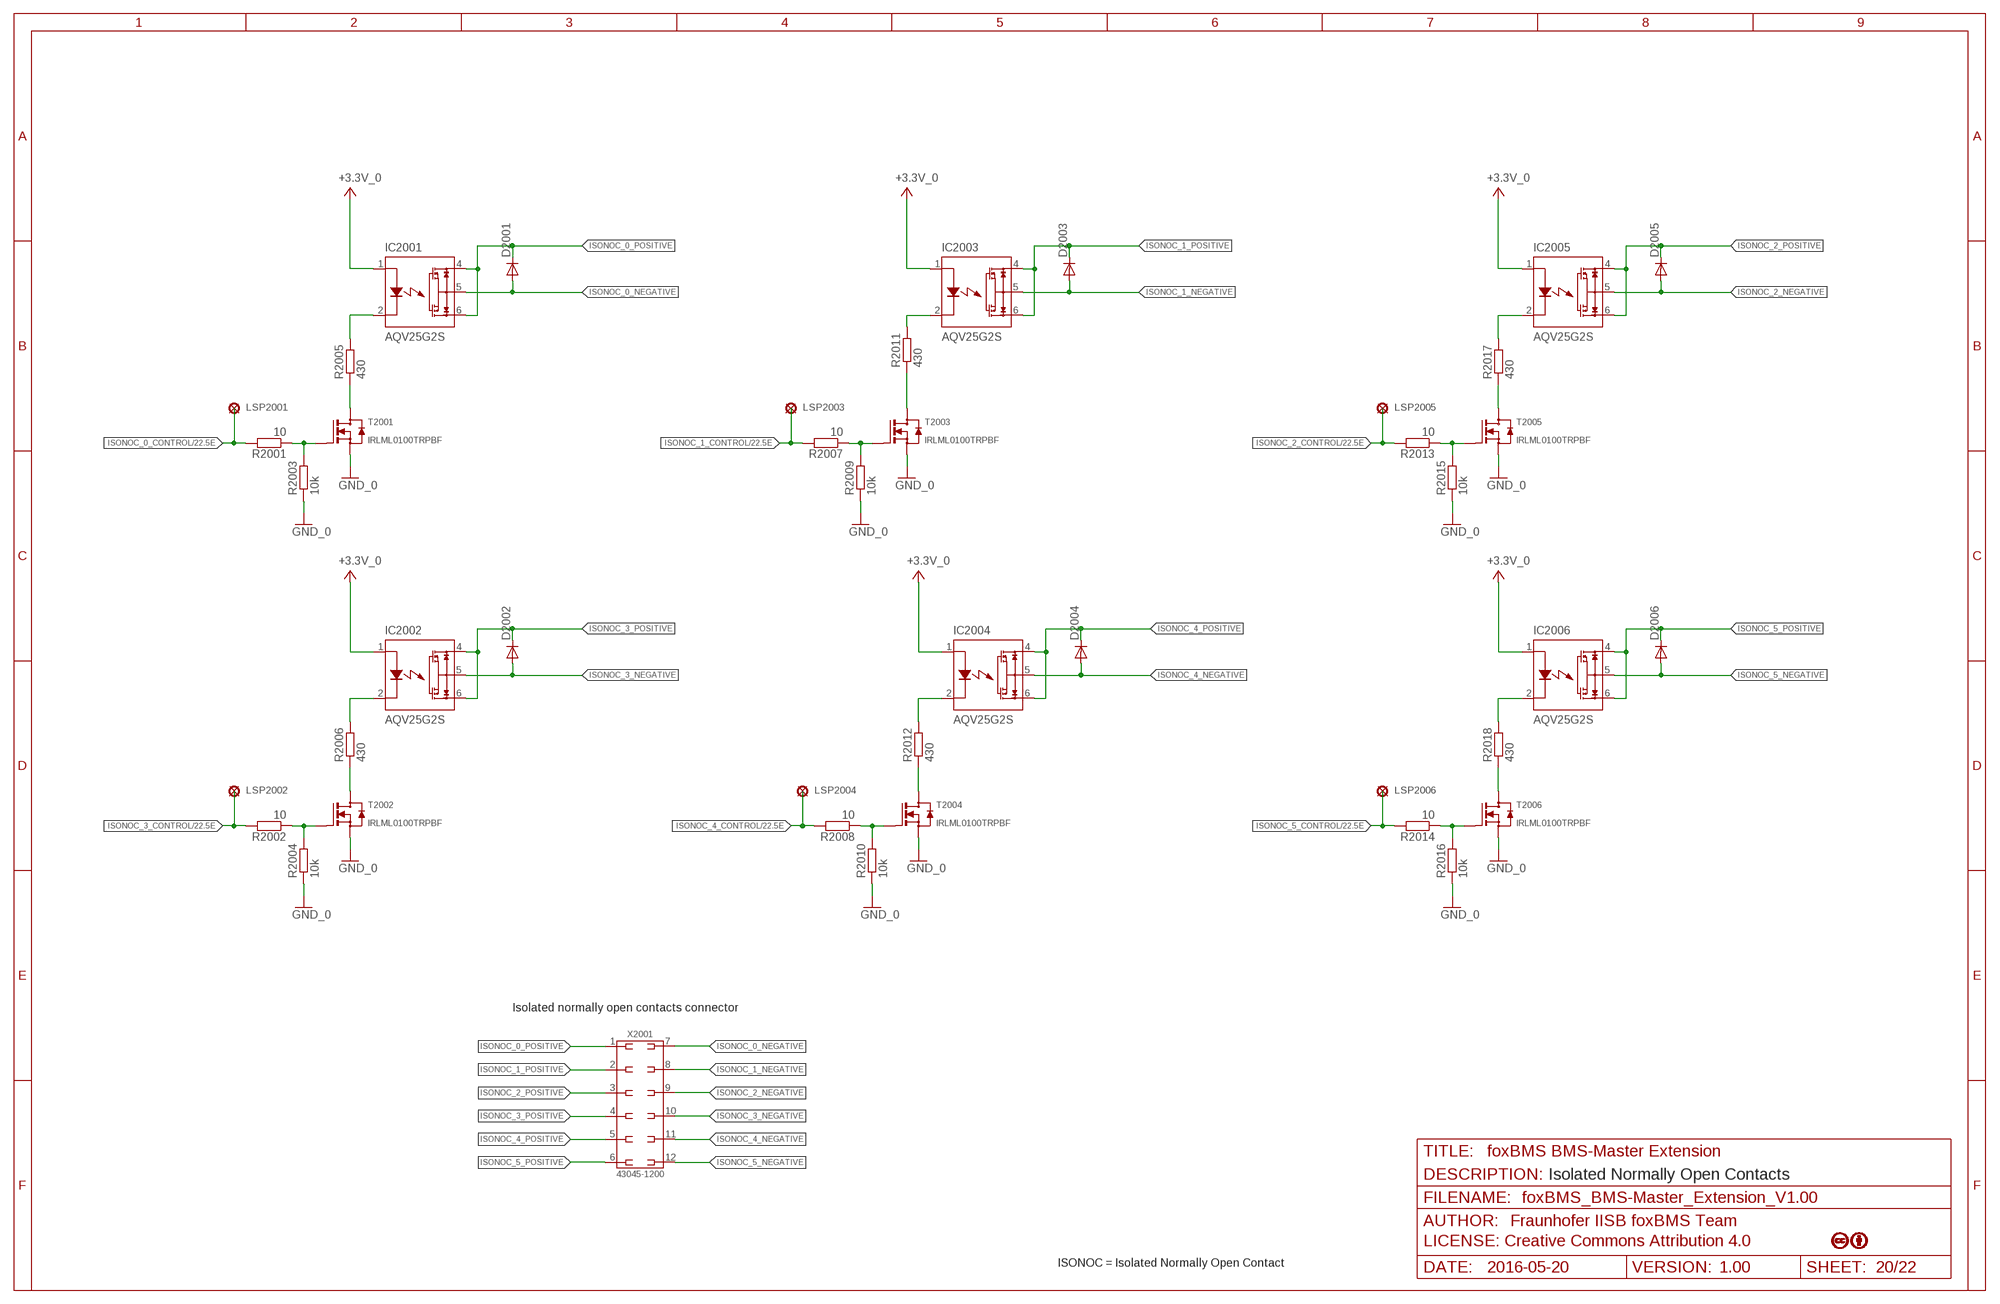
[diagram p19: schematic, sheet 20]

### Parts
D2001  DIODE-DO214BA  [DO214BA]
D2002  DIODE-DO214BA  [DO214BA]
D2003  DIODE-DO214BA  [DO214BA]
D2004  DIODE-DO214BA  [DO214BA]
D2005  DIODE-DO214BA  [DO214BA]
D2006  DIODE-DO214BA  [DO214BA]
IC2001  AQV25G2S  [SOP06]
IC2002  AQV25G2S  [SOP06]
IC2003  AQV25G2S  [SOP06]
IC2004  AQV25G2S  [SOP06]
IC2005  AQV25G2S  [SOP06]
IC2006  AQV25G2S  [SOP06]
LSP2001  PAD_2.0X1.5MM  [PAD2.0X1.5MM]
LSP2002  PAD_2.0X1.5MM  [PAD2.0X1.5MM]
LSP2003  PAD_2.0X1.5MM  [PAD2.0X1.5MM]
LSP2004  PAD_2.0X1.5MM  [PAD2.0X1.5MM]
LSP2005  PAD_2.0X1.5MM  [PAD2.0X1.5MM]
LSP2006  PAD_2.0X1.5MM  [PAD2.0X1.5MM]
R2001  10  R_MET_0603  [0603]
R2002  10  R_MET_0603  [0603]
R2003  10k  R_MET_0603  [0603]
R2004  10k  R_MET_0603  [0603]
R2005  430  R_MET_0603  [0603]
R2006  430  R_MET_0603  [0603]
R2007  10  R_MET_0603  [0603]
R2008  10  R_MET_0603  [0603]
R2009  10k  R_MET_0603  [0603]
R2010  10k  R_MET_0603  [0603]
R2011  430  R_MET_0603  [0603]
R2012  430  R_MET_0603  [0603]
R2013  10  R_MET_0603  [0603]
R2014  10  R_MET_0603  [0603]
R2015  10k  R_MET_0603  [0603]
R2016  10k  R_MET_0603  [0603]
R2017  430  R_MET_0603  [0603]
R2018  430  R_MET_0603  [0603]
T2001  IRLML0100TRPBF  [V_SMD_SOT-23_(TO-236AB)_R_IR_REV01]
T2002  IRLML0100TRPBF  [V_SMD_SOT-23_(TO-236AB)_R_IR_REV01]
T2003  IRLML0100TRPBF  [V_SMD_SOT-23_(TO-236AB)_R_IR_REV01]
T2004  IRLML0100TRPBF  [V_SMD_SOT-23_(TO-236AB)_R_IR_REV01]
T2005  IRLML0100TRPBF  [V_SMD_SOT-23_(TO-236AB)_R_IR_REV01]
T2006  IRLML0100TRPBF  [V_SMD_SOT-23_(TO-236AB)_R_IR_REV01]
X2001  43045-1200_MOLEX_12PIN  [X_TH_MOLEX_43045-1200_R_REV01]

### Nets
+3.3V_0: IC2001.1(A) IC2002.1(A) IC2003.1(A) IC2004.1(A) IC2005.1(A) IC2006.1(A) ; also sheet 8,10,11,13,15,17,19,21,22
GND_0: R2003.1 R2004.1 R2009.1 R2010.1 R2015.1 R2016.1 T2001.2(S) T2002.2(S) T2003.2(S) T2004.2(S) T2005.2(S) T2006.2(S) ; also sheet 8,10,11,13,15,17,19,21,22
ISONOC_0_CONTROL: LSP2001.P$1(MP) R2001.2 ; also sheet 22
ISONOC_0_NEGATIVE: D2001.A IC2001.5(S) X2001.7
ISONOC_0_POSITIVE: D2001.C IC2001.4(D1) IC2001.6(D2) X2001.1
ISONOC_1_CONTROL: LSP2003.P$1(MP) R2007.2 ; also sheet 22
ISONOC_1_NEGATIVE: D2003.A IC2003.5(S) X2001.8
ISONOC_1_POSITIVE: D2003.C IC2003.4(D1) IC2003.6(D2) X2001.2
ISONOC_2_CONTROL: LSP2005.P$1(MP) R2013.2 ; also sheet 22
ISONOC_2_NEGATIVE: D2005.A IC2005.5(S) X2001.9
ISONOC_2_POSITIVE: D2005.C IC2005.4(D1) IC2005.6(D2) X2001.3
ISONOC_3_CONTROL: LSP2002.P$1(MP) R2002.2 ; also sheet 22
ISONOC_3_NEGATIVE: D2002.A IC2002.5(S) X2001.10
ISONOC_3_POSITIVE: D2002.C IC2002.4(D1) IC2002.6(D2) X2001.4
ISONOC_4_CONTROL: LSP2004.P$1(MP) R2008.2 ; also sheet 22
ISONOC_4_NEGATIVE: D2004.A IC2004.5(S) X2001.11
ISONOC_4_POSITIVE: D2004.C IC2004.4(D1) IC2004.6(D2) X2001.5
ISONOC_5_CONTROL: LSP2006.P$1(MP) R2014.2 ; also sheet 22
ISONOC_5_NEGATIVE: D2006.A IC2006.5(S) X2001.12
ISONOC_5_POSITIVE: D2006.C IC2006.4(D1) IC2006.6(D2) X2001.6
N$4: R2005.1 T2001.3(D)
N$7: R2011.1 T2003.3(D)
N$8: IC2003.2(K) R2011.2
N$9: R2017.1 T2005.3(D)
N$10: IC2005.2(K) R2017.2
N$11: R2006.1 T2002.3(D)
N$12: IC2002.2(K) R2006.2
N$13: R2012.1 T2004.3(D)
N$14: IC2004.2(K) R2012.2
N$15: R2018.1 T2006.3(D)
N$16: IC2006.2(K) R2018.2
N$122: IC2001.2(K) R2005.2
N$157: R2001.1 R2003.2 T2001.1(G)
N$262: R2007.1 R2009.2 T2003.1(G)
N$296: R2013.1 R2015.2 T2005.1(G)
N$299: R2002.1 R2004.2 T2002.1(G)
N$317: R2008.1 R2010.2 T2004.1(G)
N$320: R2014.1 R2016.2 T2006.1(G)

### Notes on the sheet
- Isolated normally open contacts connector
- Isolated Normally Open Contacts
- ISONOC = Isolated Normally Open Contact

## Sheet 21 of 22: FPGA Board Connector
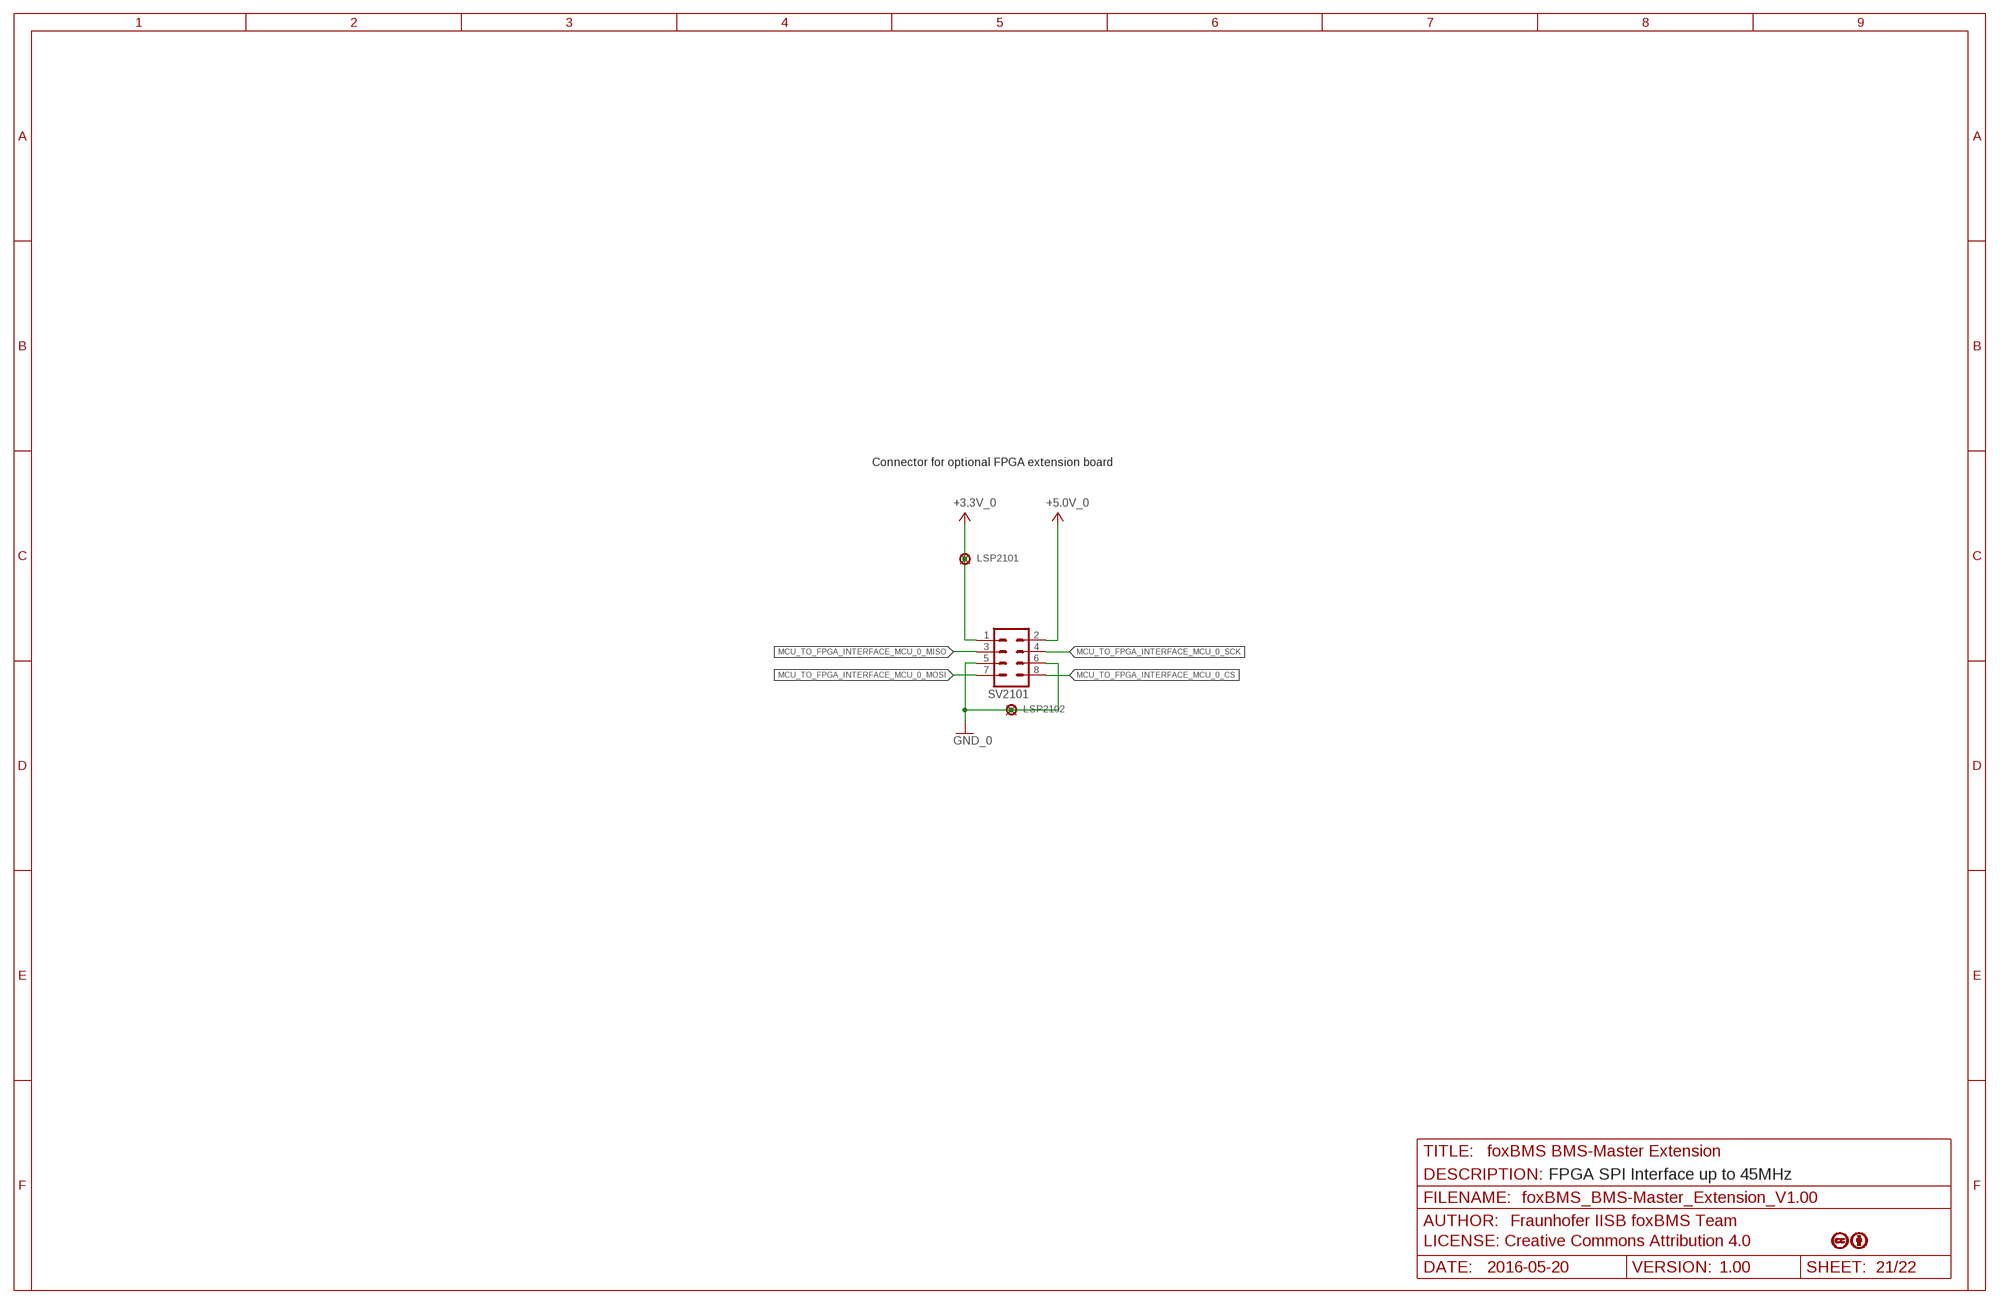
[diagram p20: schematic, sheet 21]

### Parts
LSP2101  PAD_2.0X1.5MM  [PAD2.0X1.5MM]
LSP2102  PAD_2.0X1.5MM  [PAD2.0X1.5MM]
SV2101  MA04-2  [MA04-2]

### Nets
+3.3V_0: LSP2101.P$1(MP) SV2101.1 ; also sheet 8,10,11,13,15,17,19,20,22
+5.0V_0: SV2101.2
GND_0: LSP2102.P$1(MP) SV2101.5 SV2101.6 ; also sheet 8,10,11,13,15,17,19,20,22
MCU_TO_FPGA_INTERFACE_MCU_0_CS: SV2101.8
MCU_TO_FPGA_INTERFACE_MCU_0_MISO: SV2101.3
MCU_TO_FPGA_INTERFACE_MCU_0_MOSI: SV2101.7
MCU_TO_FPGA_INTERFACE_MCU_0_SCK: SV2101.4

### Notes on the sheet
- Connector for optional FPGA extension board
- FPGA SPI Interface up to 45MHz

## Sheet 22 of 22
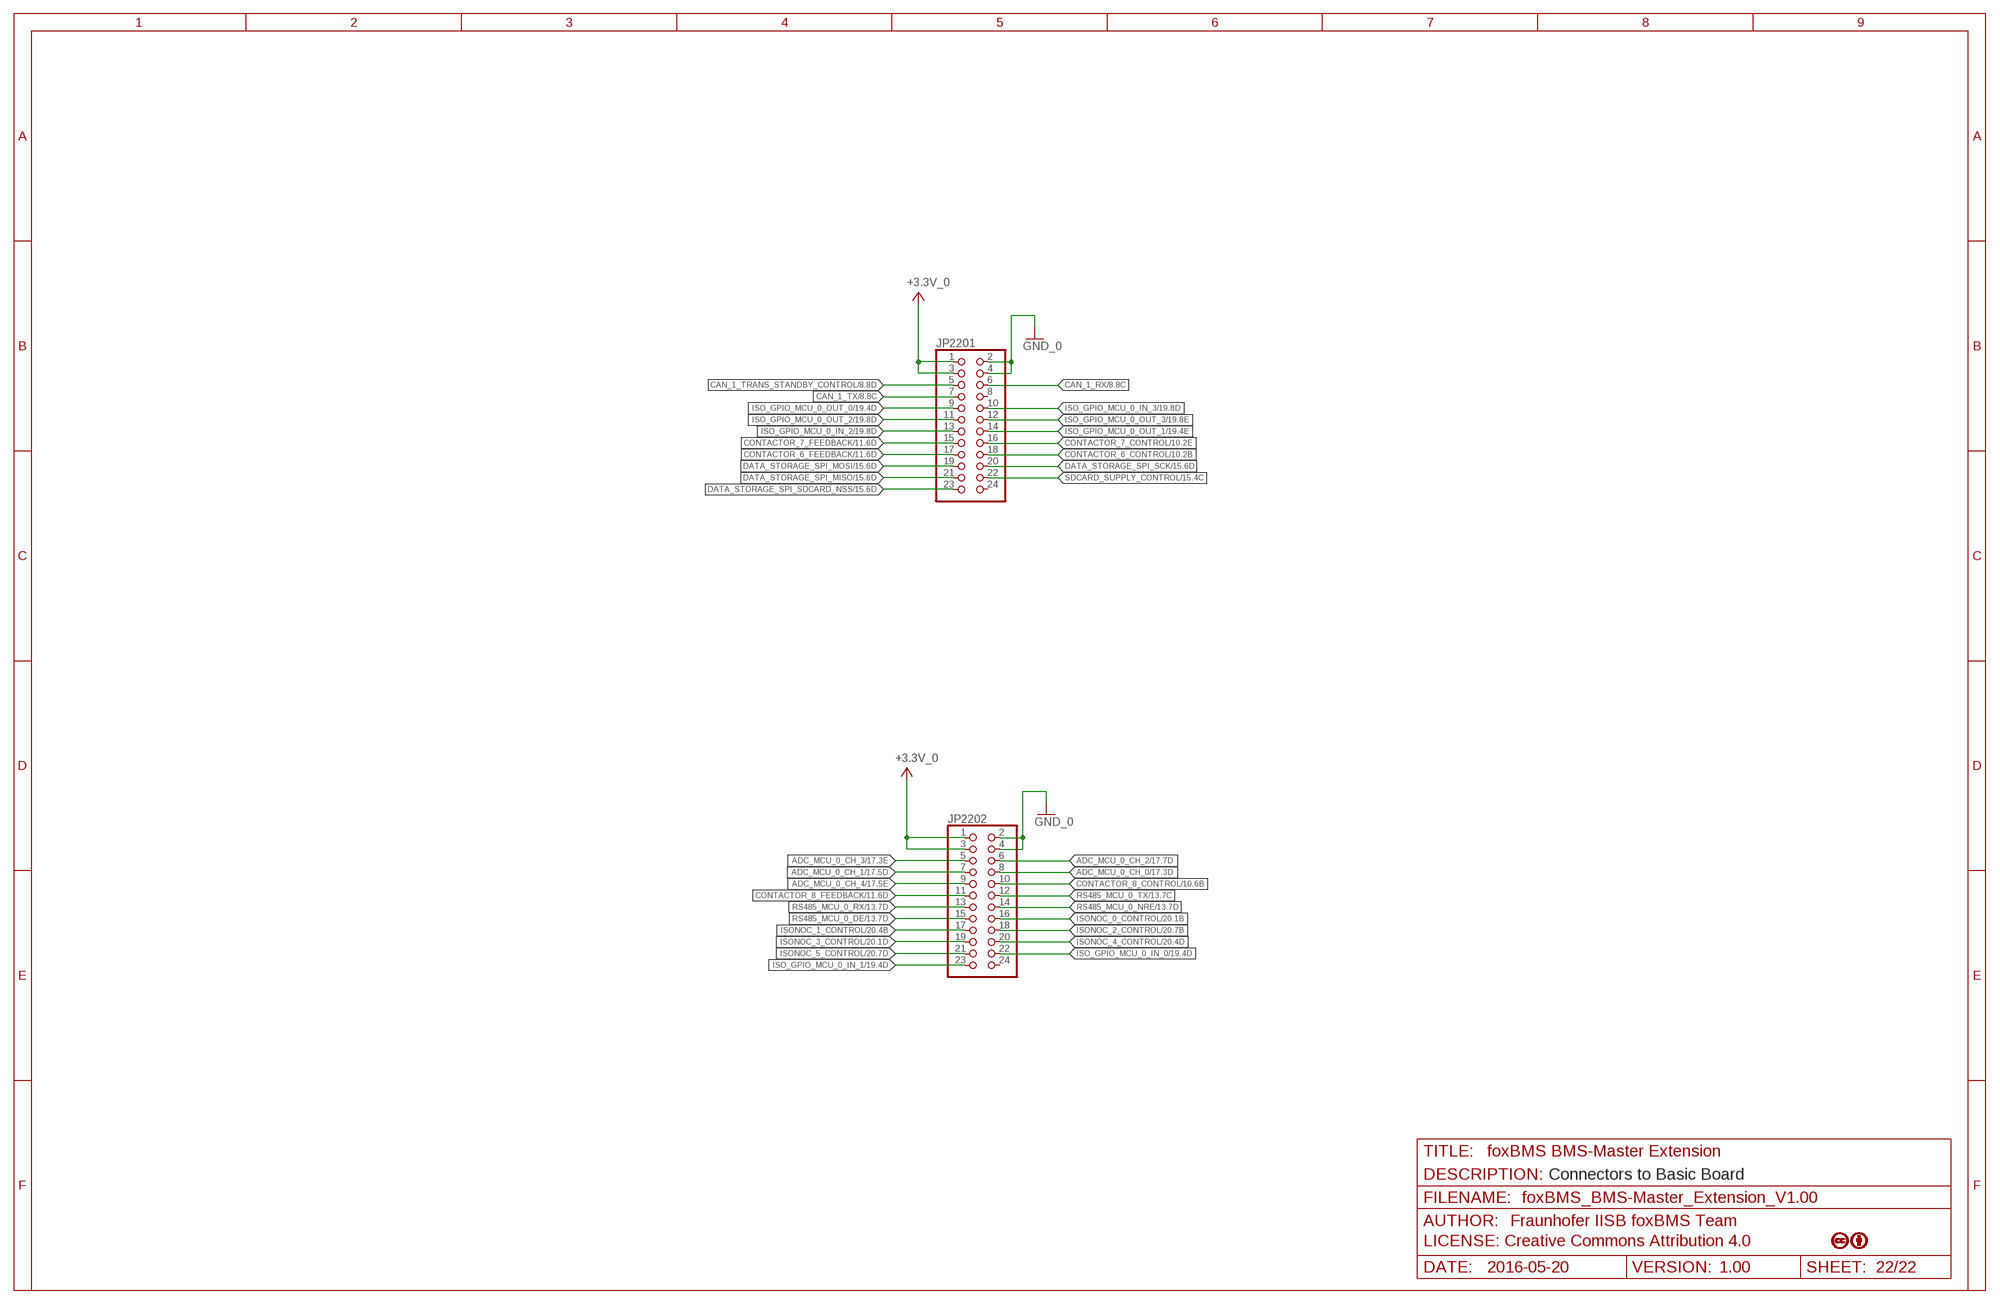
[diagram p21: schematic, sheet 22]

### Parts
JP2201  PINHD-2X12  [2X12]
JP2202  PINHD-2X12  [2X12]

### Nets
+3.3V_0: JP2201.1 JP2201.3 JP2202.1 JP2202.3 ; also sheet 8,10,11,13,15,17,19,20,21
ADC_MCU_0_CH_0: JP2202.8 ; also sheet 17
ADC_MCU_0_CH_1: JP2202.7 ; also sheet 17
ADC_MCU_0_CH_2: JP2202.6 ; also sheet 17
ADC_MCU_0_CH_3: JP2202.5 ; also sheet 17
ADC_MCU_0_CH_4: JP2202.9 ; also sheet 17
CAN_1_RX: JP2201.6 ; also sheet 8
CAN_1_TRANS_STANDBY_CONTROL: JP2201.5 ; also sheet 8
CAN_1_TX: JP2201.7 ; also sheet 8
CONTACTOR_6_CONTROL: JP2201.18 ; also sheet 10
CONTACTOR_6_FEEDBACK: JP2201.17 ; also sheet 11
CONTACTOR_7_CONTROL: JP2201.16 ; also sheet 10
CONTACTOR_7_FEEDBACK: JP2201.15 ; also sheet 11
CONTACTOR_8_CONTROL: JP2202.10 ; also sheet 10
CONTACTOR_8_FEEDBACK: JP2202.11 ; also sheet 11
DATA_STORAGE_SPI_MISO [controller]: JP2201.21 ; also sheet 15
DATA_STORAGE_SPI_MOSI [controller]: JP2201.19 ; also sheet 15
DATA_STORAGE_SPI_SCK [controller]: JP2201.20 ; also sheet 15
DATA_STORAGE_SPI_SDCARD_NSS: JP2201.23 ; also sheet 15
GND_0: JP2201.2 JP2201.4 JP2202.2 JP2202.4 ; also sheet 8,10,11,13,15,17,19,20,21
ISO_GPIO_MCU_0_IN_0: JP2202.22 ; also sheet 19
ISO_GPIO_MCU_0_IN_1: JP2202.23 ; also sheet 19
ISO_GPIO_MCU_0_IN_2: JP2201.13 ; also sheet 19
ISO_GPIO_MCU_0_IN_3: JP2201.10 ; also sheet 19
ISO_GPIO_MCU_0_OUT_0: JP2201.9 ; also sheet 19
ISO_GPIO_MCU_0_OUT_1: JP2201.14 ; also sheet 19
ISO_GPIO_MCU_0_OUT_2: JP2201.11 ; also sheet 19
ISO_GPIO_MCU_0_OUT_3: JP2201.12 ; also sheet 19
ISONOC_0_CONTROL: JP2202.16 ; also sheet 20
ISONOC_1_CONTROL: JP2202.17 ; also sheet 20
ISONOC_2_CONTROL: JP2202.18 ; also sheet 20
ISONOC_3_CONTROL: JP2202.19 ; also sheet 20
ISONOC_4_CONTROL: JP2202.20 ; also sheet 20
ISONOC_5_CONTROL: JP2202.21 ; also sheet 20
RS485_MCU_0_DE: JP2202.15 ; also sheet 13
RS485_MCU_0_NRE: JP2202.14 ; also sheet 13
RS485_MCU_0_RX: JP2202.13 ; also sheet 13
RS485_MCU_0_TX: JP2202.12 ; also sheet 13
SDCARD_SUPPLY_CONTROL: JP2201.22 ; also sheet 15
Unconnected: JP2201.8 JP2201.24 JP2202.24

### Notes on the sheet
- Connectors to Basic Board

## Library data of the parts
C801-C807 C1101-C1106 C1301-C1306 C1501 C1502 C1701-C1708 C1901-C1907 = custom_passiv:C*: Kondensator Bitte gleich beim Einfügen vorgesehenen Werkstoff auswählen. 0402 NP0: #2759 0402 X7R: #1977 0402 Y5V: #2761 0603 X7R: #191 0603 Y5V: #497 0805 NP0: #74 0805 X7R: #104 1206 NP0: #102 1206 X7R: #98 1210 X7R: #114 1812 X7R: #335
D801 = 0_LES_TVS.SMD.ARRAY:PESD: DESD-Serie - NXP PESD1CAN-U: Datasheet www <http://cache.nxp.com/documents/data_sheet/PESD1CAN-U.pdf> Datasheet local <file:///C:\Eagle-Datasheet\TVS\PESD1CAN-U_NXP.pdf> PESD1CAN: Datasheet www <http://cache.nxp.com/documents/data_sheet/PESD1CAN.pdf> Datasheet local <file:///C:\Eagle-Datasheet\TVS\PESD1CAN_NXP.pdf> PESD1FLEX: Datasheet www <http://cache.nxp.com/documents/data_sheet/PESD1FLEX.pdf> Datasheet local <file:///C:\Eagle-Datasheet\TVS\PESD1FLEX_NXP.pdf> PESD1IVN-U: Datasheet www <http://cache.nxp.com/documents/data_sheet/PESD1IVN-U.pdf> Datasheet local <file:///C:\Eagle-Datasheet\TVS\PESD1IVN-U_NXP.pdf> PESD1LIN: Datasheet www <http://cache.nxp.com/documents/data_sheet/PESD1LIN.pdf> Datasheet local <file:///C:\Eagle-Datasheet\TVS\PESD1LIN_NXP.pdf> PESD2CAN: Datasheet www <http://cache.nxp.com/documents/data_sheet/PESD2CAN.pdf> Datasheet local <file:///C:\Eagle-Datasheet\TVS\PESD2CAN_NXP.pdf> PESD2IVN-U: Datasheet www <http://cache.nxp.com/documents/data_sheet/PESD2IVN-U.pdf> Datasheet local <file:///C:\Eagle-Datasheet\TVS\PESD2IVN-U_NXP.pdf> TVS - Protection Diode - One very small SOT323 package to protect two CAN bus lines - Low clamping voltage VCL = 35 V at IPP = 1 A - Typical diode capacitance matching ΔCd/Cd = 0.1 % - ESD protection up to 23 kV; IEC 61000-4-2, level 4 - IEC 61000-4-5 (surge); IPPM = 3 A at tp = 8/20 μs - AEC-Q101 qualified Revision Date changed by Changes ------------------------------------------------------------------------------------------ V1.0 16.12.2015 SC Ersterstellung PESD1CAN-U V1.0 21.04.2016 SC Erstellung PESD1CAN; DISTRI_1: Farnell; DISTRI_1-NR: 1510703; DISTRI_1-PREIS: 0,086€; DISTRI_2: Mouser; DISTRI_2-NR: 771-PESD1CAN-T/R; DISTRI_2-PREIS: 0,416€; HERSTELLER: NXP; HERSTELLER-NR: PESD1CAN; MARKING: *AN; PDF-LOCAL: file:///C:\Eagle-Datasheet\TVS\PESD1CAN_NXP.pdf; SIZE: SOT23; UKAT: I; UTERM: Sn; UTMAX: 150°C; UTMIN: -55°C; UTYP: ESD Protection; UVAL: PESD1CAN; UVCC_MAX: 70,0V
D1001-D1003 D2001-D2006 = diode:DIODE-: DIODE
D1101-D1103 D1901-D1904 = 0_LES_TVS.SMD.ARRAY:CDSOD323-T*?: CDSOD323-TxxX - Bourns (unidirectional) Datasheet www <http://www.bourns.com/docs/Product-Datasheets/CDSOD323-TxxC.pdf?sfvrsn=0> Datasheet local <file:///C:/Eagle-Datasheet/TVS/CDSOD323-TxxC_Bourns.pdf> Transient Voltage Suppressor Array diodes - Case: SOD323 - RoHS compliant* - Protects one line or one I/O port - Bidirectional configuration - ESD protection 30 kV max. - Low capacitance: ~3 pF typical - Replaces 0805 MLV devices Revision Date changed by Changes ------------------------------------------------------------------------------------------ V1.0 02.05.2016 SC Ersterstellung; HERSTELLER: BOURNS; HERSTELLER-NR: CDSOD323-T05; MARKING: 5; PDF-LOCAL: file:///C:/Eagle-Datasheet/TVS/CDSOD323-TxxC_Bourns.pdf; SIZE: SOD323 (SC-76); UID: 5,00uA; UKAT: I; UTERM: Sn; UTMAX: 150°C; UTMIN: -55°C; UTYP: TVS; UVAL: CDSOD323-T05; UVBR: 6,00V; UVCC: 5,00V
D1701-D1705 = 0_LES_DIODE.SMD.ZENER:MM3Z*?: MMS3ZxxxT1G Serie - ON Semiconductor Datasheet www <http://www.onsemi.com/pub_link/Collateral/MM3Z2V4T1-D.PDF> Datasheet local <file:///C:\Eagle-Datasheet\Dioden\MM3ZxxxT1-D_OnSemiconductor.pdf> Zener Voltage Regulator - 300 mW Rating - Wide Zener Reverse Voltage Range − 2.4 V to 75 V - Package Designed for Optimal Automated Board Assembly - Small Package Size for High Density Applications - ESD Rating of Class 3 (> 16 kV) per Human Body Model) - SOD-323 thermosetting molded plastic package Revision Date changed by Changes ------------------------------------------------------------------------------------------ V1.0 21.04.2016 SC Ersterstellung; HERSTELLER: On Semiconductor; HERSTELLER-NR: MM3Z4V7T1G; MARKING: 09; PDF-LOCAL: file:///C:\Eagle-Datasheet\Dioden\MM3ZxxxT1-D_OnSemiconductor.pdf; SIZE: SOD-323; UIR: 3,00µA; UKAT: I; UPV: 300mW; UTERM: Sn; UTMAX: 150°C; UTMIN: -65°C; UTOL: 5%; UVAL: MM3Z4V7T1G
F1001-F1003 = 0_LES_SICHERUNG.SMD:*_UMT: UMT-Serie - Schurter Electronic Components Datasheet www <http://www.schurter.de/var/schurter/storage/ilcatalogue/files/document/datasheet/de/pdf/typ_UMT_250.pdf> Datasheet local <file:///C:\Eagle-Datasheet\Sicherungen\UMT_250_Schurter.pdf> Nicht Rückstellende Sicherung - 2-Pin OMT (11,00mm x 3,00mm x 3,00mm) Package - Nennspannung: 125 - 250VAC, 125 VDC - Nennstrom: 0.08 - 10A - Ausschaltvermögen: 35A - 200A - Charakteristik: Träge T - Montage: Leiterplatte,SMT - Zulässige Umgebungstemp: -55°C bis 125°C - Klimakategorie: 55/125/21 gemäss IEC 60068-1 - Material: Gehäuse Keramik - Material: Anschlüsse Kupferlegierung, verzinnt Revision Date changed by Changes ------------------------------------------------------------------------------------------ V1.0 20.01.2016 SC Ersterstellung; DISTRI_1: Reichelt; DISTRI_1-NR: UMT 0,63A; DISTRI_1-PREIS: 0,37€; DISTRI_2: Mouser; DISTRI_2-NR: 693-3403.0164.11; DISTRI_2-PREIS: 0,531€; HERSTELLER: Schurter; HERSTELLER-NR: 3403.0164.11; MARKING: T - 0,63A / AC 250V; PDF-LOCAL: file:///C:\Eagle-Datasheet\Sicherungen\UMT_250_Schurter.pdf; SIZE: 11,00mm x 3,00mm x 3,00mm; UIS_AC: 200A; UIS_DC: 200A; UKAT: I; UMAT: Keramik; UPV: 500mW; UTERM: Sn; UTMAX: 125°C; UTMIN: -55°C; UTOL: T; UTYP: Thin Film; UVAC: 250V; UVAL: 630mA; UVDC: 125V
IC801 = 0_LES_SPANNUNGSREGLER.SMD.LINEAR.EINZEL:KA78*E: KA78xx - Fairchild Semiconductor Datasheet www <https://www.fairchildsemi.com/datasheets/KA/KA7805E.pdf> Datasheet local <file:///C:\Eagle-Datasheet\Spannungsregler\KA7805E_Fairchild.pdf> 3-Terminal 1A Positive Voltage Regulator - TO-220 / D-PAK - Package - Output current up to 1A - Output voltages of 5, 6, 8, 9, 12, 15, 18, 24V - Thermal overload protection - Short circuit protection - Output transistor safe operating area protection Revision Date changed by Changes ------------------------------------------------------------------------------------------ V1.0 30.11.2015 SC Ersterstellung; DISTRI_1: Farnell; DISTRI_1-NR: 2102585; DISTRI_1-PREIS: 0,3158€; DISTRI_2: Mouser; DISTRI_2-NR: 512-KA7805ERTF; DISTRI_2-PREIS: 0,704€; HERSTELLER: Fairchild Semiconductor; HERSTELLER-NR: KA7805ERTF; MARKING: KA7805E; PDF-LOCAL: file:///C:\Eagle-Datasheet\Spannungsregler\KA7805E_Fairchild.pdf; SIZE: TO-252 (D-PAK); UIOUT: 1,00A; UKAT: I; UTERM: Sn; UTMAX: 125°C; UTMIN: -40°C; UTYP: LDO-VTrack; UVAL: KA7805ERTF; UVCC_MAX: 35,0V; UVCC_MIN: 11,5V; UVOUT: 5,00V
IC802 = 0_LES_RELAIS.SMD:CPC1008N: CPC1008N - IXYS Datasheet www <http://www.ixysic.com/home/pdfs.nsf/www/CPC1008N.pdf/$file/CPC1008N.pdf> Datasheet local <file:///C:\Eagle-Datasheet\Relais\CPC1008N_IXYS.pdf> Single-Pole, Normally Open - OptoMOS® Relay - SOP-4 - Package - 1500Vrms Input/Output Isolation - Small 4-Pin SOP Package - Low Drive Power Requirements - High Reliability - Arc-Free With No Snubbing Circuits - No EMI/RFI Generation - Wave Solderable - Tape & Reel Version Available Revision Date changed by Changes ------------------------------------------------------------------------------------------ V1.0 01.12.2015 SC Ersterstellung; DISTRI_1: Farnell; DISTRI_1-NR: 2435796; DISTRI_1-PREIS: 1,09€; DISTRI_2: Mouser; DISTRI_2-NR: 926-LM1085ISXADJNOPB; DISTRI_2-PREIS: 1,89€; HERSTELLER: IXYS; HERSTELLER-NR: CPC1008N; MARKING: CPC1008N; PDF-LOCAL: file:///C:\Eagle-Datasheet\Relais\CPC1008N_IXYS.pdf; SIZE: SOP-4; UKAT: I; UPV: 400mW; URISO: 1,50kV; UTERM: Sn; UTMAX: 85°C; UTMIN: -40°C; UTYP: LDO-VTrack; UVAL: CPC1008N
IC803 = 0_LES_SCHNITTSTELLEN-IC.SMD.CAN-TRANSCEIVER:TJA1052: TJA1052IT/5Y - NXP Datasheet www <http://www.nxp.com/documents/data_sheet/TJA1052I.pdf> Datasheet local <file:///C:\Eagle-Datasheet\Schnittstellen-IC\TJA1052I_NXP.pdf> Schnittstellen-IC - CAN-Treiber - Isolator and Transceiver integrated into a single SO16 package, reducing board space - Flawless cooperation between the Isolator and the Transceiver - Fewer components improves reliability in applications - Guaranteed performance (eg. max loop delay <220 ns) - Electrical transient immunity of 45 kV/µs (typ) - ISO 11898-2 compliant - Up to 5 kV (RMS) rated isolation - Three versions available (1 kV, 2.5 kV and 5 kV) - Voltage compliant with UL 1577 (pending), IEC 61010 and IEC 60950 - 5 kV (RMS) rated isolation voltage compliant with UL 1577, IEC 61010 and IEC 60950 - Supports ISO6469 ‘Electrically propelled road vehicles. Safety specifications.’ - High ESD handling capability on the bus pins - Bus pins protected against transients in automotive environments - Transmit Data (TXD) dominant time-out function - Undervoltage detection on supply pins Revision Date changed by Changes ------------------------------------------------------------------------------------------ V1.0 03.12.2015 SC Ersterstellung; DISTRI_1: Digi-Key; DISTRI_1-NR: TJA1052IT/1Y-ND; DISTRI_1-PREIS: 3,66€; DISTRI_2: Mouser; DISTRI_2-NR: 771-TJA1052IT/1Y; DISTRI_2-PREIS: 4,86€; HERSTELLER: NXP; HERSTELLER-NR: TJA1052IT/1Y; MARKING: TJA1052IT/1Y; PDF-LOCAL: file:///C:\Eagle-Datasheet\Schnittstellen-IC\TJA1052I_NXP.pdf; SIZE: SO-16; UKAT: I; UTERM: Sn; UTMAX: 125°C; UTMIN: -55°C; UTYP: CAN Transceiver; UVAL: TJA1052IT/1Y; UVCC_MAX: 5,25V; UVCC_MIN: 3,00V
IC1001-IC1003 = 0_LES_RELAIS.SMD:AQV25*?: AQV25 Serie - Panasonic Datasheet www <https://www.panasonic-electric-works.com/cps/rde/xbcr/pew_eu_en/ds_x615_en_aqv25_g_s.pdf> Datasheet local <file:///C:\Eagle-Datasheet\Relais\AQV252G2_Panasonic.pdf> Miniature SOP6-pin type with high capacity of 3A load current - SOP-6 - Package - High capacity in a miniature SOP package Continuous load current: Max. 3A Load voltage: 50V and 80V - Greatly improved specifications allow you to use this in place of mercury and mechanical relays. Revision Date changed by Changes ------------------------------------------------------------------------------------------ V1.0 21.04.2016 SC Ersterstellung; DISTRI_1: Digi-Key; DISTRI_1-NR: 255-3594-1-ND; DISTRI_1-PREIS: 7,94€; DISTRI_2: Mouser; DISTRI_2-NR: 769-AQV252G2SX; DISTRI_2-PREIS: 10,20€; HERSTELLER: Panasonic; HERSTELLER-NR: AQV252G2S; MARKING: AQV252G2S; PDF-LOCAL: file:///C:\Eagle-Datasheet\Relais\AQV252G2_Panasonic.pdf; SIZE: SOP-6; UIF: 50,0mA; UIL: 3,00A; UKAT: I; UPV: 500mW; URISO: 1,50kV; UTERM: Sn; UTMAX: 85°C; UTMIN: -40°C; UTYP: Relay; UVAL: AQV252G2S; UVL: 50,0V
IC1101 IC1301 IC1901 = 0_LES_SPANNUNGSREGLER.SMD.LINEAR.EINZEL:UA78L*?: UA78Lxx - Fairchild Semiconductor Datasheet www <http://www.ti.com/lit/ds/symlink/ua78l05.pdf> Datasheet local <file:///C:\Eagle-Datasheet\Spannungsregler\UA78L00_Texas_Instruments.pdf> μA78L00 Series Positive-Voltage Regulators - TO-220 / D-PAK - Package - 3-Terminal Regulators - Output Current up to 100 mA - No External Components - Internal Thermal-Overload Protection - Internal Short-Circuit Current Limiting Revision Date changed by Changes ------------------------------------------------------------------------------------------ V1.0 01.12.2015 SC Ersterstellung; DISTRI_1: Farnell; DISTRI_1-NR: 2437928; DISTRI_1-PREIS: 0,3158€; DISTRI_2: Mouser; DISTRI_2-NR: 595-UA78L05ACPK; DISTRI_2-PREIS: 0,507; HERSTELLER: Texas Instruments; HERSTELLER-NR: UA78L05ACPK; MARKING: UA78L05AC; PDF-LOCAL: file:///C:\Eagle-Datasheet\Spannungsregler\UA78L00_Texas_Instruments.pdf; SIZE: SOT-89; UIOUT: 100mA; UKAT: I; UTERM: Sn; UTMAX: 125°C; UTMIN: -40°C; UTYP: LDO-VTrack; UVAL: UA78L05ACPK; UVCC_MAX: 20,0V; UVCC_MIN: 7,00V; UVOUT: 5,00V
IC1102 = 0_LES_SCHNITTSTELLEN-IC.SMD.ISOLATOR:ADUM1300: ADUM1300 - Analog Devices Datasheet www <http://www.analog.com/media/en/technical-documentation/data-sheets/ADuM1300_1301.pdf> Datasheet local <file:///C:\Eagle-Datasheet\Schnittstellen-IC\ADuM1300_1301_Linear.pdf> Triple-Channel Digital Isolator - Qualified for automotive applications - Low power operation - 5 V operation: - 1.2 mA per channel maximum at 0 Mbps to 2 Mbps - 3.5 mA per channel maximum at 10 Mbps - 32 mA per channel maximum at 90 Mbps - 3 V operation: - 0.8 mA per channel maximum at 0 Mbps to 2 Mbps - 2.2 mA per channel maximum at 10 Mbps - 20 mA per channel maximum at 90 Mbps - Bidirectional communication - 3 V/5 V level translation - High temperature operation: 125°C - High data rate: dc to 90 Mbps (NRZ) - Precise timing characteristics: - 2 ns maximum pulse width distortion - 2 ns maximum channel-to-channel matching - High common-mode transient immunity: >25 kV/μs - Output enable function - 16-lead SOIC wide body package Revision Date changed by Changes ------------------------------------------------------------------------------------------ V1.0 27.10.2015 SC Ersterstellung; DISTRI_1: Digi-Key; DISTRI_1-NR: ADUM1300ARW-ND; DISTRI_1-PREIS: 3,58€; HERSTELLER: Analog Devices; HERSTELLER-NR: ADUM1300ARW; MARKING: ADUM1300ARW; PDF-LOCAL: file:///C:\Eagle-Datasheet\Schnittstellen-IC\ADuM1300_1301_Linear.pdf; SIZE: SOIC-16; UDR: 1,00Mbps; UDT: 100ns; UKAT: I; UPWV: 40,0ns; UTERM: Sn; UTMAX: 105°C; UTMIN: -40°C; UTYP: Digital Isolator; UVAL: ADUM1300ARW; UVDD_MAX: 5,50V; UVDD_MIN: 2,70V
IC1302 = 0_LES_SCHNITTSTELLEN-IC.SMD.RS485-TRANSCEIVER:LTC485: LTC485-Serie - Linear Technology Datasheet www <http://cds.linear.com/docs/en/datasheet/485fk.pdf> Datasheet local <file:///C:\Eagle-Datasheet\Schnittstellen-IC\LTC485_Linear.pdf> Schnittstellen-IC - RS-485-Treiber - Low Power: ICC = 300μA Typ - Designed for RS485 Interface Applications - Single 5V Supply - –7V to 12V Bus Common Mode Range Permits ±7V Ground Difference Between Devices on the Bus - Thermal Shutdown Protection - Power-Up/Down Glitch-Free Driver Outputs Permit Live Insertion or Removal of Transceive r - Driver Maintains High Impedance in Three-State or with the Power Off - Combined Impedance of a Driver Output and Receiver Allows Up to 32 Transceivers on the Bus (C- and I-Grades) - 70mV Typical Input Hysteresis - 30ns Typical Driver Propagation Delays with 5ns Skew for Up to 2.5MB Operation - Pin Compatible with ±60V Protected LTC2862 Revision Date changed by Changes ------------------------------------------------------------------------------------------ V1.0 14.12.2015 SC Ersterstellung; DISTRI_1: Farnell; DISTRI_1-NR: 9561331; DISTRI_1-PREIS: 1,85€; DISTRI_2: Digi-Key; DISTRI_2-NR: LTC485CS8#TRPBFCT-ND; DISTRI_2-PREIS: 3,66€; HERSTELLER: Linear Technologies; HERSTELLER-NR: LTC485CS8#PBF; MARKING: 485; PDF-LOCAL: file:///C:\Eagle-Datasheet\Schnittstellen-IC\LTC485_Linear.pdf; SIZE: SOIC-8; UKAT: C; UTERM: Sn; UTMAX: 70°C; UTMIN: 0°C; UTYP: RS485 Transceiver; UVAL: LTC485CS8#PBF; UVCC_MAX: 5,25V; UVCC_MIN: 4,75V
IC1303 = 0_LES_SCHNITTSTELLEN-IC.SMD.ISOLATOR:ADUM1401: ADUM1401 - Analog Devices Datasheet www <http://www.analog.com/media/en/technical-documentation/data-sheets/ADuM1400_1401_1402.pdf> Datasheet local <file:///C:\Eagle-Datasheet\Schnittstellen-IC\ADuM1400_1401_1402_Linear.pdf> Quad-Channel Digital Isolator - Qualified for automotive applications - Low power operation - 5 V operation: - 1.0 mA per channel maximum at 0 Mbps to 2 Mbps - 3.5 mA per channel maximum at 10 Mbps - 31 mA per channel maximum at 90 Mbps - 3 V operation: - 0.7 mA per channel maximum at 0 Mbps to 2 Mbps - 2.1 mA per channel maximum at 10 Mbps - 20 mA per channel maximum at 90 Mbps - Bidirectional communication - 3 V/5 V level translation - High temperature operation: 125°C - High data rate: dc to 90 Mbps (NRZ) - Precise timing characteristics: - 2 ns maximum pulse width distortion - 2 ns maximum channel-to-channel matching - High common-mode transient immunity: >25 kV/μs - Output enable function - 16-lead SOIC wide body package Revision Date changed by Changes ------------------------------------------------------------------------------------------ V1.0 28.10.2015 SC Ersterstellung; DISTRI_1: Digi-Key; DISTRI_1-NR: ADUM1401ARW-ND; DISTRI_1-PREIS: 5,08€; DISTRI_2: Mouser; DISTRI_2-NR: 584-ADUM1401ARW; DISTRI_2-PREIS: 3,92€; HERSTELLER: Analog Devices; HERSTELLER-NR: ADUM1401ARW; MARKING: ADUM1401ARW; PDF-LOCAL: file:///C:\Eagle-Datasheet\Schnittstellen-IC\ADuM1400_1401_1402_Linear.pdf; SIZE: SOIC-16; UDR: 1,00Mbps; UDT: 100ns; UKAT: I; UPWV: 40,0ns; UTERM: Sn; UTMAX: 105°C; UTMIN: -40°C; UTYP: Digital Isolator; UVAL: ADUM1401ARW; UVDD_MAX: 5,50V; UVDD_MIN: 2,70V
IC1701 = 0_LES_VREF.SMD.SERIELL:ADR34*: ADR34xx Serie - Analog Devices Datasheet www <http://www.analog.com/media/en/technical-documentation/data-sheets/ADR3412_ADR3420_ADR3425_ADR3430_ADR3433_ADR3440_ADR3450.pdf> Datasheet local <file:///C:\Eagle-Datasheet\Referenzen\ADR3412_ADR3420_ADR3425_ADR3430_ADR3433_ADR3440_ADR3450_Analog_Devices.pdf> Micro-Power, High-Accuracy Voltage Reference - Initial accuracy: ±0.1% (maximum) - Maximum temperature coefficient: 8 ppm/°C - Operating temperature range: −40°C to +125°C - Output current: +10 mA source/−3 mA sink - Low quiescent current: 100 μA (maximum) - Low dropout voltage: 250 mV at 2 mA - Output noise (0.1 Hz to 10 Hz): <10 μV p-p at 1.2 V (typical) - 6-lead SOT-23 package - SOT23-6 Surface-Mounted Device (SMD) plastic package Revision Date changed by Changes ------------------------------------------------------------------------------------------ V1.0 10.12.2015 SC Ersterstellung; DISTRI_1: Farnell; DISTRI_1-NR: 2377039; DISTRI_1-PREIS: 1,91€; DISTRI_2: Mouser; DISTRI_2-NR: 584-ADR3425ARJZ-R7; DISTRI_2-PREIS: 2,34€; HERSTELLER: Analog Devices; HERSTELLER-NR: ADR3425ARJZ-R7; MARKING: R2X; PDF-LOCAL: file:///C:\Eagle-Datasheet\Referenzen\ADR3412_ADR3420_ADR3425_ADR3430_ADR3433_ADR3440_ADR3450_Analog_Devices.pdf; SIZE: SOT23-6; UKAT: I; UTERM: Sn; UTMAX: 125°C; UTMIN: -40°C; UTYP: V-REF; UVAL: ADR3425ARJZ-R7
IC1902 IC1903 = 0_LES_SCHNITTSTELLEN-IC.SMD.ISOLATOR:ADUM1402: ADUM1402 - Analog Devices Datasheet www <http://www.analog.com/media/en/technical-documentation/data-sheets/ADuM1400_1401_1402.pdf> Datasheet local <file:///C:\Eagle-Datasheet\Schnittstellen-IC\ADuM1400_1401_1402_Linear.pdf> Quad-Channel Digital Isolator - Qualified for automotive applications - Low power operation - 5 V operation: - 1.0 mA per channel maximum at 0 Mbps to 2 Mbps - 3.5 mA per channel maximum at 10 Mbps - 31 mA per channel maximum at 90 Mbps - 3 V operation: - 0.7 mA per channel maximum at 0 Mbps to 2 Mbps - 2.1 mA per channel maximum at 10 Mbps - 20 mA per channel maximum at 90 Mbps - Bidirectional communication - 3 V/5 V level translation - High temperature operation: 125°C - High data rate: dc to 90 Mbps (NRZ) - Precise timing characteristics: - 2 ns maximum pulse width distortion - 2 ns maximum channel-to-channel matching - High common-mode transient immunity: >25 kV/μs - Output enable function - 16-lead SOIC wide body package Revision Date changed by Changes ------------------------------------------------------------------------------------------ V1.0 28.10.2015 SC Ersterstellung; DISTRI_1: Digi-Key; DISTRI_1-NR: ADUM1402ARW-ND; DISTRI_1-PREIS: 5,08€; DISTRI_2: Mouser; DISTRI_2-NR: 584-ADUM1402ARW; DISTRI_2-PREIS: 3,92€; HERSTELLER: Analog Devices; HERSTELLER-NR: ADUM1402ARW; MARKING: ADUM1402ARW; PDF-LOCAL: file:///C:\Eagle-Datasheet\Schnittstellen-IC\ADuM1400_1401_1402_Linear.pdf; SIZE: SOIC-16; UDR: 1,00Mbps; UDT: 100ns; UKAT: I; UPWV: 40,0ns; UTERM: Sn; UTMAX: 105°C; UTMIN: -40°C; UTYP: Digital Isolator; UVAL: ADUM1402ARW; UVDD_MAX: 5,50V; UVDD_MIN: 2,70V
IC2001-IC2006 = foxBMS_custom:AQV25G2S
JP2201 JP2202 = pinhead:PINHD-2X12: PIN HEADER
L801 = 0_LES_INDUKTIVITAET.SMD.FILTER.HF:B82789: B82789C0/S0 - Serie - Epcos Datasheet www <http://de.tdk.eu/inf/30/db/ind_2008/b82789c0_s0.pdf> Datasheet local <file:///C:\Eagle-Datasheet\Induktivitaet\B82789C0_EPCOS.pdf> B82789C0/S0 - Serie - Epcos - Stromkompensierte Drosseln für CANBUS - Bauform:1812 - Betriebstemperatur: –50ºC bis +125ºC/+155°C - Betriebsspannung: 80 VDC (42 VAC) - Empfohlenes Lötverfahren: Reflow Revision Date changed by Changes ------------------------------------------------------------------------------------------ V1.0 26.10.2015 SC Ersterstellung; DISTRI_1: Mouser; DISTRI_1-NR: 871-B82789C0513N002; DISTRI_1-PREIS: 2,02€; HERSTELLER: EPCOS; HERSTELLER-NR: B82789C0513N002; MARKING: B82789C0/S0; PDF-LOCAL: file:///C:\Eagle-Datasheet\Induktivitaet\B82789C0_EPCOS.pdf; SIZE: 1812; UIR_MAX: 250mA; UKAT: I; ULS: 2x51,0uH; URDC: 2x550mOhm; UTERM: Sn; UTMAX: 125°C; UTMIN: -55°C; UTOL: 30%; UTYP: Data And Signal Line Chokes; UVAC: 42.0V; UVAL: 2x51,0uH; UVCC_MAX: 250V (DC); UVDC: 80.0V
L1501 = custom_passiv:L*: einfache Induktivität 0402: #2763 1206: #641 1210: #609 HT_SIMID_1210: #2161 SIMID_1210: #355 H1210: #631 H_SIMID1210: #473 2220: #457 H_2220: #467 _N05DB: #515 _NP05DB: #779 _330/EH: #1196 _B166: #653 _B179: #655 _BC: #603 _BC0824: #619 _BC0826: #615 _LBC: #607 _WE-FI_22MYH: #623 _WE-FI_1.8MYH: #611 _WE-FI_10MYH: #613 _BLM11A102S: #2063 _BLM11A121S: #2079 WE_PD4_X: #44 DR127: #514 _WE_744318180: #520
LSP801-LSP807 LSP901 LSP1001-LSP1003 LSP1101-LSP1103 LSP1301-LSP1304 LSP1501-LSP1505 LSP1701-LSP1705 LSP1901-LSP1908 LSP2001-LSP2006 LSP2101 LSP2102 = custom_pad:PAD_: Testpunkte mit und ohne Durchkontaktierung in ver. Größen Nicomatic SMD-Testpunkt
R801-R806 R901 R902 R1001-R1009 R1101-R1106 R1501-R1507 R1701-R1710 R1901-R1908 R2001-R2018 = custom_passiv:R*: Widerstand: Bitte gleich beim Einfügen vorgesehenen Werkstoff wählen. 0R_0402: #2765 0R_0603: #2227 0R_0805: #2229 Met_0402: #2767 Met_0603: #801 Met_0805: #1095 Met_1206: #1389 Met_MINIMELF: #1683 MET_E96_0402: #2769 MET_E96_0603: #5 MET_E96_0805: #1230 MET_E96_1206: #286 MET_E96_MICROMELF: #1979 MET_E96_MINIMELF: #536
SLOT1501 = 0_LES_STECKVERBINDUNG.SMD.SPECIAL:MICRO_SD: Micro-SD-BUCHSE - Molex Datasheet www <http://www.molex.com/pdm_docs/sd/473521001_sd.pdf> Datasheet local <file:///C:\Eagle-Datasheet\Steckverbindung\473521001_SD_Molex.pdf> Micro-Sd-Buchse - 8-PIN Micro-SD - liegend - Package Revision Date changed by Changes ------------------------------------------------------------------------------------------ V1.0 08.01.2016 SC Ersterstellung; DISTRI_1: Farnell; DISTRI_1-NR: 2424133; DISTRI_1-PREIS: 1,43€; HERSTELLER: MOLEX; HERSTELLER-NR: 4735-21001; MARKING: -; PDF-LOCAL: file:///C:\Eagle-Datasheet\Steckverbindung\473521001_SD_Molex.pdf; SIZE: 15,20mm x 14,00mm x 1,88mm; UIB: 0,50A; UKAT: I; UTERM: Sn; UTMAX: 85°C; UTMIN: -20°C; UTYP: Memory Card Socket; UVAL: 4735-21001; UVB: 100V
SV901 SV2101 = con-lstb:MA04-2: PIN HEADER; OC_FARNELL: unknown; OC_NEWARK: unknown
T801 T1001-T1003 T2001-T2006 = 0_LES_TRANSISTOR.SMD.MOS.N-KANAL.NO:IR?*: IR-Serie - International Rectifier IRFH5406TRPBF: Datasheet www <http://www.irf.com/product-info/datasheets/data/irfh5406pbf.pdf> Datasheet local <file:///C:\Eagle-Datasheet\Transistoren\IRFH5406PBF_International_Rectifier.pdf> IRLML0100TRPBF: Datasheet www <http://www.irf.com/product-info/datasheets/data/irlml0100pbf-1.pdf> Datasheet local <file:///C:\Eagle-Datasheet\Transistoren\IRLML0100PBF-1_IR.pdf> HEXFET Power MOSFETs Revision Date changed by Changes ------------------------------------------------------------------------------------------ V1.0 01.01.2014 SC Erst. IRFH5406PBF V1.0 16.12.2015 SC Erst. IRLML0100TRPBF; DISTRI_1: Farnell; DISTRI_1-NR: 1783928; DISTRI_1-PREIS: 0,144€; DISTRI_2: Mouser; DISTRI_2-NR: 942-IRLML0100TRPBF; DISTRI_2-PREIS: 0,495€; HERSTELLER: International Rectifier; HERSTELLER-NR: IRLML0100TRPBF; MARKING: K; PDF-LOCAL: file:///C:\Eagle-Datasheet\Transistoren\IRLML0100PBF-1_IR.pdf; SIZE: SOT-23; UID: 1,60A; UTERM: Sn; UTMAX: 150°C; UTMIN: -55°C; UTYP: N-Channel MOSFET; UVAL: IRLML0100TRPBF; UVDS: 100V
T901 = 0_LES_TRANSISTOR.SMD.MOS.N-KANAL.NO:BUK?*: BUK9-Serie - Fairchild Semiconductor Datasheet www <http://cache.nxp.com/documents/data_sheet/BUK964R8-60E.pdf> Datasheet local <file:///C:\Eagle-Datasheet\Transistoren\BUK964R8-60E_NXP.pdf> N-Channel Trench MOSFET - 3-Pin TO-263 /... Package - AEC Q101 compliant - Repetitive avalanche rated - Suitable for thermally demanding environments due to 175 °C rating - True logic level gate with VGS(th) rating of greater than 0.5V at 175 °C - 12 V Automotive systems - Motors, lamps and solenoid control - Start-Stop micro-hybrid applications - Transmission control - Ultra high performance power switching Revision Date changed by Changes ------------------------------------------------------------------------------------------ V1.0 15.12.2015 SC Ersterstellung; DISTRI_1: Farnell; DISTRI_1-NR: 2254205; DISTRI_1-PREIS: 0,968€; DISTRI_2: Digi-Key; DISTRI_2-NR: 568-9890-1-ND; DISTRI_2-PREIS: 1,86€; HERSTELLER: NXP; HERSTELLER-NR: BUK964R8-60E; MARKING: BUK964R8-60E; PDF-LOCAL: file:///C:\Eagle-Datasheet\Transistoren\BUK964R8-60E_NXP.pdf; SIZE: TO-263; UKAT: A; UPV: 234W; UTERM: Sn; UTMAX: 175°C; UTMIN: -55°C; UTYP: MOS N-Channel; UVAL: BUK964R8-60E; UVDSS: 60,0V; UVGSS: 5,00V
T1501 = 0_LES_TRANSISTOR.SMD.MOS.P-KANAL.NO:BSS84P: BSS84P - Infineon Datasheet www <http://www.infineon.com/dgdl/Infineon-BSS84P-DS-v02_07-en.pdf?fileId=db3a304330f68606013118ac7a9b4549> Datasheet local <file:///C:\Eagle-Datasheet\Transistoren\BSS84P_Infineon.pdf> P-Kanal MOSFET - P-Channel - Enhancement mode - Logic Level - Avalanche rated - dv/dt rated - SOT23 (TO-236AB) Surface-Mounted Device (SMD) plastic package Revision Date changed by Changes ------------------------------------------------------------------------------------------ V1.0 01.01.2014 SC Ersterstellung; DISTRI_1: Farnell; DISTRI_1-NR: 1056526; DISTRI_1-PREIS: 0,06€; DISTRI_2: Mouser; DISTRI_2-NR: 726-BSS84PH6327; DISTRI_2-PREIS: 0,576€; HERSTELLER: Infineon; HERSTELLER-NR: BSS84P; MARKING: YBs; PDF-LOCAL: file:///C:\Eagle-Datasheet\Transistoren\BSS84P_Infineon.pdf; SIZE: SOT-23; UID: -170mA; URDS: 8,00Ohm; UTERM: Sn; UTMAX: 155°C; UTMIN: -55°C; UTYP: MOSFET; UVAL: BSS84P; UVDS: -60,0V; UVGS: 20,0V
X801 X1201-X1203 = 0_LES_STECKVERBINDUNG.TH.RASTER_3,00MM.BUCHSE:43045-04?*_MOLEX_4PIN: 43045-Serie - MOLEX 43045-0400 Datasheet www <http://www.molex.com/webdocs/datasheets/pdf/en-us/0430450400_PCB_HEADERS.pdf> Datasheet local <file:///C:\Eagle-Datasheet\Steckverbindung\430450400_Molex.pdf> 43045-0401 Datasheet www <http://www.molex.com/webdocs/datasheets/pdf/en-us/0430450401_PCB_HEADERS.pdf> Datasheet local <file:///C:\Eagle-Datasheet\Steckverbindung\430450401_Molex.pdf> 43045-0402 Datasheet www <http://www.molex.com/webdocs/datasheets/pdf/en-us/0430450402_PCB_HEADERS.pdf> Datasheet local <file:///C:\Eagle-Datasheet\Steckverbindung\430450402_Molex.pdf> - 4-Pin Buchse - liegend - Package - 2 reihig x 2-Pins - Size: 12,24mm x 9,65mm x 10,29mm - RM: 3,00mm - Farbe: Schwarz - Material: High Temperature Thermoplastic Revision Date changed by Changes ------------------------------------------------------------------------------------------ V1.0 20.04.2016 SC Ersterstellung; DISTRI_1: Farnell; DISTRI_1-NR: 43045-0400; DISTRI_1-PREIS: 0,799€; DISTRI_2: Mouser; DISTRI_2-NR: 538-43045-0400; DISTRI_2-PREIS: 1,19€; HERSTELLER: Molex; HERSTELLER-NR: 43045-0400; PDF-LOCAL: file:///C:\Eagle-Datasheet\Steckverbindung\430450400_Molex.pdf; SIZE: 12,24mm x 9,65mm x 10,29mm; UCOLOR: Schwarz; UIN_MAX: 5,00A; UKAT: C; UMAT: High Temperature Thermoplastic; URISO: 1,00GOhm; UTERM: Sn; UTERMPLAT: 254nm; UTMAX: 105°C; UTMIN: -40°C; UTYP: Buchse; UVAL: 43045-0400; UVCC_MAX: 600V
X1301 = 0_LES_STECKVERBINDUNG.TH.RASTER_3,00MM.BUCHSE:43045-06?*_MOLEX_6PIN: 43045-Serie - MOLEX 43045-0600 Datasheet www <http://www.molex.com/webdocs/datasheets/pdf/en-us/0430450600_PCB_HEADERS.pdf> Datasheet local <file:///C:\Eagle-Datasheet\Steckverbindung\430450600_Molex.pdf> 43045-0601 Datasheet www <http://www.molex.com/webdocs/datasheets/pdf/en-us/0430450601_PCB_HEADERS.pdf> Datasheet local <file:///C:\Eagle-Datasheet\Steckverbindung\430450601_Molex.pdf> 43045-0602 Datasheet www <http://www.molex.com/webdocs/datasheets/pdf/en-us/0430450602_PCB_HEADERS.pdf> Datasheet local <file:///C:\Eagle-Datasheet\Steckverbindung\430450602_Molex.pdf> - 6-Pin Buchse - liegend - Package - 2 reihig x 3-Pins - Size: 12,24mm x 12,65mm x 10,29mm - RM: 3,00mm - Farbe: Schwarz - Material: High Temperature Thermoplastic Revision Date changed by Changes ------------------------------------------------------------------------------------------ V1.0 20.04.2016 SC Ersterstellung; HERSTELLER: Molex; HERSTELLER-NR: 43045-0600; PDF-LOCAL: file:///C:\Eagle-Datasheet\Steckverbindung\430450600_Molex.pdf; SIZE: 12,24mm x 12,65mm x 10,29mm; UCOLOR: Schwarz; UIN_MAX: 5,00A; UKAT: C; UMAT: High Temperature Thermoplastic; URISO: 1,00GOhm; UTERM: Sn; UTERMPLAT: 254nm; UTMAX: 105°C; UTMIN: -40°C; UTYP: Buchse; UVAL: 43045-0600; UVCC_MAX: 600V
X1701 X2001 = 0_LES_STECKVERBINDUNG.TH.RASTER_3,00MM.BUCHSE:43045-12?*_MOLEX_12PIN: 43045-Serie - MOLEX 43045-1200 Datasheet www <http://www.molex.com/webdocs/datasheets/pdf/en-us/0430451200_PCB_HEADERS.pdf> Datasheet local <file:///C:\Eagle-Datasheet\Steckverbindung\430451200_Molex.pdf> 43045-1201 Datasheet www <http://www.molex.com/webdocs/datasheets/pdf/en-us/0430451201_PCB_HEADERS.pdf> Datasheet local <file:///C:\Eagle-Datasheet\Steckverbindung\430451201_Molex.pdf> 43045-1202 Datasheet www <http://www.molex.com/webdocs/datasheets/pdf/en-us/0430451202_PCB_HEADERS.pdf> Datasheet local <file:///C:\Eagle-Datasheet\Steckverbindung\430451202_Molex.pdf> - 12-Pin Buchse - liegend - Package - 2 reihig x 6-Pins - Size: 12,24mm x 21,65mm x 10,29mm - RM: 3,00mm - Farbe: Schwarz - Material: High Temperature Thermoplastic Revision Date changed by Changes ------------------------------------------------------------------------------------------ V1.0 20.04.2016 SC Ersterstellung; HERSTELLER: Molex; HERSTELLER-NR: 43045-1200; PDF-LOCAL: file:///C:\Eagle-Datasheet\Steckverbindung\430451200_Molex.pdf; SIZE: 12,24mm x 21,65mm x 10,29mm; UCOLOR: Schwarz; UIN_MAX: 5,00A; UKAT: C; UMAT: High Temperature Thermoplastic; URISO: 1,00GOhm; UTERM: Sn; UTERMPLAT: 254nm; UTMAX: 105°C; UTMIN: -40°C; UTYP: Buchse; UVAL: 43045-1200; UVCC_MAX: 600V
X1901 = 0_LES_STECKVERBINDUNG.TH.RASTER_3,00MM.BUCHSE:43045-10?*_MOLEX_10PIN: 43045-Serie - MOLEX 43045-1000 Datasheet www <http://www.molex.com/webdocs/datasheets/pdf/en-us/0430451000_PCB_HEADERS.pdf> Datasheet local <file:///C:\Eagle-Datasheet\Steckverbindung\430451000_Molex.pdf> 43045-1001 Datasheet www <http://www.molex.com/webdocs/datasheets/pdf/en-us/0430451001_PCB_HEADERS.pdf> Datasheet local <file:///C:\Eagle-Datasheet\Steckverbindung\430451001_Molex.pdf> 43045-1002 Datasheet www <http://www.molex.com/webdocs/datasheets/pdf/en-us/0430451002_PCB_HEADERS.pdf> Datasheet local <file:///C:\Eagle-Datasheet\Steckverbindung\430451002_Molex.pdf> - 10-Pin Buchse - liegend - Package - 2 reihig x 5-Pins - Size: 12,24mm x 18,65mm x 10,29mm - RM: 3,00mm - Farbe: Schwarz - Material: High Temperature Thermoplastic Revision Date changed by Changes ------------------------------------------------------------------------------------------ V1.0 20.04.2016 SC Ersterstellung; HERSTELLER: Molex; HERSTELLER-NR: 43045-1000; PDF-LOCAL: file:///C:\Eagle-Datasheet\Steckverbindung\430451000_Molex.pdf; SIZE: 12,24mm x 18,65mm x 10,29mm; UCOLOR: Schwarz; UIN_MAX: 5,00A; UKAT: C; UMAT: High Temperature Thermoplastic; URISO: 1,00GOhm; UTERM: Sn; UTERMPLAT: 254nm; UTMAX: 105°C; UTMIN: -40°C; UTYP: Buchse; UVAL: 43045-1000; UVCC_MAX: 600V

## Net classes
0 default: width 0.152 mm, clearance 0.152 mm
1 controller: width 0.152 mm, clearance 0.152 mm to class 0, clearance 0.152 mm
3 USB: width 0.152 mm, clearance 0.203 mm to class 0, clearance 0.203 mm to class 1, clearance 0.203 mm to class 2, clearance 0.152 mm
4 Power: width 0.305 mm, clearance 0.152 mm to class 0, clearance 0.152 mm to class 1, clearance 0.152 mm to class 2, clearance 0.508 mm to class 3, clearance 0.152 mm